# EAGLE design Tractive System Board Rev9 (EAGLE 9.6.2)

## Sheet 1 of 3
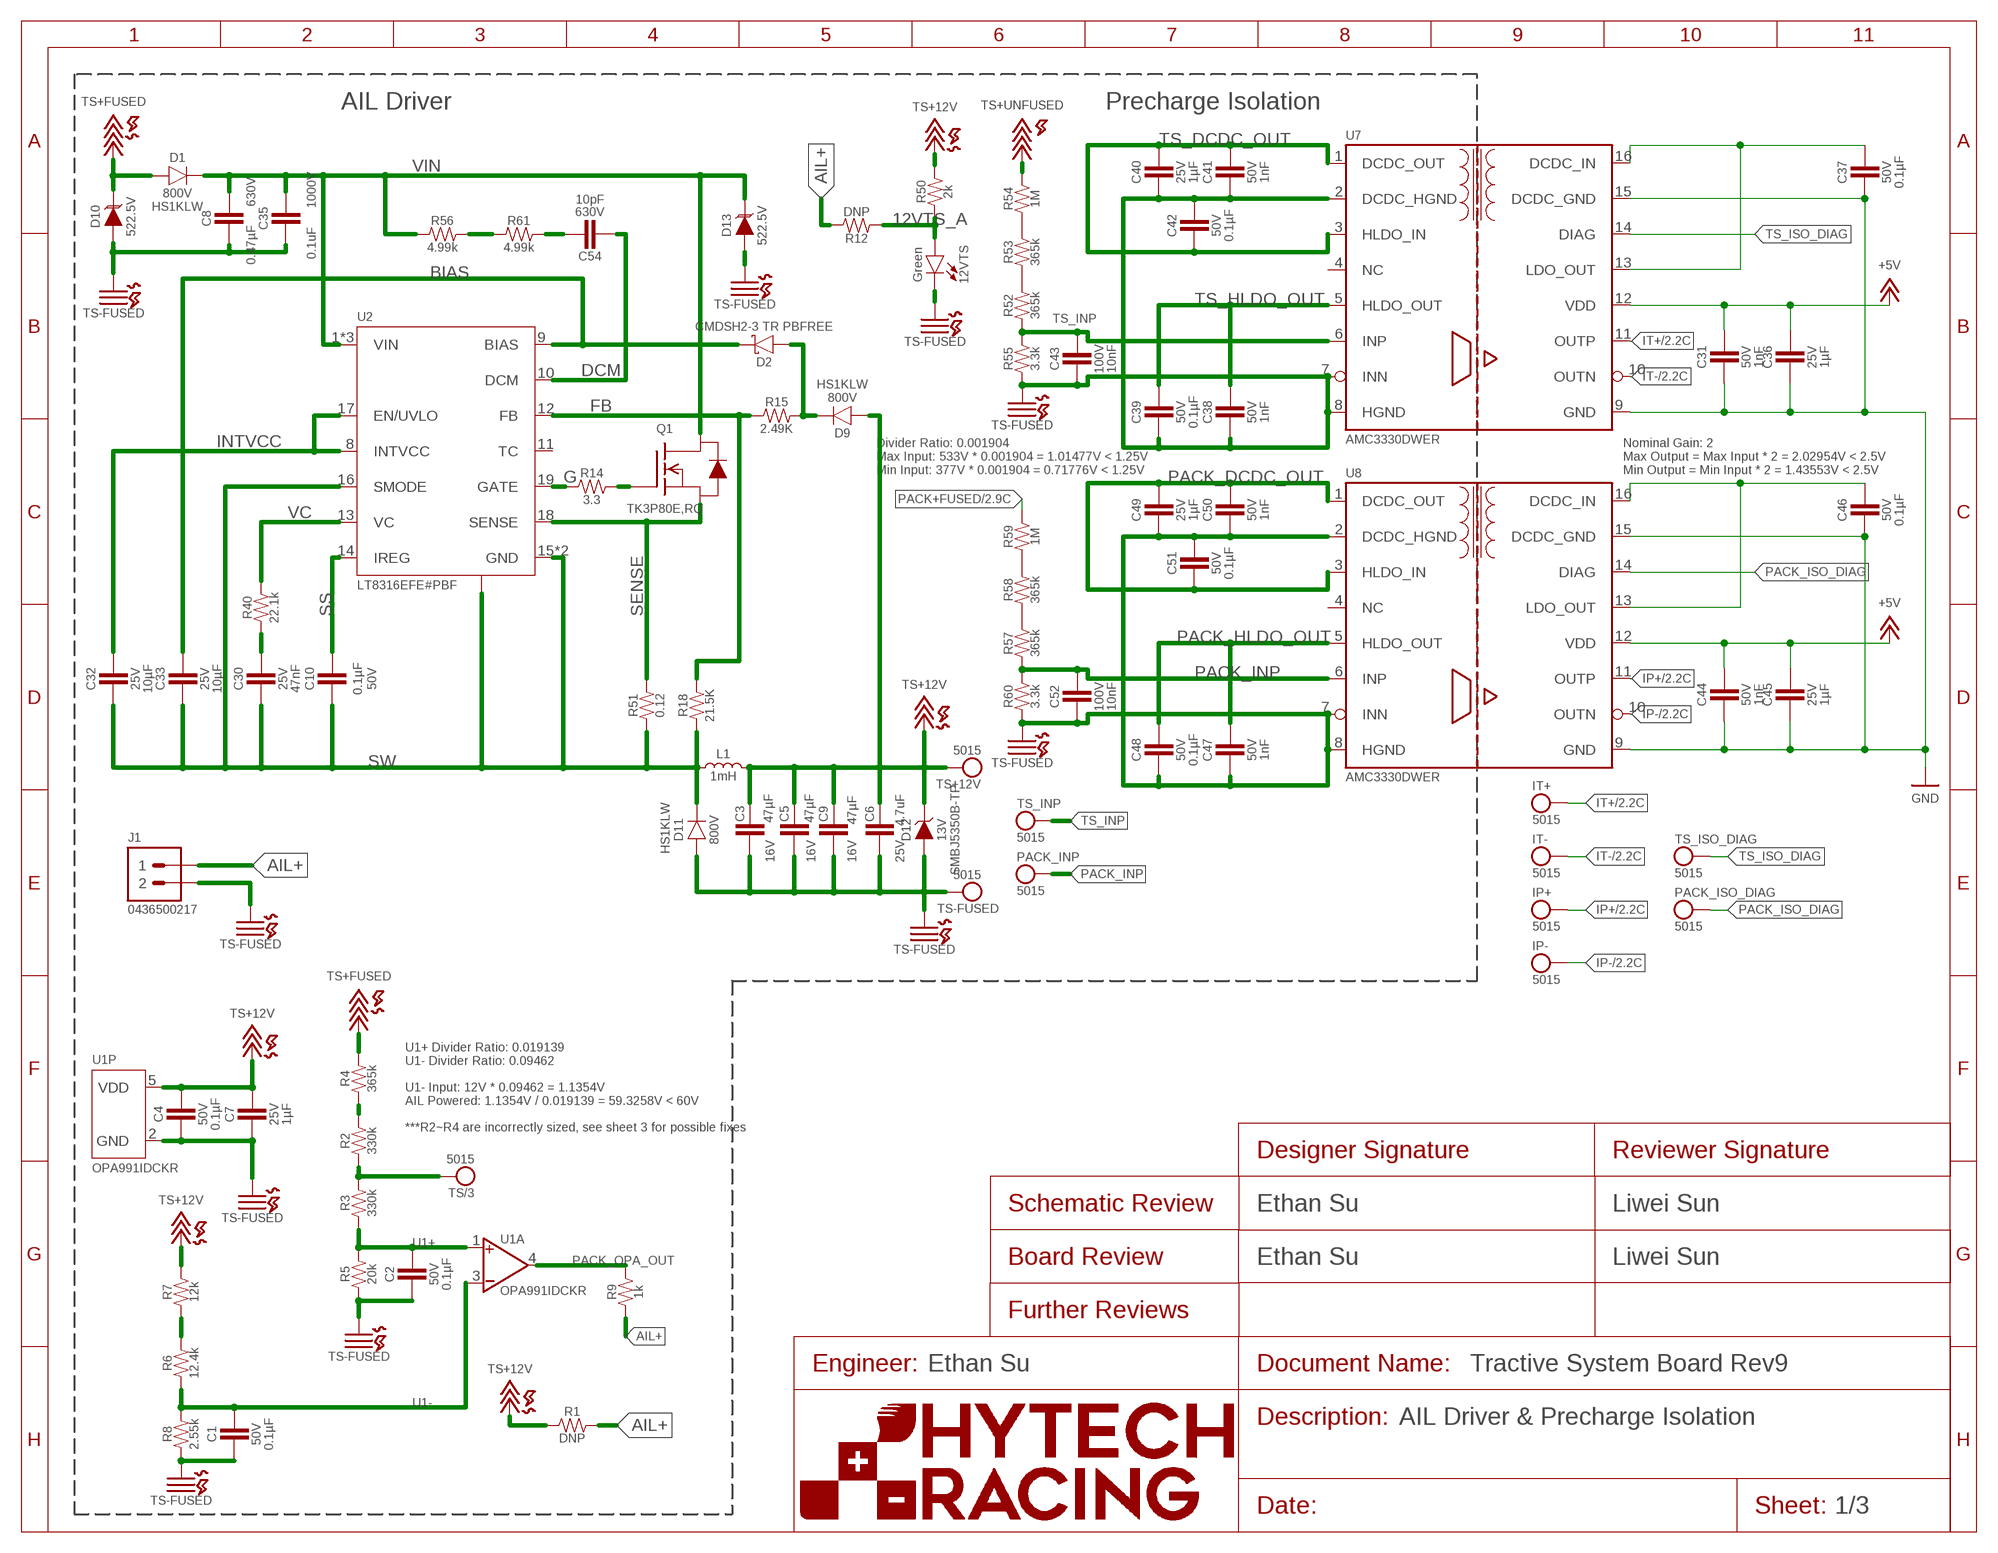
[diagram p0: schematic, sheet 1]
FRAME1 (FRAME): DESCRIPTION_1: AIL Driver & Precharge Isolation; DESIGNER_BOARD: Ethan Su; DESIGNER_SCHEMATIC: Ethan Su; ENGINEER: Ethan Su; REVIEWER_BOARD: Liwei Sun; REVIEWER_SCHEMATIC: Liwei Sun

### Parts
12VTS  LED_0603_GREEN  [0603-LED]
C1  CAPACITOR_0603_50V_0.1UF  [0603-CAP]
C2  CAPACITOR_0603_50V_0.1UF  [0603-CAP]
C3  CAPACITOR_1206_16V_47UF  [1206-CAP]
C4  CAPACITOR_0603_50V_0.1UF  [0603-CAP]
C5  CAPACITOR_1206_16V_47UF  [1206-CAP]
C6  CAPACITOR_0603_25V_4.7UF  [0603-CAP]
C7  CAPACITOR_0603_25V_1UF  [0603-CAP]
C8  CAPACITOR_2220_630V_0.47UF  [2220-CAP]
C9  CAPACITOR_1206_16V_47UF  [1206-CAP]
C10  CAPACITOR_0603_50V_0.1UF  [0603-CAP]
C30  CAPACITOR_0603_25V_47NF  [0603-CAP]
C31  CAPACITOR_1206_50V_1NF  [1206-CAP]
C32  CAPACITOR_0603_25V_10UF  [0603-CAP]
C33  CAPACITOR_0603_25V_10UF  [0603-CAP]
C35  CAPACITOR_1812_1000V_0.1UF  [1812-CAP]
C36  CAPACITOR_1206_25V_1UF  [1206-CAP]
C37  CAPACITOR_0603_50V_0.1UF  [0603-CAP]
C38  CAPACITOR_1206_50V_1NF  [1206-CAP]
C39  CAPACITOR_1206_50V_0.1UF  [1206-CAP]
C40  CAPACITOR_0603_25V_1UF  [0603-CAP]
C41  CAPACITOR_0603_50V_1NF  [0603-CAP]
C42  CAPACITOR_0603_50V_0.1UF  [0603-CAP]
C43  CAPACITOR_0603_100V_10NF  [0603-CAP]
C44  CAPACITOR_1206_50V_1NF  [1206-CAP]
C45  CAPACITOR_1206_25V_1UF  [1206-CAP]
C46  CAPACITOR_0603_50V_0.1UF  [0603-CAP]
C47  CAPACITOR_1206_50V_1NF  [1206-CAP]
C48  CAPACITOR_1206_50V_0.1UF  [1206-CAP]
C49  CAPACITOR_0603_25V_1UF  [0603-CAP]
C50  CAPACITOR_0603_50V_1NF  [0603-CAP]
C51  CAPACITOR_0603_50V_0.1UF  [0603-CAP]
C52  CAPACITOR_0603_100V_10NF  [0603-CAP]
C54  CAPACITOR_1206_630V_10PF  [1206-CAP]
D1  RECTIFIER_800V_ACTIVE_SOD-123W  [SOD-123W]
D2  SCHOTTKY_SOD323_30VV  [SOD-323]
D9  RECTIFIER_800V_ACTIVE_SOD-123W  [SOD-123W]
D10  TVS_TPSMB_522.5  [SMB(DO-214AA)]
D11  RECTIFIER_800V_ACTIVE_SOD-123W  [SOD-123W]
D12  ZENER_SMB(DO-214AA)_13V  [SMB(DO-214AA)]
D13  TVS_TPSMB_522.5  [SMB(DO-214AA)]
IP+  TEST_POINT  [5015]
IP-  TEST_POINT  [5015]
IT+  TEST_POINT  [5015]
IT-  TEST_POINT  [5015]
J1  CONNECTOR-2_MICROFIT_PTH_VERTICAL_02_SINGLE_  [MOLEX_MICROFIT_PTH_VERTICAL_02_SINGLE]
L1  INDUCTOR_CDEEH13D90-102LC_1MH  [CDEEH13D90]
PACK_INP  TEST_POINT  [5015]
PACK_ISO_DIAG  TEST_POINT  [5015]
Q1  TRANSISTOR_N_MOS_2-7K1S_TK3P80E  [DPAK(2-7K1S)]
R1  RESISTOR_0603_DNP  [0603-RES]
R2  RESISTOR_0603_330K  [0603-RES]
R3  RESISTOR_0603_330K  [0603-RES]
R4  RESISTOR_0805_365K  [0805-RES]
R5  RESISTOR_0603_20K  [0603-RES]
R6  RESISTOR_0603_12.4K  [0603-RES]
R7  RESISTOR_0603_12K  [0603-RES]
R8  RESISTOR_0603_2.55K  [0603-RES]
R9  RESISTOR_0603_1K  [0603-RES]
R12  RESISTOR_0603_DNP  [0603-RES]
R14  RESISTOR_0603_3.3  [0603-RES]
R15  RESISTOR_0603_2.49K  [0603-RES]
R18  RESISTOR_0603_21.5K  [0603-RES]
R40  RESISTOR_0603_22.1K  [0603-RES]
R50  RESISTOR_0603_2K  [0603-RES]
R51  RESISTOR_0603_0.12  [0603-RES]
R52  RESISTOR_0805_HV365K  [0805-RES]
R53  RESISTOR_0805_HV365K  [0805-RES]
R54  RESISTOR_0805_HV1M  [0805-RES]
R55  RESISTOR_0603_HV3.3K  [0603-RES]
R56  RESISTOR_1206_HV4.99K  [1206-RES]
R57  RESISTOR_0805_HV365K  [0805-RES]
R58  RESISTOR_0805_HV365K  [0805-RES]
R59  RESISTOR_0805_HV1M  [0805-RES]
R60  RESISTOR_0603_HV3.3K  [0603-RES]
R61  RESISTOR_1206_HV4.99K  [1206-RES]
TS+12V  TEST_POINT  [5015]
TS-FUSED  TEST_POINT  [5015]
TS/3  TEST_POINT  [5015]
TS_INP  TEST_POINT  [5015]
TS_ISO_DIAG  TEST_POINT  [5015]
U1  OPAMP_1_CHANNEL_OPA991  [SC-70-5]
U2  LT8316  [TSSOP-20(16)]
U7  AMC3330_AIRGAP  [SOIC-16W-AIRGAP]
U8  AMC3330_AIRGAP  [SOIC-16W-AIRGAP]

### Nets
12VTS_A: 12VTS.2(A) R12.1 R50.1
+5V: C31.1 C36.1 C44.1 C45.1 U7.12(VDD) U8.12(VDD) ; also sheet 2
AIL+: J1.1 R1.2 R9.1 R12.2
BIAS: C33.1 D2.C U2.9(BIAS)
DCM: C54.2 U2.10(DCM)
FB: R15.1 R18.2 U2.12(FB)
G: R14.1 U2.19(GATE)
GND: C31.2 C36.2 C37.2 C44.2 C45.2 C46.2 U7.9(GND) U7.15(DCDC_GND) U8.9(GND) U8.15(DCDC_GND) ; also sheet 2
INTVCC: C32.1 U2.8(INTVCC) U2.17(EN/UVLO)
IP+: IP+.1 U8.11(OUTP) ; also sheet 2
IP-: IP-.1 U8.10(OUTN) ; also sheet 2
IT+: IT+.1 U7.11(OUTP) ; also sheet 2
IT-: IT-.1 U7.10(OUTN) ; also sheet 2
N$1: Q1.1(G) R14.2
N$4: D2.A D9.C R15.2
N$5: R2.1 R3.2 TS/3.1
N$6: R2.2 R4.1
N$12: R6.2 R7.1
N$17: R56.2 R61.1
N$18: C54.1 R61.2
N$33: C37.1 U7.13(LDO_OUT) U7.16(DCDC_IN)
N$43: C30.1 R40.1
N$52: C46.1 U8.13(LDO_OUT) U8.16(DCDC_IN)
N$59: R52.2 R53.1
N$60: R53.2 R54.1
N$65: R57.2 R58.1
N$66: R58.2 R59.1
PACK+FUSED: R59.2 ; also sheet 2
PACK_DCDC_OUT: C49.1 C50.1 C51.2 U8.1(DCDC_OUT) U8.3(HLDO_IN)
PACK_HLDO_OUT: C47.1 C48.1 U8.5(HLDO_OUT)
PACK_INP: C52.1 PACK_INP.1 R57.1 R60.2 U8.6(INP)
PACK_ISO_DIAG: PACK_ISO_DIAG.1 U8.14(DIAG)
PACK_OPA_OUT: R9.2 U1.4(A:VOUT)
SENSE: Q1.3(S) R51.2 U2.18(SENSE)
SS: C10.1 U2.14(IREG)
SW: C10.2 C30.2 C32.2 C33.2 D11.C L1.1 R18.1 R51.1 U2.15(GND) U2.16(SMODE) U2.20(GND) U2.THERMAL
TS+12V: C3.1 C4.1 C5.1 C6.1 C7.1 C9.1 D9.A D12.C L1.2 R1.1 R7.2 R50.2 TS+12V.1 U1.5(P:VDD)
TS+FUSED: D1.A D10.C R4.2 ; also sheet 2
TS+UNFUSED: R54.2 ; also sheet 2
TS-FUSED: 12VTS.1(C) C1.2 C2.2 C3.2 C4.2 C5.2 C6.2 C7.2 C8.2 C9.2 C35.2 C38.2 C39.2 C40.2 C41.2 C42.1 C43.2 C47.2 C48.2 C49.2 C50.2 C51.1 C52.2 D10.A D11.A D12.A D13.A J1.2 R5.1 R8.1 R55.1 R60.1 TS-FUSED.1 U1.2(P:GND) U7.2(DCDC_HGND) U7.7(INN) U7.8(HGND) U8.2(DCDC_HGND) U8.7(INN) U8.8(HGND) ; also sheet 2
TS_DCDC_OUT: C40.1 C41.1 C42.2 U7.1(DCDC_OUT) U7.3(HLDO_IN)
TS_HLDO_OUT: C38.1 C39.1 U7.5(HLDO_OUT)
TS_INP: C43.1 R52.1 R55.2 TS_INP.1 U7.6(INP)
TS_ISO_DIAG: TS_ISO_DIAG.1 U7.14(DIAG)
U1+: C2.1 R3.1 R5.2 U1.1(A:VIN+)
U1-: C1.1 R6.1 R8.2 U1.3(A:VIN-)
VC: R40.2 U2.13(VC)
VIN: C8.1 C35.1 D1.C D13.C Q1.2(D) R56.1 U2.1(VIN) U2.2(VIN) U2.3(VIN)
Unconnected: U2.11(TC) U7.4(NC) U8.4(NC)

### Notes on the sheet
- AIL Driver | Precharge Isolation
- Divider Ratio: 0.001904
  Max Input: 533V * 0.001904 = 1.01477V < 1.25V
  Min Input: 377V * 0.001904 = 0.71776V < 1.25V
- Nominal Gain: 2
  Max Output = Max Input * 2 = 2.02954V < 2.5V
  Min Output = Min Input * 2 = 1.43553V < 2.5V
- U1+ Divider Ratio: 0.019139
  U1- Divider Ratio: 0.09462
  
  U1- Input: 12V * 0.09462 = 1.1354V 
  AIL Powered: 1.1354V / 0.019139 = 59.3258V < 60V
  
  ***R2~R4 are incorrectly sized, see sheet 3 for possible fixes

## Sheet 2 of 3
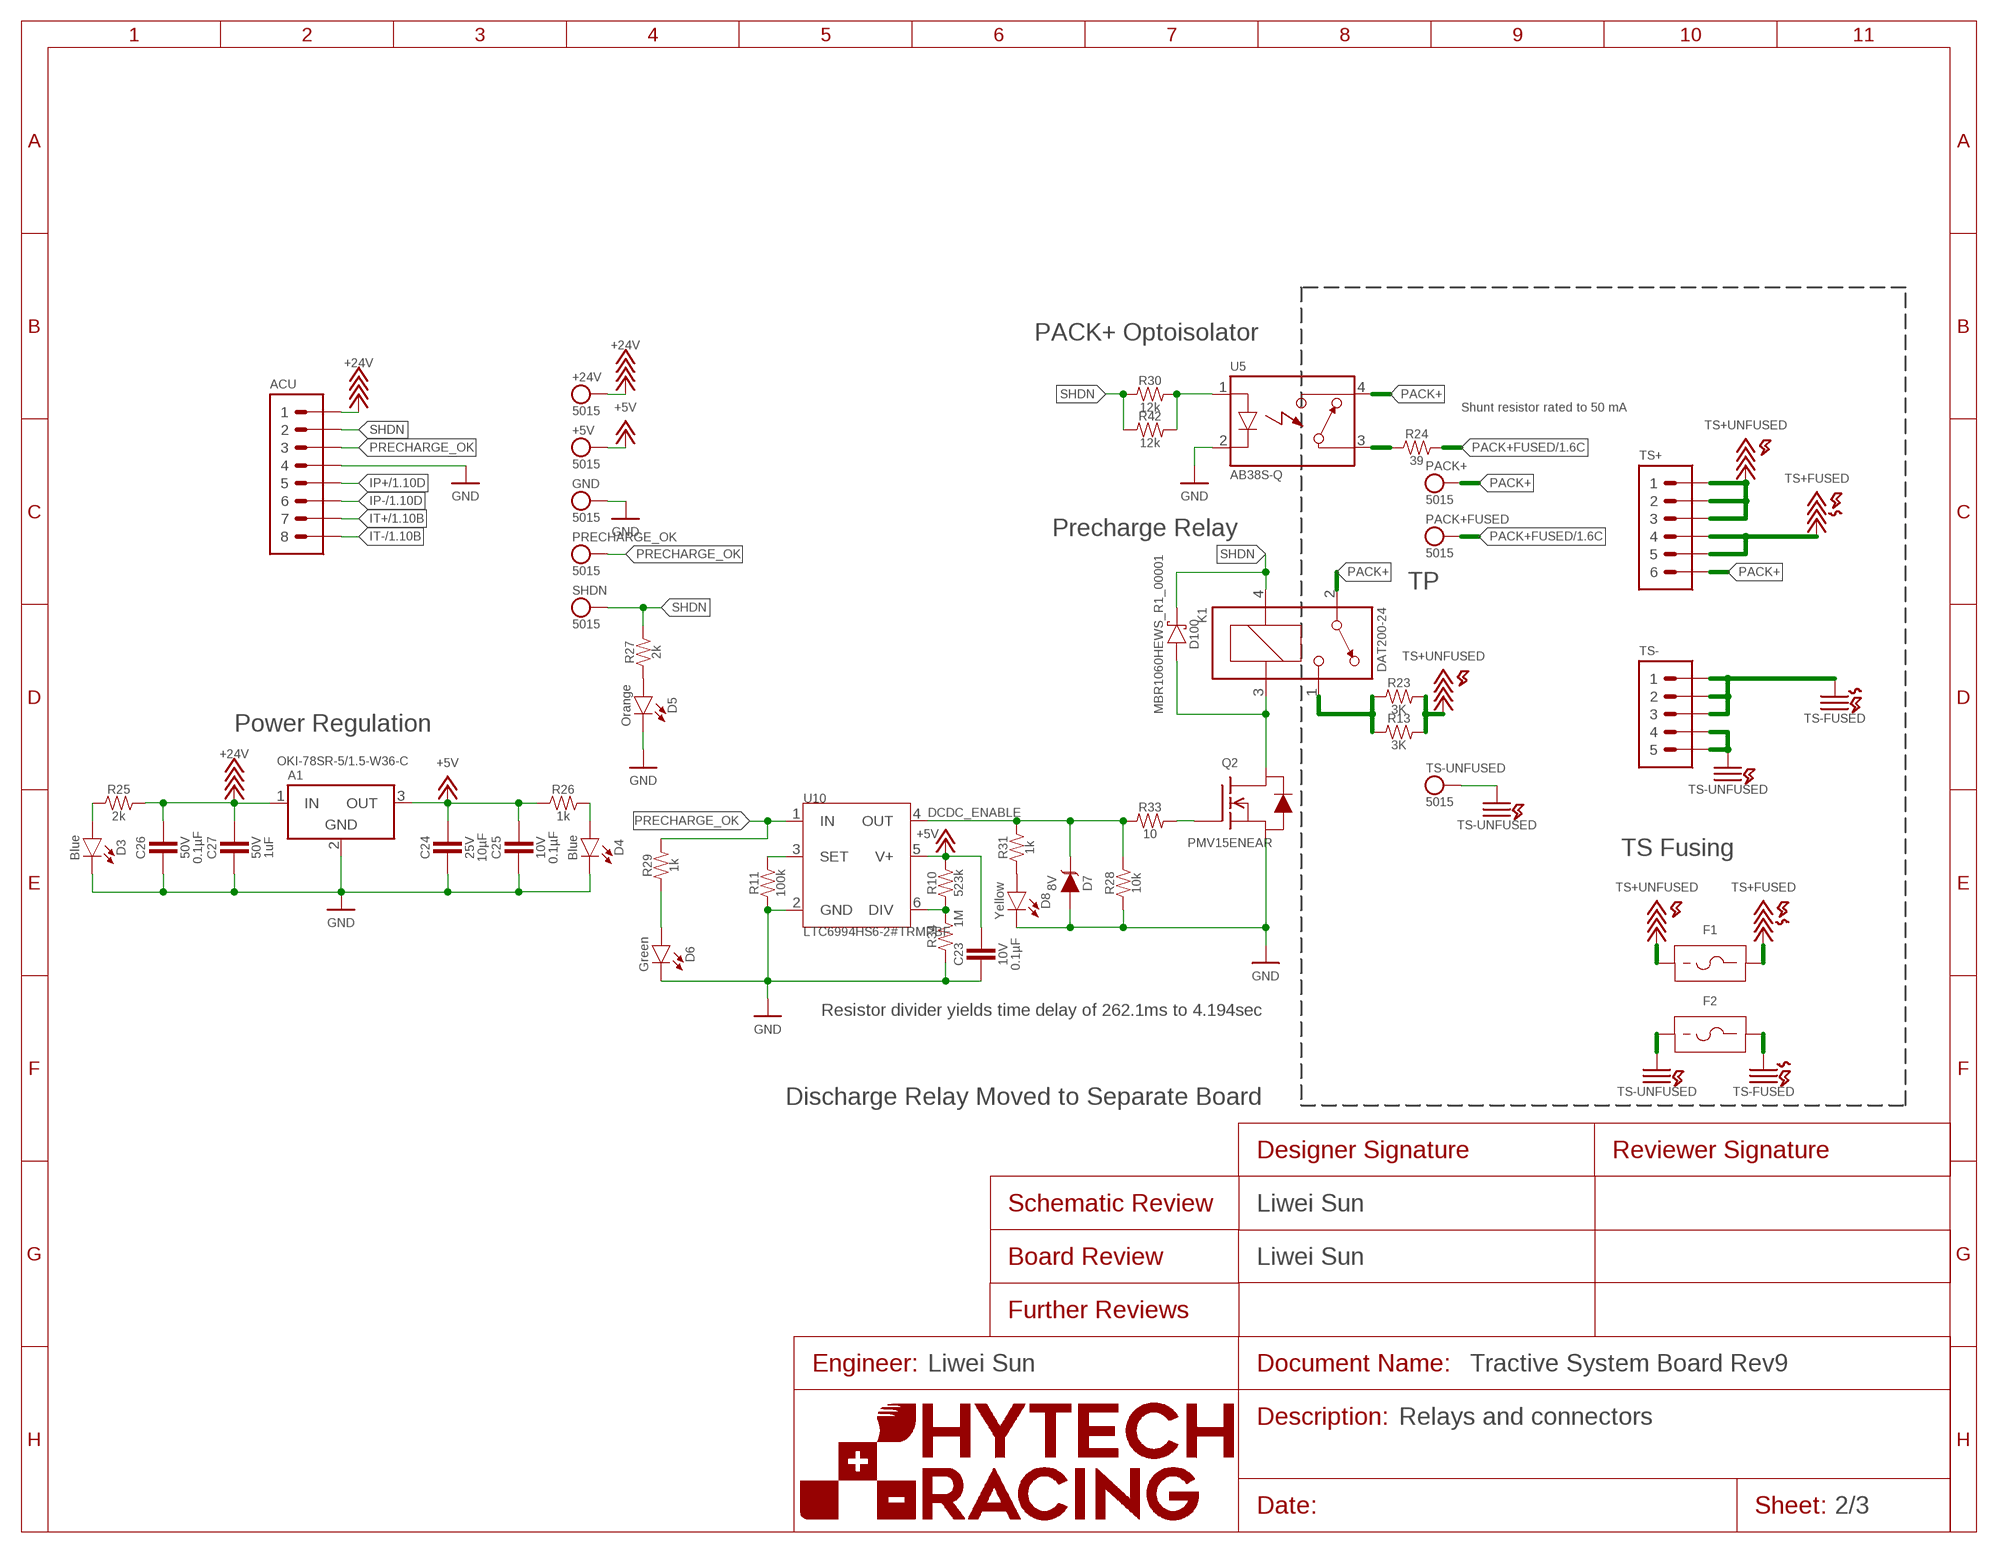
[diagram p1: schematic, sheet 2]
FRAME4 (FRAME): DESCRIPTION_1: Relays and connectors; DESIGNER_BOARD: Liwei Sun; DESIGNER_SCHEMATIC: Liwei Sun; ENGINEER: Liwei Sun

### Parts
+5V  TEST_POINT  [5015]
+24V  TEST_POINT  [5015]
A1  VOLTAGE_REGULATOR_MODULE_OKI-78SR_5V  [OKI-78SR]
ACU  CONNECTOR-8_μF_T_V_BLACK  [MOLEX_MICROFIT_PTH_VERTICAL_08_DUAL]
C23  CAPACITOR_0603_10V_0.1UF  [0603-CAP]
C24  CAPACITOR_0603_25V_10UF  [0603-CAP]
C25  CAPACITOR_0603_10V_0.1UF  [0603-CAP]
C26  CAPACITOR_0603_50V_0.1UF  [0603-CAP]
C27  CAPACITOR_0603_50V_1UF  [0603-CAP]
D3  LED_0603_BLUE  [0603-LED]
D4  LED_0603_BLUE  [0603-LED]
D5  LED_0603_ORANGE  [0603-LED]
D6  LED_0603_GREEN  [0603-LED]
D7  TVS__8V  [SOT-23]
D8  LED_0603_YELLOW  [0603-LED]
D100  SCHOTTKY_SOD323_60V  [SOD-323]
F1  FUSE_HOLDER_122  [122]
F2  FUSE_HOLDER_122  [122]
GND  TEST_POINT  [5015]
K1  RELAY_SPST_NO_D_200W_24  [D]
PACK+  TEST_POINT  [5015]
PACK+FUSED  TEST_POINT  [5015]
PRECHARGE_OK  TEST_POINT  [5015]
Q2  TRANSISTOR_N_MOS__PMV15ENEA  [SOT-23]
R10  RESISTOR_0805_523K  [0805-RES]
R11  RESISTOR_0603_100K_0.1%  [0603-RES]
R13  RESISTOR_B20-SHORTENED_1.5K  [B20-SHORTENED]
R23  3K  RESISTOR_B20-SHORTENED_1.5K  [B20-SHORTENED]
R24  RESISTOR_0603_39  [0603-RES]
R25  RESISTOR_0603_2K  [0603-RES]
R26  RESISTOR_0603_1K  [0603-RES]
R27  RESISTOR_0603_2K  [0603-RES]
R28  RESISTOR_0603_10K  [0603-RES]
R29  RESISTOR_0603_1K  [0603-RES]
R30  RESISTOR_0603_12K  [0603-RES]
R31  RESISTOR_0603_1K  [0603-RES]
R33  RESISTOR_0603_10  [0603-RES]
R34  RESISTOR_0805_1M  [0805-RES]
R42  RESISTOR_0603_12K  [0603-RES]
SHDN  TEST_POINT  [5015]
TS+  CONNECTOR-6_μF_S_V_TSB_  [MOLEX_MICROFIT_PTH_VERTICAL_08_SINGLE_SPACED_MODIFIED]
TS-  CONNECTOR-5_MICRO_V6S_  [MOLEX_MICROFIT_PTH_VERTICAL_06_SINGLE_SPACED]
TS-UNFUSED  TEST_POINT  [5015]
U5  RELAY_SOLIDSTATE_NO_AB38S-Q-AIRGAP  [SOP-04-AIRGAP]
U10  LTC6994-2  [SOT-23-6]

### Nets
+5V: +5V.1 A1.3(OUT) C23.1 C24.1 C25.1 R10.2 R26.1 U10.5(V+) ; also sheet 1
+24V: +24V.1 A1.1(IN) ACU.1 C26.1 C27.1 R25.2
DCDC_ENABLE: D7.3(C) R28.2 R31.2 R33.1 U10.4(OUT)
GND: A1.2(GND) ACU.4 C23.2 C24.2 C25.2 C26.2 C27.2 D3.1(C) D4.1(C) D5.1(C) D6.1(C) D7.1(A) D8.1(C) GND.1 Q2.2(S) R11.1 R28.1 R34.1 U5.2(CONTROL-) U10.2(GND) ; also sheet 1
IP+: ACU.5 ; also sheet 1
IP-: ACU.6 ; also sheet 1
IT+: ACU.7 ; also sheet 1
IT-: ACU.8 ; also sheet 1
N$2: D5.2(A) R27.1
N$3: Q2.1(G) R33.2
N$10: R11.2 U10.3(SET)
N$11: R10.1 R34.2 U10.6(DIV)
N$22: D6.2(A) R29.1
N$24: D8.2(A) R31.1
N$25: D3.2(A) R25.1
N$30: D4.2(A) R26.2
N$40: D100.A K1.3(COIL-) Q2.3(D)
N$50: K1.1(CONTACT2) R13.1 R23.1
N$53: R30.2 R42.2 U5.1(CONTROL+)
N$57: R24.1 U5.3(CONTACT1)
PACK+: K1.2(CONTACT1) PACK+.1 TS+.6 U5.4(CONTACT2)
PACK+FUSED: PACK+FUSED.1 R24.2 ; also sheet 1
PRECHARGE_OK: ACU.3 PRECHARGE_OK.1 R29.2 U10.1(IN)
SHDN: ACU.2 D100.C K1.4(COIL+) R27.2 R30.1 R42.1 SHDN.1
TS+FUSED: F1.3 F1.4 TS+.4 TS+.5 ; also sheet 1
TS+UNFUSED: F1.1 F1.2 R13.2 R23.2 TS+.1 TS+.2 TS+.3 ; also sheet 1
TS-FUSED: F2.3 F2.4 TS-.1 TS-.2 TS-.3 ; also sheet 1
TS-UNFUSED: F2.1 F2.2 TS-.4 TS-.5 TS-UNFUSED.1

### Notes on the sheet
- PACK+ Optoisolator
- Shunt resistor rated to 50 mA
- Precharge Relay
- TP
- Power Regulation
- TS Fusing
- Resistor divider yields time delay of 262.1ms to 4.194sec
- Discharge Relay Moved to Separate Board

## Sheet 3 of 3
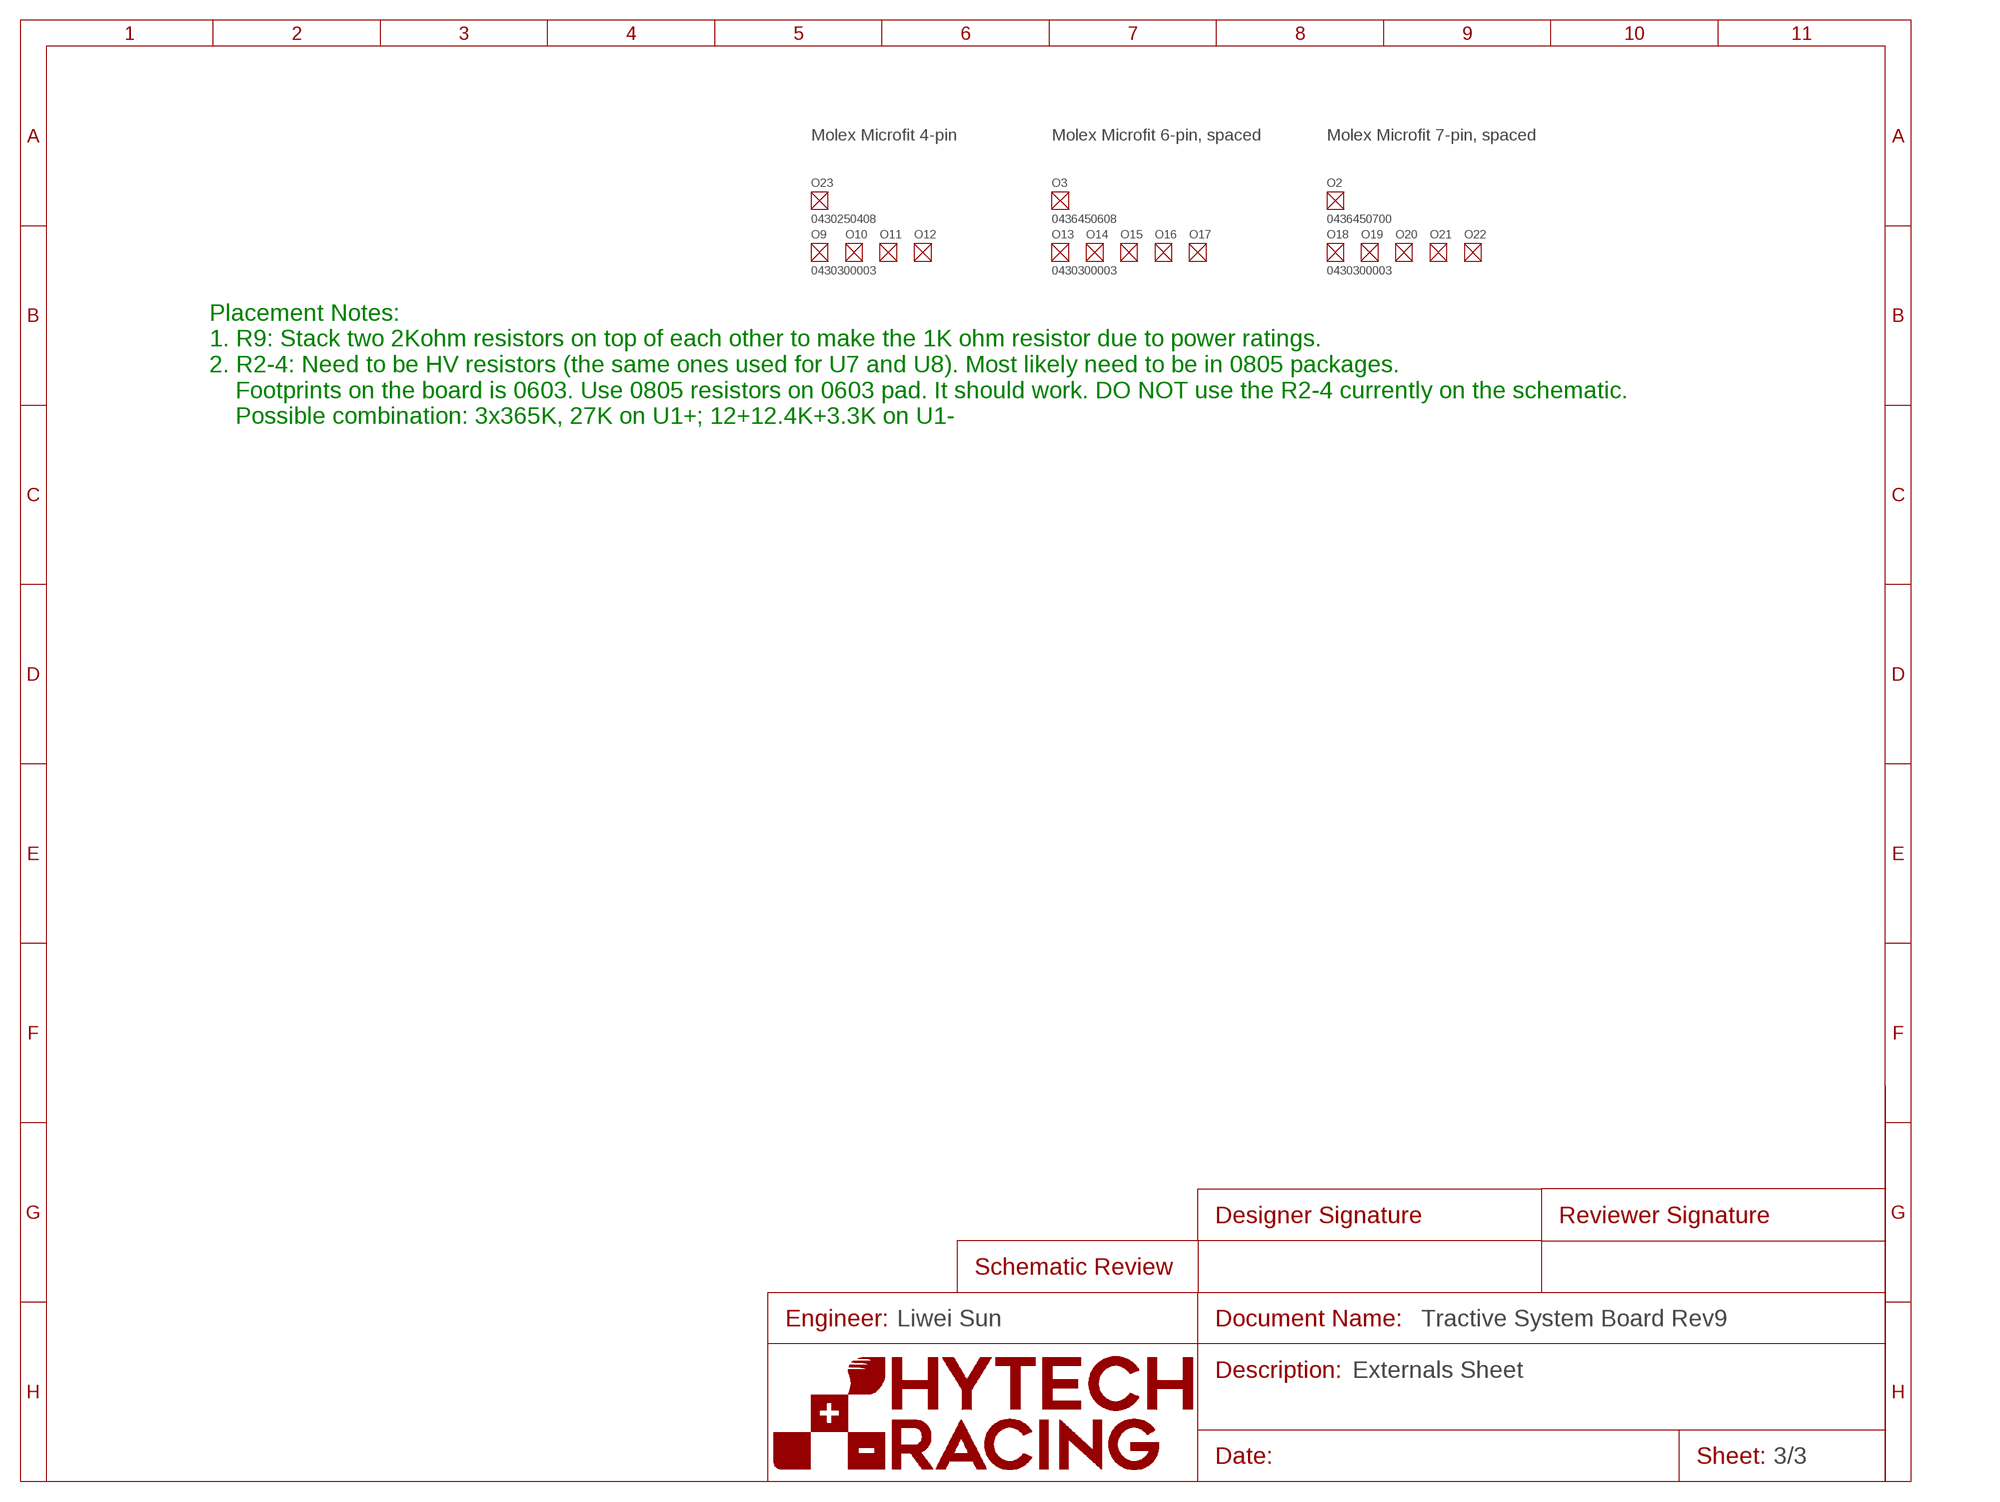
[diagram p2: schematic, sheet 3]
O2 (RECEPTACLE-7_MICROFIT): DKPN: WM2405-ND; MANUFACTURER: Molex; MOPN: 538-43645-0700; MPN: 0436450700
O3 (RECEPTACLE-6_SINGLE_MICROFIT): DKPN: WM13217-ND; MANUFACTURER: Molex; MOPN: 538-43645-0608; MPN: 0436450608
O9 (CRIMP_MICROFIT_20-24): DKPN: WM2776CT-ND; GAUGE: 20-24; MANUFACTURER: Molex; MOPN: 538-43030-0003; MPN: 0430300003
O10 (CRIMP_MICROFIT_20-24): DKPN: WM2776CT-ND; GAUGE: 20-24; MANUFACTURER: Molex; MOPN: 538-43030-0003; MPN: 0430300003
O11 (CRIMP_MICROFIT_20-24): DKPN: WM2776CT-ND; GAUGE: 20-24; MANUFACTURER: Molex; MOPN: 538-43030-0003; MPN: 0430300003
O12 (CRIMP_MICROFIT_20-24): DKPN: WM2776CT-ND; GAUGE: 20-24; MANUFACTURER: Molex; MOPN: 538-43030-0003; MPN: 0430300003
O13 (CRIMP_MICROFIT_20-24): DKPN: WM2776CT-ND; GAUGE: 20-24; MANUFACTURER: Molex; MOPN: 538-43030-0003; MPN: 0430300003
O14 (CRIMP_MICROFIT_20-24): DKPN: WM2776CT-ND; GAUGE: 20-24; MANUFACTURER: Molex; MOPN: 538-43030-0003; MPN: 0430300003
O15 (CRIMP_MICROFIT_20-24): DKPN: WM2776CT-ND; GAUGE: 20-24; MANUFACTURER: Molex; MOPN: 538-43030-0003; MPN: 0430300003
O16 (CRIMP_MICROFIT_20-24): DKPN: WM2776CT-ND; GAUGE: 20-24; MANUFACTURER: Molex; MOPN: 538-43030-0003; MPN: 0430300003
O17 (CRIMP_MICROFIT_20-24): DKPN: WM2776CT-ND; GAUGE: 20-24; MANUFACTURER: Molex; MOPN: 538-43030-0003; MPN: 0430300003
O18 (CRIMP_MICROFIT_20-24): DKPN: WM2776CT-ND; GAUGE: 20-24; MANUFACTURER: Molex; MOPN: 538-43030-0003; MPN: 0430300003
O19 (CRIMP_MICROFIT_20-24): DKPN: WM2776CT-ND; GAUGE: 20-24; MANUFACTURER: Molex; MOPN: 538-43030-0003; MPN: 0430300003
O20 (CRIMP_MICROFIT_20-24): DKPN: WM2776CT-ND; GAUGE: 20-24; MANUFACTURER: Molex; MOPN: 538-43030-0003; MPN: 0430300003
O21 (CRIMP_MICROFIT_20-24): DKPN: WM2776CT-ND; GAUGE: 20-24; MANUFACTURER: Molex; MOPN: 538-43030-0003; MPN: 0430300003
O22 (CRIMP_MICROFIT_20-24): DKPN: WM2776CT-ND; GAUGE: 20-24; MANUFACTURER: Molex; MOPN: 538-43030-0003; MPN: 0430300003
O23 (RECEPTACLE-4_MICROFIT): DKPN: WM11225-ND; MANUFACTURER: Molex; MOPN: 538-43025-0408; MPN: 0430250408
U$49 (FRAME_SCHEMATIC_ONLY): DESCRIPTION_1: Externals Sheet; ENGINEER: Liwei Sun

### Notes on the sheet
- Molex Microfit 4-pin | Molex Microfit 6-pin, spaced | Molex Microfit 7-pin, spaced
- Placement Notes:
  1. R9: Stack two 2Kohm resistors on top of each other to make the 1K ohm resistor due to power ratings.
  2. R2-4: Need to be HV resistors (the same ones used for U7 and U8). Most likely need to be in 0805 packages. 
      Footprints on the board is 0603. Use 0805 resistors on 0603 pad. It should work. DO NOT use the R2-4 currently on the schematic.
      Possible combination: 3x365K, 27K on U1+; 12+12.4K+3.3K on U1-

## Library data of the parts
12VTS D6 = HyTechDevices:LED_?_*: LED 0603 Blue <https://www.mouser.com/datasheet/2/216/APT1608VBC_D-246010.pdf> Green <https://www.mouser.com/datasheet/2/216/APT1608ZGCK-1173388.pdf> Orange <https://www.mouser.com/datasheet/2/216/APT1608SECK-6197.pdf> Red <https://www.mouser.com/datasheet/2/216/APT1608SECK-J3-PRV-1173336.pdf> White <https://www.mouser.com/datasheet/2/50/SM0603UWC-880813.pdf> Yellow <https://www.mouser.com/datasheet/2/216/APT1608SYCK-J3-PRV-1173311.pdf> 2835 (Series not on Digikey) Lumiled LUXEON 2835 Color Line <https://www.mouser.com/datasheet/2/602/DS236_luxeon_2835_color_line_datasheet-1596094.pdf>; COLOR: Green; DKPN: 754-1790-1-ND; MANUFACTURER: Kingbright; MOPN: 604-APT1608ZGCK; MPN: APT1608ZGCK
+5V +24V GND IP+ IP- IT+ IT- PACK+ PACK+FUSED PACK_INP PACK_ISO_DIAG PRECHARGE_OK SHDN TS+12V TS-FUSED TS-UNFUSED TS/3 TS_INP TS_ISO_DIAG = HyTechDevices:TEST_POINT: Test Point for Probing; DKPN: 36-5015CT-ND; MANUFACTURER: Keystone Electronics; MOPN: 534-5015; MPN: 5015
A1 = HyTechDevices:VOLTAGE_REGULATOR_MODULE_?_*: Voltage Regulator Modules OKI-78SR Datasheet <https://www.mouser.com/datasheet/2/281/oki-78sr-56393.pdf>; DKPN: 811-2196-5-ND; MANUFACTURER: Murata Power Solutions Inc.; MOPN: 580-OKI78SR5/1.5W36C; MPN: OKI-78SR-5/1.5-W36-C
ACU = HyTechDevices:CONNECTOR-8_?_*: 8 Pin Connector; DKPN: WM1798-ND; MANUFACTURER: Molex; MOPN: 538-43045-0814; MPN: 430450814
C1 C2 C4 C10 C26 C37 C42 C46 C51 = HyTechDevices:CAPACITOR_?_*: Capacitor, Non-Polarized VJ...1BC Series Datasheet <https://www.mouser.com/datasheet/2/427/vjw1bcbascomseries-1762447.pdf> Samsung Datasheet <https://www.mouser.com/datasheet/2/585/MLCC-1837944.pdf> Samsung Automotive MLCC Datasheet <https://www.mouser.com/datasheet/2/585/MLCC_Automotive-1837966.pdf> Walsin Datasheet <https://www.mouser.com/datasheet/2/210/WTC_MLCC_General_Purpose-1534899.pdf> GRM188R61A226ME15D <https://www.mouser.com/datasheet/2/281/1/GRM188R61A226ME15_02A-1985787.pdf> GRM188R61E106MA73D <https://www.mouser.com/datasheet/2/281/1/GRM188R61E106MA73_01A-1985806.pdf> GRM31CR61C476ME44K <https://search.murata.co.jp/Ceramy/image/img/A01X/G101/ENG/GRM31CR61C476ME44-01A.pdf> GRM31A5C2J100JW01D <https://www.digikey.com/en/products/detail/murata-electronics/GRM31A5C2J100JW01D/4358998?s=N4IgTCBcDaIOICUCyBmAjAQQKwGEwCk0AGI-AdSLQBEQBdAXyA> 885012006013 <https://www.mouser.com/datasheet/2/445/885012006013-1726946.pdf> 2220Y6300105KXTWS2 <https://www.mouser.com/datasheet/2/218/SMD_High_and_Std_StackiCap_P62-1825512.pdf> Yageo Class 2, X5R <https://www.mouser.com/datasheet/2/447/UPY_GPHC_X5R_4V_to_50V_26-1827097.pdf> TDK C Series <https://www.mouser.com/ProductDetail/TDK/C3216X5R1V226M160AC?qs=%2Fha2pyFadujbcx9jh7lYl%2F4NeMoXFhdc8AqVWNq4wW6M2y7zl6GzBuhgtI0ngznN> AVX Automotive MLCC <https://www.mouser.com/datasheet/2/40/AutoMLCC-777028.pdf> KEMET X7R Series <https://www.mouser.com/datasheet/2/212/KEM_C1002_X7R_SMD-1102033.pdf> Kyocera AVX <https://www.mouser.com/datasheet/2/40/C0GNP0_Dielectric-951274.pdf> GRM21BR61H <https://www.mouser.com/datasheet/2/281/1/GRM21BR61H106KE43_01A-1986884.pdf> C1812W104KDRACTU <https://www.mouser.com/datasheet/2/212/KEM_C1034_X7R_HV_ARC_SMD-1101730.pdf> CGA series - MLCC Automotive grade <https://product.tdk.com/system/files/dam/doc/product/capacitor/ceramic/mlcc/catalog/mlcc_automotive_general_en.pdf> TDK C Series Data Sheet <https://product.tdk.com/system/files/dam/doc/product/capacitor/ceramic/mlcc/catalog/mlcc_commercial_general_en.pdf> Kemet Datasheet <https://connect.kemet.com:7667/gateway/IntelliData-ComponentDocumentation/1.0/download/datasheet/C0603C220K3RACAUTO>; CAPACITANCE: 0.1µF; DKPN: 311-1344-1-ND; MANUFACTURER: Yageo; MOPN: 603-CC603KRX7R9BB104; MPN: CC0603KRX7R9BB104; TOLERANCE: 10%; VOLTAGE: 50V
C3 C5 C9 = HyTechDevices:CAPACITOR_?_*: Capacitor, Non-Polarized VJ...1BC Series Datasheet <https://www.mouser.com/datasheet/2/427/vjw1bcbascomseries-1762447.pdf> Samsung Datasheet <https://www.mouser.com/datasheet/2/585/MLCC-1837944.pdf> Samsung Automotive MLCC Datasheet <https://www.mouser.com/datasheet/2/585/MLCC_Automotive-1837966.pdf> Walsin Datasheet <https://www.mouser.com/datasheet/2/210/WTC_MLCC_General_Purpose-1534899.pdf> GRM188R61A226ME15D <https://www.mouser.com/datasheet/2/281/1/GRM188R61A226ME15_02A-1985787.pdf> GRM188R61E106MA73D <https://www.mouser.com/datasheet/2/281/1/GRM188R61E106MA73_01A-1985806.pdf> GRM31CR61C476ME44K <https://search.murata.co.jp/Ceramy/image/img/A01X/G101/ENG/GRM31CR61C476ME44-01A.pdf> GRM31A5C2J100JW01D <https://www.digikey.com/en/products/detail/murata-electronics/GRM31A5C2J100JW01D/4358998?s=N4IgTCBcDaIOICUCyBmAjAQQKwGEwCk0AGI-AdSLQBEQBdAXyA> 885012006013 <https://www.mouser.com/datasheet/2/445/885012006013-1726946.pdf> 2220Y6300105KXTWS2 <https://www.mouser.com/datasheet/2/218/SMD_High_and_Std_StackiCap_P62-1825512.pdf> Yageo Class 2, X5R <https://www.mouser.com/datasheet/2/447/UPY_GPHC_X5R_4V_to_50V_26-1827097.pdf> TDK C Series <https://www.mouser.com/ProductDetail/TDK/C3216X5R1V226M160AC?qs=%2Fha2pyFadujbcx9jh7lYl%2F4NeMoXFhdc8AqVWNq4wW6M2y7zl6GzBuhgtI0ngznN> AVX Automotive MLCC <https://www.mouser.com/datasheet/2/40/AutoMLCC-777028.pdf> KEMET X7R Series <https://www.mouser.com/datasheet/2/212/KEM_C1002_X7R_SMD-1102033.pdf> Kyocera AVX <https://www.mouser.com/datasheet/2/40/C0GNP0_Dielectric-951274.pdf> GRM21BR61H <https://www.mouser.com/datasheet/2/281/1/GRM21BR61H106KE43_01A-1986884.pdf> C1812W104KDRACTU <https://www.mouser.com/datasheet/2/212/KEM_C1034_X7R_HV_ARC_SMD-1101730.pdf> CGA series - MLCC Automotive grade <https://product.tdk.com/system/files/dam/doc/product/capacitor/ceramic/mlcc/catalog/mlcc_automotive_general_en.pdf> TDK C Series Data Sheet <https://product.tdk.com/system/files/dam/doc/product/capacitor/ceramic/mlcc/catalog/mlcc_commercial_general_en.pdf> Kemet Datasheet <https://connect.kemet.com:7667/gateway/IntelliData-ComponentDocumentation/1.0/download/datasheet/C0603C220K3RACAUTO>; CAPACITANCE: 47µF; DKPN: 490-GRM31CR61C476ME44KTR-ND; MANUFACTURER: Murata Electronics; MOPN: 81-GRM31CR61C476ME4K; MPN: GRM31CR61C476ME44K; TOLERANCE: 20%; VOLTAGE: 16V
C6 = HyTechDevices:CAPACITOR_?_*: Capacitor, Non-Polarized VJ...1BC Series Datasheet <https://www.mouser.com/datasheet/2/427/vjw1bcbascomseries-1762447.pdf> Samsung Datasheet <https://www.mouser.com/datasheet/2/585/MLCC-1837944.pdf> Samsung Automotive MLCC Datasheet <https://www.mouser.com/datasheet/2/585/MLCC_Automotive-1837966.pdf> Walsin Datasheet <https://www.mouser.com/datasheet/2/210/WTC_MLCC_General_Purpose-1534899.pdf> GRM188R61A226ME15D <https://www.mouser.com/datasheet/2/281/1/GRM188R61A226ME15_02A-1985787.pdf> GRM188R61E106MA73D <https://www.mouser.com/datasheet/2/281/1/GRM188R61E106MA73_01A-1985806.pdf> GRM31CR61C476ME44K <https://search.murata.co.jp/Ceramy/image/img/A01X/G101/ENG/GRM31CR61C476ME44-01A.pdf> GRM31A5C2J100JW01D <https://www.digikey.com/en/products/detail/murata-electronics/GRM31A5C2J100JW01D/4358998?s=N4IgTCBcDaIOICUCyBmAjAQQKwGEwCk0AGI-AdSLQBEQBdAXyA> 885012006013 <https://www.mouser.com/datasheet/2/445/885012006013-1726946.pdf> 2220Y6300105KXTWS2 <https://www.mouser.com/datasheet/2/218/SMD_High_and_Std_StackiCap_P62-1825512.pdf> Yageo Class 2, X5R <https://www.mouser.com/datasheet/2/447/UPY_GPHC_X5R_4V_to_50V_26-1827097.pdf> TDK C Series <https://www.mouser.com/ProductDetail/TDK/C3216X5R1V226M160AC?qs=%2Fha2pyFadujbcx9jh7lYl%2F4NeMoXFhdc8AqVWNq4wW6M2y7zl6GzBuhgtI0ngznN> AVX Automotive MLCC <https://www.mouser.com/datasheet/2/40/AutoMLCC-777028.pdf> KEMET X7R Series <https://www.mouser.com/datasheet/2/212/KEM_C1002_X7R_SMD-1102033.pdf> Kyocera AVX <https://www.mouser.com/datasheet/2/40/C0GNP0_Dielectric-951274.pdf> GRM21BR61H <https://www.mouser.com/datasheet/2/281/1/GRM21BR61H106KE43_01A-1986884.pdf> C1812W104KDRACTU <https://www.mouser.com/datasheet/2/212/KEM_C1034_X7R_HV_ARC_SMD-1101730.pdf> CGA series - MLCC Automotive grade <https://product.tdk.com/system/files/dam/doc/product/capacitor/ceramic/mlcc/catalog/mlcc_automotive_general_en.pdf> TDK C Series Data Sheet <https://product.tdk.com/system/files/dam/doc/product/capacitor/ceramic/mlcc/catalog/mlcc_commercial_general_en.pdf> Kemet Datasheet <https://connect.kemet.com:7667/gateway/IntelliData-ComponentDocumentation/1.0/download/datasheet/C0603C220K3RACAUTO>; CAPACITANCE: 4.7uF; DKPN: 445-9050-1-ND; MANUFACTURER: TDK Corporation; MOPN: 810-C1608X5R1E475K; MPN: C1608X5R1E475K080AC; TOLERANCE: 10%; VOLTAGE: 25V
C7 C40 C49 = HyTechDevices:CAPACITOR_?_*: Capacitor, Non-Polarized VJ...1BC Series Datasheet <https://www.mouser.com/datasheet/2/427/vjw1bcbascomseries-1762447.pdf> Samsung Datasheet <https://www.mouser.com/datasheet/2/585/MLCC-1837944.pdf> Samsung Automotive MLCC Datasheet <https://www.mouser.com/datasheet/2/585/MLCC_Automotive-1837966.pdf> Walsin Datasheet <https://www.mouser.com/datasheet/2/210/WTC_MLCC_General_Purpose-1534899.pdf> GRM188R61A226ME15D <https://www.mouser.com/datasheet/2/281/1/GRM188R61A226ME15_02A-1985787.pdf> GRM188R61E106MA73D <https://www.mouser.com/datasheet/2/281/1/GRM188R61E106MA73_01A-1985806.pdf> GRM31CR61C476ME44K <https://search.murata.co.jp/Ceramy/image/img/A01X/G101/ENG/GRM31CR61C476ME44-01A.pdf> GRM31A5C2J100JW01D <https://www.digikey.com/en/products/detail/murata-electronics/GRM31A5C2J100JW01D/4358998?s=N4IgTCBcDaIOICUCyBmAjAQQKwGEwCk0AGI-AdSLQBEQBdAXyA> 885012006013 <https://www.mouser.com/datasheet/2/445/885012006013-1726946.pdf> 2220Y6300105KXTWS2 <https://www.mouser.com/datasheet/2/218/SMD_High_and_Std_StackiCap_P62-1825512.pdf> Yageo Class 2, X5R <https://www.mouser.com/datasheet/2/447/UPY_GPHC_X5R_4V_to_50V_26-1827097.pdf> TDK C Series <https://www.mouser.com/ProductDetail/TDK/C3216X5R1V226M160AC?qs=%2Fha2pyFadujbcx9jh7lYl%2F4NeMoXFhdc8AqVWNq4wW6M2y7zl6GzBuhgtI0ngznN> AVX Automotive MLCC <https://www.mouser.com/datasheet/2/40/AutoMLCC-777028.pdf> KEMET X7R Series <https://www.mouser.com/datasheet/2/212/KEM_C1002_X7R_SMD-1102033.pdf> Kyocera AVX <https://www.mouser.com/datasheet/2/40/C0GNP0_Dielectric-951274.pdf> GRM21BR61H <https://www.mouser.com/datasheet/2/281/1/GRM21BR61H106KE43_01A-1986884.pdf> C1812W104KDRACTU <https://www.mouser.com/datasheet/2/212/KEM_C1034_X7R_HV_ARC_SMD-1101730.pdf> CGA series - MLCC Automotive grade <https://product.tdk.com/system/files/dam/doc/product/capacitor/ceramic/mlcc/catalog/mlcc_automotive_general_en.pdf> TDK C Series Data Sheet <https://product.tdk.com/system/files/dam/doc/product/capacitor/ceramic/mlcc/catalog/mlcc_commercial_general_en.pdf> Kemet Datasheet <https://connect.kemet.com:7667/gateway/IntelliData-ComponentDocumentation/1.0/download/datasheet/C0603C220K3RACAUTO>; CAPACITANCE: 1µF; DKPN: 1276-1184-1-ND; MANUFACTURER: Samsung Electro-Mechanics; MOPN: 187-CL10B105KA8NNNC; MPN: CL10B105KA8NNNC; TOLERANCE: 10%; VOLTAGE: 25V
C8 = HyTechDevices:CAPACITOR_?_*: Capacitor, Non-Polarized VJ...1BC Series Datasheet <https://www.mouser.com/datasheet/2/427/vjw1bcbascomseries-1762447.pdf> Samsung Datasheet <https://www.mouser.com/datasheet/2/585/MLCC-1837944.pdf> Samsung Automotive MLCC Datasheet <https://www.mouser.com/datasheet/2/585/MLCC_Automotive-1837966.pdf> Walsin Datasheet <https://www.mouser.com/datasheet/2/210/WTC_MLCC_General_Purpose-1534899.pdf> GRM188R61A226ME15D <https://www.mouser.com/datasheet/2/281/1/GRM188R61A226ME15_02A-1985787.pdf> GRM188R61E106MA73D <https://www.mouser.com/datasheet/2/281/1/GRM188R61E106MA73_01A-1985806.pdf> GRM31CR61C476ME44K <https://search.murata.co.jp/Ceramy/image/img/A01X/G101/ENG/GRM31CR61C476ME44-01A.pdf> GRM31A5C2J100JW01D <https://www.digikey.com/en/products/detail/murata-electronics/GRM31A5C2J100JW01D/4358998?s=N4IgTCBcDaIOICUCyBmAjAQQKwGEwCk0AGI-AdSLQBEQBdAXyA> 885012006013 <https://www.mouser.com/datasheet/2/445/885012006013-1726946.pdf> 2220Y6300105KXTWS2 <https://www.mouser.com/datasheet/2/218/SMD_High_and_Std_StackiCap_P62-1825512.pdf> Yageo Class 2, X5R <https://www.mouser.com/datasheet/2/447/UPY_GPHC_X5R_4V_to_50V_26-1827097.pdf> TDK C Series <https://www.mouser.com/ProductDetail/TDK/C3216X5R1V226M160AC?qs=%2Fha2pyFadujbcx9jh7lYl%2F4NeMoXFhdc8AqVWNq4wW6M2y7zl6GzBuhgtI0ngznN> AVX Automotive MLCC <https://www.mouser.com/datasheet/2/40/AutoMLCC-777028.pdf> KEMET X7R Series <https://www.mouser.com/datasheet/2/212/KEM_C1002_X7R_SMD-1102033.pdf> Kyocera AVX <https://www.mouser.com/datasheet/2/40/C0GNP0_Dielectric-951274.pdf> GRM21BR61H <https://www.mouser.com/datasheet/2/281/1/GRM21BR61H106KE43_01A-1986884.pdf> C1812W104KDRACTU <https://www.mouser.com/datasheet/2/212/KEM_C1034_X7R_HV_ARC_SMD-1101730.pdf> CGA series - MLCC Automotive grade <https://product.tdk.com/system/files/dam/doc/product/capacitor/ceramic/mlcc/catalog/mlcc_automotive_general_en.pdf> TDK C Series Data Sheet <https://product.tdk.com/system/files/dam/doc/product/capacitor/ceramic/mlcc/catalog/mlcc_commercial_general_en.pdf> Kemet Datasheet <https://connect.kemet.com:7667/gateway/IntelliData-ComponentDocumentation/1.0/download/datasheet/C0603C220K3RACAUTO>; CAPACITANCE: 0.47µF; DKPN: 445-7779-1-ND; MANUFACTURER: TDK Corporation; MOPN: 810-C5750X7T2J474KKC; MPN: C5750X7T2J474K250KC; TOLERANCE: 10%; VOLTAGE: 630V
C23 C25 = HyTechDevices:CAPACITOR_?_*: Capacitor, Non-Polarized VJ...1BC Series Datasheet <https://www.mouser.com/datasheet/2/427/vjw1bcbascomseries-1762447.pdf> Samsung Datasheet <https://www.mouser.com/datasheet/2/585/MLCC-1837944.pdf> Samsung Automotive MLCC Datasheet <https://www.mouser.com/datasheet/2/585/MLCC_Automotive-1837966.pdf> Walsin Datasheet <https://www.mouser.com/datasheet/2/210/WTC_MLCC_General_Purpose-1534899.pdf> GRM188R61A226ME15D <https://www.mouser.com/datasheet/2/281/1/GRM188R61A226ME15_02A-1985787.pdf> GRM188R61E106MA73D <https://www.mouser.com/datasheet/2/281/1/GRM188R61E106MA73_01A-1985806.pdf> GRM31CR61C476ME44K <https://search.murata.co.jp/Ceramy/image/img/A01X/G101/ENG/GRM31CR61C476ME44-01A.pdf> GRM31A5C2J100JW01D <https://www.digikey.com/en/products/detail/murata-electronics/GRM31A5C2J100JW01D/4358998?s=N4IgTCBcDaIOICUCyBmAjAQQKwGEwCk0AGI-AdSLQBEQBdAXyA> 885012006013 <https://www.mouser.com/datasheet/2/445/885012006013-1726946.pdf> 2220Y6300105KXTWS2 <https://www.mouser.com/datasheet/2/218/SMD_High_and_Std_StackiCap_P62-1825512.pdf> Yageo Class 2, X5R <https://www.mouser.com/datasheet/2/447/UPY_GPHC_X5R_4V_to_50V_26-1827097.pdf> TDK C Series <https://www.mouser.com/ProductDetail/TDK/C3216X5R1V226M160AC?qs=%2Fha2pyFadujbcx9jh7lYl%2F4NeMoXFhdc8AqVWNq4wW6M2y7zl6GzBuhgtI0ngznN> AVX Automotive MLCC <https://www.mouser.com/datasheet/2/40/AutoMLCC-777028.pdf> KEMET X7R Series <https://www.mouser.com/datasheet/2/212/KEM_C1002_X7R_SMD-1102033.pdf> Kyocera AVX <https://www.mouser.com/datasheet/2/40/C0GNP0_Dielectric-951274.pdf> GRM21BR61H <https://www.mouser.com/datasheet/2/281/1/GRM21BR61H106KE43_01A-1986884.pdf> C1812W104KDRACTU <https://www.mouser.com/datasheet/2/212/KEM_C1034_X7R_HV_ARC_SMD-1101730.pdf> CGA series - MLCC Automotive grade <https://product.tdk.com/system/files/dam/doc/product/capacitor/ceramic/mlcc/catalog/mlcc_automotive_general_en.pdf> TDK C Series Data Sheet <https://product.tdk.com/system/files/dam/doc/product/capacitor/ceramic/mlcc/catalog/mlcc_commercial_general_en.pdf> Kemet Datasheet <https://connect.kemet.com:7667/gateway/IntelliData-ComponentDocumentation/1.0/download/datasheet/C0603C220K3RACAUTO>; CAPACITANCE: 0.1µF; DKPN: 720-1688-1-ND; MANUFACTURER: Vishay Vitramon; MOPN: 77-VJ0603Y104JXQPBC; MPN: VJ0603Y104JXQPW1BC; TOLERANCE: 5%; VOLTAGE: 10V
C24 C32 C33 = HyTechDevices:CAPACITOR_?_*: Capacitor, Non-Polarized VJ...1BC Series Datasheet <https://www.mouser.com/datasheet/2/427/vjw1bcbascomseries-1762447.pdf> Samsung Datasheet <https://www.mouser.com/datasheet/2/585/MLCC-1837944.pdf> Samsung Automotive MLCC Datasheet <https://www.mouser.com/datasheet/2/585/MLCC_Automotive-1837966.pdf> Walsin Datasheet <https://www.mouser.com/datasheet/2/210/WTC_MLCC_General_Purpose-1534899.pdf> GRM188R61A226ME15D <https://www.mouser.com/datasheet/2/281/1/GRM188R61A226ME15_02A-1985787.pdf> GRM188R61E106MA73D <https://www.mouser.com/datasheet/2/281/1/GRM188R61E106MA73_01A-1985806.pdf> GRM31CR61C476ME44K <https://search.murata.co.jp/Ceramy/image/img/A01X/G101/ENG/GRM31CR61C476ME44-01A.pdf> GRM31A5C2J100JW01D <https://www.digikey.com/en/products/detail/murata-electronics/GRM31A5C2J100JW01D/4358998?s=N4IgTCBcDaIOICUCyBmAjAQQKwGEwCk0AGI-AdSLQBEQBdAXyA> 885012006013 <https://www.mouser.com/datasheet/2/445/885012006013-1726946.pdf> 2220Y6300105KXTWS2 <https://www.mouser.com/datasheet/2/218/SMD_High_and_Std_StackiCap_P62-1825512.pdf> Yageo Class 2, X5R <https://www.mouser.com/datasheet/2/447/UPY_GPHC_X5R_4V_to_50V_26-1827097.pdf> TDK C Series <https://www.mouser.com/ProductDetail/TDK/C3216X5R1V226M160AC?qs=%2Fha2pyFadujbcx9jh7lYl%2F4NeMoXFhdc8AqVWNq4wW6M2y7zl6GzBuhgtI0ngznN> AVX Automotive MLCC <https://www.mouser.com/datasheet/2/40/AutoMLCC-777028.pdf> KEMET X7R Series <https://www.mouser.com/datasheet/2/212/KEM_C1002_X7R_SMD-1102033.pdf> Kyocera AVX <https://www.mouser.com/datasheet/2/40/C0GNP0_Dielectric-951274.pdf> GRM21BR61H <https://www.mouser.com/datasheet/2/281/1/GRM21BR61H106KE43_01A-1986884.pdf> C1812W104KDRACTU <https://www.mouser.com/datasheet/2/212/KEM_C1034_X7R_HV_ARC_SMD-1101730.pdf> CGA series - MLCC Automotive grade <https://product.tdk.com/system/files/dam/doc/product/capacitor/ceramic/mlcc/catalog/mlcc_automotive_general_en.pdf> TDK C Series Data Sheet <https://product.tdk.com/system/files/dam/doc/product/capacitor/ceramic/mlcc/catalog/mlcc_commercial_general_en.pdf> Kemet Datasheet <https://connect.kemet.com:7667/gateway/IntelliData-ComponentDocumentation/1.0/download/datasheet/C0603C220K3RACAUTO>; CAPACITANCE: 10µF; DKPN: 490-7202-1-ND; MANUFACTURER: Murata Electronics; MOPN: 81-GRM188R61E106MA3D; MPN: GRM188R61E106MA73D; TOLERANCE: 20%; VOLTAGE: 25V
C27 = HyTechDevices:CAPACITOR_?_*: Capacitor, Non-Polarized VJ...1BC Series Datasheet <https://www.mouser.com/datasheet/2/427/vjw1bcbascomseries-1762447.pdf> Samsung Datasheet <https://www.mouser.com/datasheet/2/585/MLCC-1837944.pdf> Samsung Automotive MLCC Datasheet <https://www.mouser.com/datasheet/2/585/MLCC_Automotive-1837966.pdf> Walsin Datasheet <https://www.mouser.com/datasheet/2/210/WTC_MLCC_General_Purpose-1534899.pdf> GRM188R61A226ME15D <https://www.mouser.com/datasheet/2/281/1/GRM188R61A226ME15_02A-1985787.pdf> GRM188R61E106MA73D <https://www.mouser.com/datasheet/2/281/1/GRM188R61E106MA73_01A-1985806.pdf> GRM31CR61C476ME44K <https://search.murata.co.jp/Ceramy/image/img/A01X/G101/ENG/GRM31CR61C476ME44-01A.pdf> GRM31A5C2J100JW01D <https://www.digikey.com/en/products/detail/murata-electronics/GRM31A5C2J100JW01D/4358998?s=N4IgTCBcDaIOICUCyBmAjAQQKwGEwCk0AGI-AdSLQBEQBdAXyA> 885012006013 <https://www.mouser.com/datasheet/2/445/885012006013-1726946.pdf> 2220Y6300105KXTWS2 <https://www.mouser.com/datasheet/2/218/SMD_High_and_Std_StackiCap_P62-1825512.pdf> Yageo Class 2, X5R <https://www.mouser.com/datasheet/2/447/UPY_GPHC_X5R_4V_to_50V_26-1827097.pdf> TDK C Series <https://www.mouser.com/ProductDetail/TDK/C3216X5R1V226M160AC?qs=%2Fha2pyFadujbcx9jh7lYl%2F4NeMoXFhdc8AqVWNq4wW6M2y7zl6GzBuhgtI0ngznN> AVX Automotive MLCC <https://www.mouser.com/datasheet/2/40/AutoMLCC-777028.pdf> KEMET X7R Series <https://www.mouser.com/datasheet/2/212/KEM_C1002_X7R_SMD-1102033.pdf> Kyocera AVX <https://www.mouser.com/datasheet/2/40/C0GNP0_Dielectric-951274.pdf> GRM21BR61H <https://www.mouser.com/datasheet/2/281/1/GRM21BR61H106KE43_01A-1986884.pdf> C1812W104KDRACTU <https://www.mouser.com/datasheet/2/212/KEM_C1034_X7R_HV_ARC_SMD-1101730.pdf> CGA series - MLCC Automotive grade <https://product.tdk.com/system/files/dam/doc/product/capacitor/ceramic/mlcc/catalog/mlcc_automotive_general_en.pdf> TDK C Series Data Sheet <https://product.tdk.com/system/files/dam/doc/product/capacitor/ceramic/mlcc/catalog/mlcc_commercial_general_en.pdf> Kemet Datasheet <https://connect.kemet.com:7667/gateway/IntelliData-ComponentDocumentation/1.0/download/datasheet/C0603C220K3RACAUTO>; CAPACITANCE: 1uF; DKPN: 587-2400-2-ND; MANUFACTURER: Taiyo Yuden; MOPN: 963-UMK107BJ105KA-T; MPN: UMK107BJ105KA-T; TOLERANCE: 10%; VOLTAGE: 50V
C30 = HyTechDevices:CAPACITOR_?_*: Capacitor, Non-Polarized VJ...1BC Series Datasheet <https://www.mouser.com/datasheet/2/427/vjw1bcbascomseries-1762447.pdf> Samsung Datasheet <https://www.mouser.com/datasheet/2/585/MLCC-1837944.pdf> Samsung Automotive MLCC Datasheet <https://www.mouser.com/datasheet/2/585/MLCC_Automotive-1837966.pdf> Walsin Datasheet <https://www.mouser.com/datasheet/2/210/WTC_MLCC_General_Purpose-1534899.pdf> GRM188R61A226ME15D <https://www.mouser.com/datasheet/2/281/1/GRM188R61A226ME15_02A-1985787.pdf> GRM188R61E106MA73D <https://www.mouser.com/datasheet/2/281/1/GRM188R61E106MA73_01A-1985806.pdf> GRM31CR61C476ME44K <https://search.murata.co.jp/Ceramy/image/img/A01X/G101/ENG/GRM31CR61C476ME44-01A.pdf> GRM31A5C2J100JW01D <https://www.digikey.com/en/products/detail/murata-electronics/GRM31A5C2J100JW01D/4358998?s=N4IgTCBcDaIOICUCyBmAjAQQKwGEwCk0AGI-AdSLQBEQBdAXyA> 885012006013 <https://www.mouser.com/datasheet/2/445/885012006013-1726946.pdf> 2220Y6300105KXTWS2 <https://www.mouser.com/datasheet/2/218/SMD_High_and_Std_StackiCap_P62-1825512.pdf> Yageo Class 2, X5R <https://www.mouser.com/datasheet/2/447/UPY_GPHC_X5R_4V_to_50V_26-1827097.pdf> TDK C Series <https://www.mouser.com/ProductDetail/TDK/C3216X5R1V226M160AC?qs=%2Fha2pyFadujbcx9jh7lYl%2F4NeMoXFhdc8AqVWNq4wW6M2y7zl6GzBuhgtI0ngznN> AVX Automotive MLCC <https://www.mouser.com/datasheet/2/40/AutoMLCC-777028.pdf> KEMET X7R Series <https://www.mouser.com/datasheet/2/212/KEM_C1002_X7R_SMD-1102033.pdf> Kyocera AVX <https://www.mouser.com/datasheet/2/40/C0GNP0_Dielectric-951274.pdf> GRM21BR61H <https://www.mouser.com/datasheet/2/281/1/GRM21BR61H106KE43_01A-1986884.pdf> C1812W104KDRACTU <https://www.mouser.com/datasheet/2/212/KEM_C1034_X7R_HV_ARC_SMD-1101730.pdf> CGA series - MLCC Automotive grade <https://product.tdk.com/system/files/dam/doc/product/capacitor/ceramic/mlcc/catalog/mlcc_automotive_general_en.pdf> TDK C Series Data Sheet <https://product.tdk.com/system/files/dam/doc/product/capacitor/ceramic/mlcc/catalog/mlcc_commercial_general_en.pdf> Kemet Datasheet <https://connect.kemet.com:7667/gateway/IntelliData-ComponentDocumentation/1.0/download/datasheet/C0603C220K3RACAUTO>; CAPACITANCE: 47nF; DKPN: 478-6340-1-ND; MANUFACTURER: Kyocera AVX; MOPN: 581-06033C473K42ZA; MPN: 06033C473K4Z2A; TOLERANCE: 10%; VOLTAGE: 25V
C31 C38 C44 C47 = HyTechDevices:CAPACITOR_?_*: Capacitor, Non-Polarized VJ...1BC Series Datasheet <https://www.mouser.com/datasheet/2/427/vjw1bcbascomseries-1762447.pdf> Samsung Datasheet <https://www.mouser.com/datasheet/2/585/MLCC-1837944.pdf> Samsung Automotive MLCC Datasheet <https://www.mouser.com/datasheet/2/585/MLCC_Automotive-1837966.pdf> Walsin Datasheet <https://www.mouser.com/datasheet/2/210/WTC_MLCC_General_Purpose-1534899.pdf> GRM188R61A226ME15D <https://www.mouser.com/datasheet/2/281/1/GRM188R61A226ME15_02A-1985787.pdf> GRM188R61E106MA73D <https://www.mouser.com/datasheet/2/281/1/GRM188R61E106MA73_01A-1985806.pdf> GRM31CR61C476ME44K <https://search.murata.co.jp/Ceramy/image/img/A01X/G101/ENG/GRM31CR61C476ME44-01A.pdf> GRM31A5C2J100JW01D <https://www.digikey.com/en/products/detail/murata-electronics/GRM31A5C2J100JW01D/4358998?s=N4IgTCBcDaIOICUCyBmAjAQQKwGEwCk0AGI-AdSLQBEQBdAXyA> 885012006013 <https://www.mouser.com/datasheet/2/445/885012006013-1726946.pdf> 2220Y6300105KXTWS2 <https://www.mouser.com/datasheet/2/218/SMD_High_and_Std_StackiCap_P62-1825512.pdf> Yageo Class 2, X5R <https://www.mouser.com/datasheet/2/447/UPY_GPHC_X5R_4V_to_50V_26-1827097.pdf> TDK C Series <https://www.mouser.com/ProductDetail/TDK/C3216X5R1V226M160AC?qs=%2Fha2pyFadujbcx9jh7lYl%2F4NeMoXFhdc8AqVWNq4wW6M2y7zl6GzBuhgtI0ngznN> AVX Automotive MLCC <https://www.mouser.com/datasheet/2/40/AutoMLCC-777028.pdf> KEMET X7R Series <https://www.mouser.com/datasheet/2/212/KEM_C1002_X7R_SMD-1102033.pdf> Kyocera AVX <https://www.mouser.com/datasheet/2/40/C0GNP0_Dielectric-951274.pdf> GRM21BR61H <https://www.mouser.com/datasheet/2/281/1/GRM21BR61H106KE43_01A-1986884.pdf> C1812W104KDRACTU <https://www.mouser.com/datasheet/2/212/KEM_C1034_X7R_HV_ARC_SMD-1101730.pdf> CGA series - MLCC Automotive grade <https://product.tdk.com/system/files/dam/doc/product/capacitor/ceramic/mlcc/catalog/mlcc_automotive_general_en.pdf> TDK C Series Data Sheet <https://product.tdk.com/system/files/dam/doc/product/capacitor/ceramic/mlcc/catalog/mlcc_commercial_general_en.pdf> Kemet Datasheet <https://connect.kemet.com:7667/gateway/IntelliData-ComponentDocumentation/1.0/download/datasheet/C0603C220K3RACAUTO>; CAPACITANCE: 1nF; DKPN: 478-KGM31BR71H102KTCT-ND; MANUFACTURER: KYOCERA AVX; MOPN: 581-12065C102K; MPN: KGM31BR71H102KT; TOLERANCE: 10%; VOLTAGE: 50V
C35 = HyTechDevices:CAPACITOR_?_*: Capacitor, Non-Polarized VJ...1BC Series Datasheet <https://www.mouser.com/datasheet/2/427/vjw1bcbascomseries-1762447.pdf> Samsung Datasheet <https://www.mouser.com/datasheet/2/585/MLCC-1837944.pdf> Samsung Automotive MLCC Datasheet <https://www.mouser.com/datasheet/2/585/MLCC_Automotive-1837966.pdf> Walsin Datasheet <https://www.mouser.com/datasheet/2/210/WTC_MLCC_General_Purpose-1534899.pdf> GRM188R61A226ME15D <https://www.mouser.com/datasheet/2/281/1/GRM188R61A226ME15_02A-1985787.pdf> GRM188R61E106MA73D <https://www.mouser.com/datasheet/2/281/1/GRM188R61E106MA73_01A-1985806.pdf> GRM31CR61C476ME44K <https://search.murata.co.jp/Ceramy/image/img/A01X/G101/ENG/GRM31CR61C476ME44-01A.pdf> GRM31A5C2J100JW01D <https://www.digikey.com/en/products/detail/murata-electronics/GRM31A5C2J100JW01D/4358998?s=N4IgTCBcDaIOICUCyBmAjAQQKwGEwCk0AGI-AdSLQBEQBdAXyA> 885012006013 <https://www.mouser.com/datasheet/2/445/885012006013-1726946.pdf> 2220Y6300105KXTWS2 <https://www.mouser.com/datasheet/2/218/SMD_High_and_Std_StackiCap_P62-1825512.pdf> Yageo Class 2, X5R <https://www.mouser.com/datasheet/2/447/UPY_GPHC_X5R_4V_to_50V_26-1827097.pdf> TDK C Series <https://www.mouser.com/ProductDetail/TDK/C3216X5R1V226M160AC?qs=%2Fha2pyFadujbcx9jh7lYl%2F4NeMoXFhdc8AqVWNq4wW6M2y7zl6GzBuhgtI0ngznN> AVX Automotive MLCC <https://www.mouser.com/datasheet/2/40/AutoMLCC-777028.pdf> KEMET X7R Series <https://www.mouser.com/datasheet/2/212/KEM_C1002_X7R_SMD-1102033.pdf> Kyocera AVX <https://www.mouser.com/datasheet/2/40/C0GNP0_Dielectric-951274.pdf> GRM21BR61H <https://www.mouser.com/datasheet/2/281/1/GRM21BR61H106KE43_01A-1986884.pdf> C1812W104KDRACTU <https://www.mouser.com/datasheet/2/212/KEM_C1034_X7R_HV_ARC_SMD-1101730.pdf> CGA series - MLCC Automotive grade <https://product.tdk.com/system/files/dam/doc/product/capacitor/ceramic/mlcc/catalog/mlcc_automotive_general_en.pdf> TDK C Series Data Sheet <https://product.tdk.com/system/files/dam/doc/product/capacitor/ceramic/mlcc/catalog/mlcc_commercial_general_en.pdf> Kemet Datasheet <https://connect.kemet.com:7667/gateway/IntelliData-ComponentDocumentation/1.0/download/datasheet/C0603C220K3RACAUTO>; CAPACITANCE: 0.1uF; DKPN: 399-C1812W104KDRAC7800CT-ND; MANUFACTURER: KEMET; MOPN: 80-C1812W104KDR; MPN: C1812W104KDRAC7800; TOLERANCE: 10%; VOLTAGE: 1000V
C36 C45 = HyTechDevices:CAPACITOR_?_*: Capacitor, Non-Polarized VJ...1BC Series Datasheet <https://www.mouser.com/datasheet/2/427/vjw1bcbascomseries-1762447.pdf> Samsung Datasheet <https://www.mouser.com/datasheet/2/585/MLCC-1837944.pdf> Samsung Automotive MLCC Datasheet <https://www.mouser.com/datasheet/2/585/MLCC_Automotive-1837966.pdf> Walsin Datasheet <https://www.mouser.com/datasheet/2/210/WTC_MLCC_General_Purpose-1534899.pdf> GRM188R61A226ME15D <https://www.mouser.com/datasheet/2/281/1/GRM188R61A226ME15_02A-1985787.pdf> GRM188R61E106MA73D <https://www.mouser.com/datasheet/2/281/1/GRM188R61E106MA73_01A-1985806.pdf> GRM31CR61C476ME44K <https://search.murata.co.jp/Ceramy/image/img/A01X/G101/ENG/GRM31CR61C476ME44-01A.pdf> GRM31A5C2J100JW01D <https://www.digikey.com/en/products/detail/murata-electronics/GRM31A5C2J100JW01D/4358998?s=N4IgTCBcDaIOICUCyBmAjAQQKwGEwCk0AGI-AdSLQBEQBdAXyA> 885012006013 <https://www.mouser.com/datasheet/2/445/885012006013-1726946.pdf> 2220Y6300105KXTWS2 <https://www.mouser.com/datasheet/2/218/SMD_High_and_Std_StackiCap_P62-1825512.pdf> Yageo Class 2, X5R <https://www.mouser.com/datasheet/2/447/UPY_GPHC_X5R_4V_to_50V_26-1827097.pdf> TDK C Series <https://www.mouser.com/ProductDetail/TDK/C3216X5R1V226M160AC?qs=%2Fha2pyFadujbcx9jh7lYl%2F4NeMoXFhdc8AqVWNq4wW6M2y7zl6GzBuhgtI0ngznN> AVX Automotive MLCC <https://www.mouser.com/datasheet/2/40/AutoMLCC-777028.pdf> KEMET X7R Series <https://www.mouser.com/datasheet/2/212/KEM_C1002_X7R_SMD-1102033.pdf> Kyocera AVX <https://www.mouser.com/datasheet/2/40/C0GNP0_Dielectric-951274.pdf> GRM21BR61H <https://www.mouser.com/datasheet/2/281/1/GRM21BR61H106KE43_01A-1986884.pdf> C1812W104KDRACTU <https://www.mouser.com/datasheet/2/212/KEM_C1034_X7R_HV_ARC_SMD-1101730.pdf> CGA series - MLCC Automotive grade <https://product.tdk.com/system/files/dam/doc/product/capacitor/ceramic/mlcc/catalog/mlcc_automotive_general_en.pdf> TDK C Series Data Sheet <https://product.tdk.com/system/files/dam/doc/product/capacitor/ceramic/mlcc/catalog/mlcc_commercial_general_en.pdf> Kemet Datasheet <https://connect.kemet.com:7667/gateway/IntelliData-ComponentDocumentation/1.0/download/datasheet/C0603C220K3RACAUTO>; CAPACITANCE: 1µF; DKPN: 478-KGM31HR71E105KUCT-ND; MANUFACTURER: KYOCERA AVX; MOPN: 581-12063C105K; MPN: KGM31HR71E105KU; TOLERANCE: 10%; VOLTAGE: 25V
C39 C48 = HyTechDevices:CAPACITOR_?_*: Capacitor, Non-Polarized VJ...1BC Series Datasheet <https://www.mouser.com/datasheet/2/427/vjw1bcbascomseries-1762447.pdf> Samsung Datasheet <https://www.mouser.com/datasheet/2/585/MLCC-1837944.pdf> Samsung Automotive MLCC Datasheet <https://www.mouser.com/datasheet/2/585/MLCC_Automotive-1837966.pdf> Walsin Datasheet <https://www.mouser.com/datasheet/2/210/WTC_MLCC_General_Purpose-1534899.pdf> GRM188R61A226ME15D <https://www.mouser.com/datasheet/2/281/1/GRM188R61A226ME15_02A-1985787.pdf> GRM188R61E106MA73D <https://www.mouser.com/datasheet/2/281/1/GRM188R61E106MA73_01A-1985806.pdf> GRM31CR61C476ME44K <https://search.murata.co.jp/Ceramy/image/img/A01X/G101/ENG/GRM31CR61C476ME44-01A.pdf> GRM31A5C2J100JW01D <https://www.digikey.com/en/products/detail/murata-electronics/GRM31A5C2J100JW01D/4358998?s=N4IgTCBcDaIOICUCyBmAjAQQKwGEwCk0AGI-AdSLQBEQBdAXyA> 885012006013 <https://www.mouser.com/datasheet/2/445/885012006013-1726946.pdf> 2220Y6300105KXTWS2 <https://www.mouser.com/datasheet/2/218/SMD_High_and_Std_StackiCap_P62-1825512.pdf> Yageo Class 2, X5R <https://www.mouser.com/datasheet/2/447/UPY_GPHC_X5R_4V_to_50V_26-1827097.pdf> TDK C Series <https://www.mouser.com/ProductDetail/TDK/C3216X5R1V226M160AC?qs=%2Fha2pyFadujbcx9jh7lYl%2F4NeMoXFhdc8AqVWNq4wW6M2y7zl6GzBuhgtI0ngznN> AVX Automotive MLCC <https://www.mouser.com/datasheet/2/40/AutoMLCC-777028.pdf> KEMET X7R Series <https://www.mouser.com/datasheet/2/212/KEM_C1002_X7R_SMD-1102033.pdf> Kyocera AVX <https://www.mouser.com/datasheet/2/40/C0GNP0_Dielectric-951274.pdf> GRM21BR61H <https://www.mouser.com/datasheet/2/281/1/GRM21BR61H106KE43_01A-1986884.pdf> C1812W104KDRACTU <https://www.mouser.com/datasheet/2/212/KEM_C1034_X7R_HV_ARC_SMD-1101730.pdf> CGA series - MLCC Automotive grade <https://product.tdk.com/system/files/dam/doc/product/capacitor/ceramic/mlcc/catalog/mlcc_automotive_general_en.pdf> TDK C Series Data Sheet <https://product.tdk.com/system/files/dam/doc/product/capacitor/ceramic/mlcc/catalog/mlcc_commercial_general_en.pdf> Kemet Datasheet <https://connect.kemet.com:7667/gateway/IntelliData-ComponentDocumentation/1.0/download/datasheet/C0603C220K3RACAUTO>; CAPACITANCE: 0.1µF; DKPN: 445-14655-1-ND; MANUFACTURER: TDK Corporation; MOPN: 810-C3216NP01H104J1A; MPN: C3216NP01H104J160AA; TOLERANCE: 5%; VOLTAGE: 50V
C41 C50 = HyTechDevices:CAPACITOR_?_*: Capacitor, Non-Polarized VJ...1BC Series Datasheet <https://www.mouser.com/datasheet/2/427/vjw1bcbascomseries-1762447.pdf> Samsung Datasheet <https://www.mouser.com/datasheet/2/585/MLCC-1837944.pdf> Samsung Automotive MLCC Datasheet <https://www.mouser.com/datasheet/2/585/MLCC_Automotive-1837966.pdf> Walsin Datasheet <https://www.mouser.com/datasheet/2/210/WTC_MLCC_General_Purpose-1534899.pdf> GRM188R61A226ME15D <https://www.mouser.com/datasheet/2/281/1/GRM188R61A226ME15_02A-1985787.pdf> GRM188R61E106MA73D <https://www.mouser.com/datasheet/2/281/1/GRM188R61E106MA73_01A-1985806.pdf> GRM31CR61C476ME44K <https://search.murata.co.jp/Ceramy/image/img/A01X/G101/ENG/GRM31CR61C476ME44-01A.pdf> GRM31A5C2J100JW01D <https://www.digikey.com/en/products/detail/murata-electronics/GRM31A5C2J100JW01D/4358998?s=N4IgTCBcDaIOICUCyBmAjAQQKwGEwCk0AGI-AdSLQBEQBdAXyA> 885012006013 <https://www.mouser.com/datasheet/2/445/885012006013-1726946.pdf> 2220Y6300105KXTWS2 <https://www.mouser.com/datasheet/2/218/SMD_High_and_Std_StackiCap_P62-1825512.pdf> Yageo Class 2, X5R <https://www.mouser.com/datasheet/2/447/UPY_GPHC_X5R_4V_to_50V_26-1827097.pdf> TDK C Series <https://www.mouser.com/ProductDetail/TDK/C3216X5R1V226M160AC?qs=%2Fha2pyFadujbcx9jh7lYl%2F4NeMoXFhdc8AqVWNq4wW6M2y7zl6GzBuhgtI0ngznN> AVX Automotive MLCC <https://www.mouser.com/datasheet/2/40/AutoMLCC-777028.pdf> KEMET X7R Series <https://www.mouser.com/datasheet/2/212/KEM_C1002_X7R_SMD-1102033.pdf> Kyocera AVX <https://www.mouser.com/datasheet/2/40/C0GNP0_Dielectric-951274.pdf> GRM21BR61H <https://www.mouser.com/datasheet/2/281/1/GRM21BR61H106KE43_01A-1986884.pdf> C1812W104KDRACTU <https://www.mouser.com/datasheet/2/212/KEM_C1034_X7R_HV_ARC_SMD-1101730.pdf> CGA series - MLCC Automotive grade <https://product.tdk.com/system/files/dam/doc/product/capacitor/ceramic/mlcc/catalog/mlcc_automotive_general_en.pdf> TDK C Series Data Sheet <https://product.tdk.com/system/files/dam/doc/product/capacitor/ceramic/mlcc/catalog/mlcc_commercial_general_en.pdf> Kemet Datasheet <https://connect.kemet.com:7667/gateway/IntelliData-ComponentDocumentation/1.0/download/datasheet/C0603C220K3RACAUTO>; CAPACITANCE: 1nF; DKPN: 399-C0603C102K5RAC7867CT-ND; MANUFACTURER: KEMET; MOPN: 80-C0603C102K5R; MPN: C0603C102K5RACTU; TOLERANCE: 10%; VOLTAGE: 50V
C43 C52 = HyTechDevices:CAPACITOR_?_*: Capacitor, Non-Polarized VJ...1BC Series Datasheet <https://www.mouser.com/datasheet/2/427/vjw1bcbascomseries-1762447.pdf> Samsung Datasheet <https://www.mouser.com/datasheet/2/585/MLCC-1837944.pdf> Samsung Automotive MLCC Datasheet <https://www.mouser.com/datasheet/2/585/MLCC_Automotive-1837966.pdf> Walsin Datasheet <https://www.mouser.com/datasheet/2/210/WTC_MLCC_General_Purpose-1534899.pdf> GRM188R61A226ME15D <https://www.mouser.com/datasheet/2/281/1/GRM188R61A226ME15_02A-1985787.pdf> GRM188R61E106MA73D <https://www.mouser.com/datasheet/2/281/1/GRM188R61E106MA73_01A-1985806.pdf> GRM31CR61C476ME44K <https://search.murata.co.jp/Ceramy/image/img/A01X/G101/ENG/GRM31CR61C476ME44-01A.pdf> GRM31A5C2J100JW01D <https://www.digikey.com/en/products/detail/murata-electronics/GRM31A5C2J100JW01D/4358998?s=N4IgTCBcDaIOICUCyBmAjAQQKwGEwCk0AGI-AdSLQBEQBdAXyA> 885012006013 <https://www.mouser.com/datasheet/2/445/885012006013-1726946.pdf> 2220Y6300105KXTWS2 <https://www.mouser.com/datasheet/2/218/SMD_High_and_Std_StackiCap_P62-1825512.pdf> Yageo Class 2, X5R <https://www.mouser.com/datasheet/2/447/UPY_GPHC_X5R_4V_to_50V_26-1827097.pdf> TDK C Series <https://www.mouser.com/ProductDetail/TDK/C3216X5R1V226M160AC?qs=%2Fha2pyFadujbcx9jh7lYl%2F4NeMoXFhdc8AqVWNq4wW6M2y7zl6GzBuhgtI0ngznN> AVX Automotive MLCC <https://www.mouser.com/datasheet/2/40/AutoMLCC-777028.pdf> KEMET X7R Series <https://www.mouser.com/datasheet/2/212/KEM_C1002_X7R_SMD-1102033.pdf> Kyocera AVX <https://www.mouser.com/datasheet/2/40/C0GNP0_Dielectric-951274.pdf> GRM21BR61H <https://www.mouser.com/datasheet/2/281/1/GRM21BR61H106KE43_01A-1986884.pdf> C1812W104KDRACTU <https://www.mouser.com/datasheet/2/212/KEM_C1034_X7R_HV_ARC_SMD-1101730.pdf> CGA series - MLCC Automotive grade <https://product.tdk.com/system/files/dam/doc/product/capacitor/ceramic/mlcc/catalog/mlcc_automotive_general_en.pdf> TDK C Series Data Sheet <https://product.tdk.com/system/files/dam/doc/product/capacitor/ceramic/mlcc/catalog/mlcc_commercial_general_en.pdf> Kemet Datasheet <https://connect.kemet.com:7667/gateway/IntelliData-ComponentDocumentation/1.0/download/datasheet/C0603C220K3RACAUTO>; CAPACITANCE: 10nF; DKPN: 311-1788-1-ND; MANUFACTURER: Yageo; MOPN: 603-CC603KRX7R0BB103; MPN: CC0603KRX7R0BB103; TOLERANCE: 10%; VOLTAGE: 100V
C54 = HyTechDevices:CAPACITOR_?_*: Capacitor, Non-Polarized VJ...1BC Series Datasheet <https://www.mouser.com/datasheet/2/427/vjw1bcbascomseries-1762447.pdf> Samsung Datasheet <https://www.mouser.com/datasheet/2/585/MLCC-1837944.pdf> Samsung Automotive MLCC Datasheet <https://www.mouser.com/datasheet/2/585/MLCC_Automotive-1837966.pdf> Walsin Datasheet <https://www.mouser.com/datasheet/2/210/WTC_MLCC_General_Purpose-1534899.pdf> GRM188R61A226ME15D <https://www.mouser.com/datasheet/2/281/1/GRM188R61A226ME15_02A-1985787.pdf> GRM188R61E106MA73D <https://www.mouser.com/datasheet/2/281/1/GRM188R61E106MA73_01A-1985806.pdf> GRM31CR61C476ME44K <https://search.murata.co.jp/Ceramy/image/img/A01X/G101/ENG/GRM31CR61C476ME44-01A.pdf> GRM31A5C2J100JW01D <https://www.digikey.com/en/products/detail/murata-electronics/GRM31A5C2J100JW01D/4358998?s=N4IgTCBcDaIOICUCyBmAjAQQKwGEwCk0AGI-AdSLQBEQBdAXyA> 885012006013 <https://www.mouser.com/datasheet/2/445/885012006013-1726946.pdf> 2220Y6300105KXTWS2 <https://www.mouser.com/datasheet/2/218/SMD_High_and_Std_StackiCap_P62-1825512.pdf> Yageo Class 2, X5R <https://www.mouser.com/datasheet/2/447/UPY_GPHC_X5R_4V_to_50V_26-1827097.pdf> TDK C Series <https://www.mouser.com/ProductDetail/TDK/C3216X5R1V226M160AC?qs=%2Fha2pyFadujbcx9jh7lYl%2F4NeMoXFhdc8AqVWNq4wW6M2y7zl6GzBuhgtI0ngznN> AVX Automotive MLCC <https://www.mouser.com/datasheet/2/40/AutoMLCC-777028.pdf> KEMET X7R Series <https://www.mouser.com/datasheet/2/212/KEM_C1002_X7R_SMD-1102033.pdf> Kyocera AVX <https://www.mouser.com/datasheet/2/40/C0GNP0_Dielectric-951274.pdf> GRM21BR61H <https://www.mouser.com/datasheet/2/281/1/GRM21BR61H106KE43_01A-1986884.pdf> C1812W104KDRACTU <https://www.mouser.com/datasheet/2/212/KEM_C1034_X7R_HV_ARC_SMD-1101730.pdf> CGA series - MLCC Automotive grade <https://product.tdk.com/system/files/dam/doc/product/capacitor/ceramic/mlcc/catalog/mlcc_automotive_general_en.pdf> TDK C Series Data Sheet <https://product.tdk.com/system/files/dam/doc/product/capacitor/ceramic/mlcc/catalog/mlcc_commercial_general_en.pdf> Kemet Datasheet <https://connect.kemet.com:7667/gateway/IntelliData-ComponentDocumentation/1.0/download/datasheet/C0603C220K3RACAUTO>; CAPACITANCE: 10pF; DKPN: 490-11620-2-ND; MANUFACTURER: Murata Electronics; MOPN: 81-GRM31A5C2J100JW1D; MPN: GRM31A5C2J100JW01D; TOLERANCE: 5%; VOLTAGE: 630V
D1 D9 D11 = HyTechDevices:RECTIFIER_*_?: Diodes Incorporated US1GWF Datasheet <https://www.mouser.com/datasheet/2/115/DIOD_S_A0003383552_1-2542294.pdf> Diodes Incorporated US1M Datasheet <https://www.diodes.com/assets/Datasheets/ds16008.pdf> onsemi US1KFA Datasheet <https://www.onsemi.com/pdf/datasheet/us1mfa-d.pdf> Taiwan Semiconductor Corporation HS1KLW Datasheet <https://services.taiwansemi.com/storage/resources/datasheet/HS1DLW%20SERIES_C2103.pdf>; CURRENT: 1A; DKPN: 1801-HS1KLWCT-ND; MANUFACTURER: Taiwan Semiconductor Corporation; MOPN: 821-HS1KLW; MPN: HS1KLW; VOLTAGE: 800V
D2 = HyTechDevices:SCHOTTKY_?_*: CUS08F30 Shottky Diode Datasheet <https://www.mouser.com/datasheet/2/408/CUS08F30_datasheet_en_20140414-1916097.pdf> CMDSH2-3 Shottky Diode Datasheet <https://www.mouser.com/datasheet/2/68/cmdsh2-3-39086.pdf>; CURRENT: 0.2A; DKPN: 1514-CMDSH2-3TRPBFREECT-ND; MANUFACTURER: Central Semiconductor Corp; MOPN: 610-CMDSH2-3; MPN: CMDSH2-3 TR PBFREE; VOLTAGE: 30V
D3 D4 = HyTechDevices:LED_?_*: LED 0603 Blue <https://www.mouser.com/datasheet/2/216/APT1608VBC_D-246010.pdf> Green <https://www.mouser.com/datasheet/2/216/APT1608ZGCK-1173388.pdf> Orange <https://www.mouser.com/datasheet/2/216/APT1608SECK-6197.pdf> Red <https://www.mouser.com/datasheet/2/216/APT1608SECK-J3-PRV-1173336.pdf> White <https://www.mouser.com/datasheet/2/50/SM0603UWC-880813.pdf> Yellow <https://www.mouser.com/datasheet/2/216/APT1608SYCK-J3-PRV-1173311.pdf> 2835 (Series not on Digikey) Lumiled LUXEON 2835 Color Line <https://www.mouser.com/datasheet/2/602/DS236_luxeon_2835_color_line_datasheet-1596094.pdf>; COLOR: Blue; DKPN: 754-1789-1-ND; MANUFACTURER: Kingbright; MOPN: 604-APT1608VBC/D; MPN: APT1608VBC/D
D5 = HyTechDevices:LED_?_*: LED 0603 Blue <https://www.mouser.com/datasheet/2/216/APT1608VBC_D-246010.pdf> Green <https://www.mouser.com/datasheet/2/216/APT1608ZGCK-1173388.pdf> Orange <https://www.mouser.com/datasheet/2/216/APT1608SECK-6197.pdf> Red <https://www.mouser.com/datasheet/2/216/APT1608SECK-J3-PRV-1173336.pdf> White <https://www.mouser.com/datasheet/2/50/SM0603UWC-880813.pdf> Yellow <https://www.mouser.com/datasheet/2/216/APT1608SYCK-J3-PRV-1173311.pdf> 2835 (Series not on Digikey) Lumiled LUXEON 2835 Color Line <https://www.mouser.com/datasheet/2/602/DS236_luxeon_2835_color_line_datasheet-1596094.pdf>; COLOR: Orange; DKPN: 754-1120-1-ND; MANUFACTURER: Kingbright; MOPN: 604-APT1608SECK; MPN: APT1608SECK
D7 = HyTechDevices:TVS_?_*: TVS Diode GSOT Datasheet <https://www.mouser.com/datasheet/2/427/gsot03-1767593.pdf> SMF14A Datasheet <https://www.vishay.com/docs/85881/smf5v0atosmf58a.pdf> TPSMB Datasheet <https://www.mouser.com/datasheet/2/240/media-3323583.pdf>; DKPN: GSOT08-E3-08TR-ND; MANUFACTURER: Vishay General Semiconductor - Diodes Division; MOPN: 78-GSOT08-E3-08; MPN: GSOT08-E3-08; VOLTAGE: 8V
D8 = HyTechDevices:LED_?_*: LED 0603 Blue <https://www.mouser.com/datasheet/2/216/APT1608VBC_D-246010.pdf> Green <https://www.mouser.com/datasheet/2/216/APT1608ZGCK-1173388.pdf> Orange <https://www.mouser.com/datasheet/2/216/APT1608SECK-6197.pdf> Red <https://www.mouser.com/datasheet/2/216/APT1608SECK-J3-PRV-1173336.pdf> White <https://www.mouser.com/datasheet/2/50/SM0603UWC-880813.pdf> Yellow <https://www.mouser.com/datasheet/2/216/APT1608SYCK-J3-PRV-1173311.pdf> 2835 (Series not on Digikey) Lumiled LUXEON 2835 Color Line <https://www.mouser.com/datasheet/2/602/DS236_luxeon_2835_color_line_datasheet-1596094.pdf>; COLOR: Yellow; DKPN: 754-1788-1-ND; MANUFACTURER: Kingbright; MOPN: 604-APT1608SYCK/J3-PRV; MPN: APT1608SYCK/J3-PRV
D10 D13 = HyTechDevices:TVS_?_*: TVS Diode GSOT Datasheet <https://www.mouser.com/datasheet/2/427/gsot03-1767593.pdf> SMF14A Datasheet <https://www.vishay.com/docs/85881/smf5v0atosmf58a.pdf> TPSMB Datasheet <https://www.mouser.com/datasheet/2/240/media-3323583.pdf>; DKPN: F10341CT-ND; MANUFACTURER: Littelfuse Inc.; MOPN: 576-TPSMB550CA-A; MPN: TPSMB550CA-A; VOLTAGE: 522.5V
D12 = HyTechDevices:ZENER_?_*: Zener Diode 1SMB5949B-13 <https://www.diodes.com/assets/Datasheets/ds32125.pdf> SMBJ5350B-TP <https://www.mccsemi.com/pdf/Products/SMBJ5338B-SMBJ5388B(SMB).pdf>; CURRENT: 0.385A; DKPN: SMBJ5350B-TPMSCT-ND; MANUFACTURER: Micro Commercial Co; MOPN: 833-SMBJ5350B-TP; MPN: SMBJ5350B-TP; VOLTAGE: 13V
D100 = HyTechDevices:SCHOTTKY_?_*: CUS08F30 Shottky Diode Datasheet <https://www.mouser.com/datasheet/2/408/CUS08F30_datasheet_en_20140414-1916097.pdf> CMDSH2-3 Shottky Diode Datasheet <https://www.mouser.com/datasheet/2/68/cmdsh2-3-39086.pdf>; CURRENT: 1A; DKPN: 3757-MBR1060HEWS_R1_00001TR-ND; MANUFACTURER: Panjit International Inc.; MOPN: 241-MBR1060HEWSR1000; MPN: MBR1060HEWS_R1_00001; VOLTAGE: 60V
F1 F2 = HyTechDevices:FUSE_HOLDER_*: Fuse Holder All PNs for the holder; if Miniblade Fuses <https://www.littelfuse.com/media?resourcetype=datasheets&itemid=0f5f58cb-559e-494b-8d53-723f30445ae5&filename=littelfuse-mini-datasheet> needed, order separately. Mini-Blade PTH <https://www.mouser.com/datasheet/2/215/3568-742601.pdf> Mini-Blade SMD <https://www.mouser.com/datasheet/2/215/588-744913.pdf> Littelfuse 122 Fuse Holder and Fuse Fuse <https://www.littelfuse.com/~/media/electronics/datasheets/fuses/littelfuse_fuse_508_datasheet.pdf.pdf> Fuse Holder <https://www.littelfuse.com/~/media/electronics/datasheets/fuse_clips/littelfuse_fuse_clip_102_122_datasheet.pdf.pdf>; DKPN: F3783-ND; FUSE_TYPE: 1 1/4" Cartridge; MANUFACTURER: Littelfuse; MOPN: 576-01220088Z; MPN: 01220088Z
J1 = HyTechDevices:CONNECTOR-2_?_*: 2 Pin Connector; DKPN: WM12762-ND; MANUFACTURER: Molex; MOPN: 538-43650-0217; MPN: 0436500217
K1 = HyTechDevices:RELAY_SPST_NO_?*: Single Pole, Single Throw Relay Normally Open 355x Series <https://www.comus-intl.com/wp-content/uploads/2017/01/High-Voltage-Reed-Relays.pdf> D Series <https://www.mouser.com/datasheet/2/657/cynergy3_d_pcb_v2-1892244.pdf>; DKPN: 725-1362-ND; MANUFACTURER: Sensata-Cynergy3; MOPN: 285-DAT200-24; MPN: DAT200-24
L1 = HyTechDevices:INDUCTOR_?_*: Inductor LQM18DH100M70 Datasheet <https://search.murata.co.jp/Ceramy/image/img/P02/JELF243B-9127.pdf> 74451133 Datasheet <https://www.we-online.com/catalog/datasheet/74451133.pdf> SRU1408 Datasheet <https://www.mouser.com/datasheet/2/54/SRU1048-1391431.pdf> PA4334 Datasheet <https://www.mouser.com/datasheet/2/336/plei_s_a0002827602_1-2281222.pdf> WE-LMHI Datasheet <https://www.mouser.com/datasheet/2/445/74437349560-1721693.pdf> SRR0745A Datasheet <https://www.bourns.com/docs/Product-Datasheets/SRR0745A.pdf> CDEEH13D90 Datasheet <https://products.sumida.com/products/pdf/CDEEH13D90T150%20(en).pdf>; CURRENT_RATED: N/A; CURRENT_SATURATION: 340mA; DCR: 1.53Ω; DKPN: N/A; INDUCTANCE: 1mH; MANUFACTURER: Sumida; MAX_VOLTAGE: 840V; MOPN: N/A; MPN: CDEEH13D90T150NP-102LC; TOLERANCE: 15%
Q1 = HyTechDevices:TRANSISTOR_N_MOS_?_*: N-MOSFET PMV15ENEA Datasheet <https://www.mouser.com/datasheet/2/916/PMV15ENEA-1604828.pdf> TK6P65W Datasheet <https://www.mouser.com/datasheet/2/408/TK6P65W_datasheet_en_20151225-1916290.pdf> SIR638ADP Datasheet <https://www.mouser.com/datasheet/2/427/sir638adp-1766131.pdf> DMG3406L Datasheet <https://www.diodes.com/assets/Datasheets/DMG3406L.pdf> STL2N80K5 <https://www.mouser.com/datasheet/2/389/dm00092662-1798082.pdf> TK3P80E Datasheet <https://toshiba.semicon-storage.com/info/TK3P80E_datasheet_en_20140917.pdf?did=14695&prodName=TK3P80E>; DKPN: 264-TK3P80E,RQDKR-ND; MANUFACTURER: Toshiba Semiconductor and Storage; MOPN: 757-TK3P80ERQ; MPN: TK3P80E,RQ
Q2 = HyTechDevices:TRANSISTOR_N_MOS_?_*: N-MOSFET PMV15ENEA Datasheet <https://www.mouser.com/datasheet/2/916/PMV15ENEA-1604828.pdf> TK6P65W Datasheet <https://www.mouser.com/datasheet/2/408/TK6P65W_datasheet_en_20151225-1916290.pdf> SIR638ADP Datasheet <https://www.mouser.com/datasheet/2/427/sir638adp-1766131.pdf> DMG3406L Datasheet <https://www.diodes.com/assets/Datasheets/DMG3406L.pdf> STL2N80K5 <https://www.mouser.com/datasheet/2/389/dm00092662-1798082.pdf> TK3P80E Datasheet <https://toshiba.semicon-storage.com/info/TK3P80E_datasheet_en_20140917.pdf?did=14695&prodName=TK3P80E>; DKPN: 1727-8588-1-ND; MANUFACTURER: Nexperia USA Inc.; MOPN: 771-PMV15ENEAR; MPN: PMV15ENEAR
R1 R12 = HyTechDevices:RESISTOR_?_*: Resistor PWR163 Series <https://www.mouser.com/datasheet/2/54/pwr163-777985.pdf> AC Series <https://www.mouser.com/datasheet/2/447/Yageo_PYu_AC_51_RoHS_L_7_1714230-1874691.pdf> PU Series <https://www.mouser.com/datasheet/2/447/PYu-PU_51_RoHS_L_6-1504619.pdf> UCR Series <https://fscdn.rohm.com/en/products/databook/datasheet/passive/resistor/chip_resistor/ucr-e.pdf> ERA Series <https://www.mouser.com/datasheet/2/315/AOA0000C307-1149632.pdf> PWR263 Series <https://www.mouser.com/datasheet/2/54/pwr263s_35-778069.pdf> KTR Series <https://www.mouser.com/datasheet/2/348/ROHM_S_A0011075115_1-2563276.pdf> RC Series <https://www.mouser.com/datasheet/2/447/Yageo_03_18_2021_PYu_RC_Group_51_RoHS_L_11-2199992.pdf> ERJ Low Resistance Series <https://www.mouser.com/datasheet/2/315/AOA0000C313-1141758.pdf> ERJ PB3, PB6 Series <https://www.mouser.com/datasheet/2/315/AOA0000C328-1530132.pdf> ERJ UP3, UP6, UP8 Series <https://www.mouser.com/datasheet/2/315/Panasonic_Resistors_Thick_Film_Anti_Sulf_Anti_Surg-1825099.pdf> ERJ PA2, P03, PA3, P06, P08, P14 Series <https://www.mouser.com/datasheet/2/315/AOA0000C331-1141874.pdf> B20 Series <https://www.ohmite.com/assets/docs/res_200.pdf?r=false> TE Connectivity/Holsworthy RN73 Series <https://www.mouser.com/datasheet/2/418/4/NG_DS_1773270_M-604713.pdf> Vishay Dale D/CRCW e3 <https://www.mouser.com/datasheet/2/427/dcrcwe3-1762152.pdf> Ohmite B20 <https://www.ohmite.com/assets/docs/res_200.pdf?r=false>; RESISTANCE: DNP
R2 R3 = HyTechDevices:RESISTOR_?_*: Resistor PWR163 Series <https://www.mouser.com/datasheet/2/54/pwr163-777985.pdf> AC Series <https://www.mouser.com/datasheet/2/447/Yageo_PYu_AC_51_RoHS_L_7_1714230-1874691.pdf> PU Series <https://www.mouser.com/datasheet/2/447/PYu-PU_51_RoHS_L_6-1504619.pdf> UCR Series <https://fscdn.rohm.com/en/products/databook/datasheet/passive/resistor/chip_resistor/ucr-e.pdf> ERA Series <https://www.mouser.com/datasheet/2/315/AOA0000C307-1149632.pdf> PWR263 Series <https://www.mouser.com/datasheet/2/54/pwr263s_35-778069.pdf> KTR Series <https://www.mouser.com/datasheet/2/348/ROHM_S_A0011075115_1-2563276.pdf> RC Series <https://www.mouser.com/datasheet/2/447/Yageo_03_18_2021_PYu_RC_Group_51_RoHS_L_11-2199992.pdf> ERJ Low Resistance Series <https://www.mouser.com/datasheet/2/315/AOA0000C313-1141758.pdf> ERJ PB3, PB6 Series <https://www.mouser.com/datasheet/2/315/AOA0000C328-1530132.pdf> ERJ UP3, UP6, UP8 Series <https://www.mouser.com/datasheet/2/315/Panasonic_Resistors_Thick_Film_Anti_Sulf_Anti_Surg-1825099.pdf> ERJ PA2, P03, PA3, P06, P08, P14 Series <https://www.mouser.com/datasheet/2/315/AOA0000C331-1141874.pdf> B20 Series <https://www.ohmite.com/assets/docs/res_200.pdf?r=false> TE Connectivity/Holsworthy RN73 Series <https://www.mouser.com/datasheet/2/418/4/NG_DS_1773270_M-604713.pdf> Vishay Dale D/CRCW e3 <https://www.mouser.com/datasheet/2/427/dcrcwe3-1762152.pdf> Ohmite B20 <https://www.ohmite.com/assets/docs/res_200.pdf?r=false>; DKPN: P330KDBCT-ND; MANUFACTURER: Panasonic Electronic Components; MOPN: 667-ERA-3AEB334V; MPN: ERA-3AEB334V; POWER: 0.1W; RESISTANCE: 330k; TOLERANCE: 0.1%; VOLTAGE_CONTINUOUS: 75V; VOLTAGE_MAX: 75V
R4 = HyTechDevices:RESISTOR_?_*: Resistor PWR163 Series <https://www.mouser.com/datasheet/2/54/pwr163-777985.pdf> AC Series <https://www.mouser.com/datasheet/2/447/Yageo_PYu_AC_51_RoHS_L_7_1714230-1874691.pdf> PU Series <https://www.mouser.com/datasheet/2/447/PYu-PU_51_RoHS_L_6-1504619.pdf> UCR Series <https://fscdn.rohm.com/en/products/databook/datasheet/passive/resistor/chip_resistor/ucr-e.pdf> ERA Series <https://www.mouser.com/datasheet/2/315/AOA0000C307-1149632.pdf> PWR263 Series <https://www.mouser.com/datasheet/2/54/pwr263s_35-778069.pdf> KTR Series <https://www.mouser.com/datasheet/2/348/ROHM_S_A0011075115_1-2563276.pdf> RC Series <https://www.mouser.com/datasheet/2/447/Yageo_03_18_2021_PYu_RC_Group_51_RoHS_L_11-2199992.pdf> ERJ Low Resistance Series <https://www.mouser.com/datasheet/2/315/AOA0000C313-1141758.pdf> ERJ PB3, PB6 Series <https://www.mouser.com/datasheet/2/315/AOA0000C328-1530132.pdf> ERJ UP3, UP6, UP8 Series <https://www.mouser.com/datasheet/2/315/Panasonic_Resistors_Thick_Film_Anti_Sulf_Anti_Surg-1825099.pdf> ERJ PA2, P03, PA3, P06, P08, P14 Series <https://www.mouser.com/datasheet/2/315/AOA0000C331-1141874.pdf> B20 Series <https://www.ohmite.com/assets/docs/res_200.pdf?r=false> TE Connectivity/Holsworthy RN73 Series <https://www.mouser.com/datasheet/2/418/4/NG_DS_1773270_M-604713.pdf> Vishay Dale D/CRCW e3 <https://www.mouser.com/datasheet/2/427/dcrcwe3-1762152.pdf> Ohmite B20 <https://www.ohmite.com/assets/docs/res_200.pdf?r=false>; DKPN: P20885CT-ND; MANUFACTURER: Panasonic Electronic Components; MOPN: 667-ERJ-PB6B3653V; MPN: ERJ-PB6B3653V; POWER: 0.25W; RESISTANCE: 365k; TOLERANCE: 0.1%; VOLTAGE_CONTINUOUS: 150V; VOLTAGE_MAX: 150V
R5 = HyTechDevices:RESISTOR_?_*: Resistor PWR163 Series <https://www.mouser.com/datasheet/2/54/pwr163-777985.pdf> AC Series <https://www.mouser.com/datasheet/2/447/Yageo_PYu_AC_51_RoHS_L_7_1714230-1874691.pdf> PU Series <https://www.mouser.com/datasheet/2/447/PYu-PU_51_RoHS_L_6-1504619.pdf> UCR Series <https://fscdn.rohm.com/en/products/databook/datasheet/passive/resistor/chip_resistor/ucr-e.pdf> ERA Series <https://www.mouser.com/datasheet/2/315/AOA0000C307-1149632.pdf> PWR263 Series <https://www.mouser.com/datasheet/2/54/pwr263s_35-778069.pdf> KTR Series <https://www.mouser.com/datasheet/2/348/ROHM_S_A0011075115_1-2563276.pdf> RC Series <https://www.mouser.com/datasheet/2/447/Yageo_03_18_2021_PYu_RC_Group_51_RoHS_L_11-2199992.pdf> ERJ Low Resistance Series <https://www.mouser.com/datasheet/2/315/AOA0000C313-1141758.pdf> ERJ PB3, PB6 Series <https://www.mouser.com/datasheet/2/315/AOA0000C328-1530132.pdf> ERJ UP3, UP6, UP8 Series <https://www.mouser.com/datasheet/2/315/Panasonic_Resistors_Thick_Film_Anti_Sulf_Anti_Surg-1825099.pdf> ERJ PA2, P03, PA3, P06, P08, P14 Series <https://www.mouser.com/datasheet/2/315/AOA0000C331-1141874.pdf> B20 Series <https://www.ohmite.com/assets/docs/res_200.pdf?r=false> TE Connectivity/Holsworthy RN73 Series <https://www.mouser.com/datasheet/2/418/4/NG_DS_1773270_M-604713.pdf> Vishay Dale D/CRCW e3 <https://www.mouser.com/datasheet/2/427/dcrcwe3-1762152.pdf> Ohmite B20 <https://www.ohmite.com/assets/docs/res_200.pdf?r=false>; DKPN: 311-20.0KHRTR-ND; MANUFACTURER: Yageo; MOPN: 603-RC0603FR-0720KL; MPN: RC0603FR-0720KL; POWER: 0.1 W; RESISTANCE: 20k; TOLERANCE: 1%; VOLTAGE_CONTINUOUS: 44.72V; VOLTAGE_MAX: 75V
R6 = HyTechDevices:RESISTOR_?_*: Resistor PWR163 Series <https://www.mouser.com/datasheet/2/54/pwr163-777985.pdf> AC Series <https://www.mouser.com/datasheet/2/447/Yageo_PYu_AC_51_RoHS_L_7_1714230-1874691.pdf> PU Series <https://www.mouser.com/datasheet/2/447/PYu-PU_51_RoHS_L_6-1504619.pdf> UCR Series <https://fscdn.rohm.com/en/products/databook/datasheet/passive/resistor/chip_resistor/ucr-e.pdf> ERA Series <https://www.mouser.com/datasheet/2/315/AOA0000C307-1149632.pdf> PWR263 Series <https://www.mouser.com/datasheet/2/54/pwr263s_35-778069.pdf> KTR Series <https://www.mouser.com/datasheet/2/348/ROHM_S_A0011075115_1-2563276.pdf> RC Series <https://www.mouser.com/datasheet/2/447/Yageo_03_18_2021_PYu_RC_Group_51_RoHS_L_11-2199992.pdf> ERJ Low Resistance Series <https://www.mouser.com/datasheet/2/315/AOA0000C313-1141758.pdf> ERJ PB3, PB6 Series <https://www.mouser.com/datasheet/2/315/AOA0000C328-1530132.pdf> ERJ UP3, UP6, UP8 Series <https://www.mouser.com/datasheet/2/315/Panasonic_Resistors_Thick_Film_Anti_Sulf_Anti_Surg-1825099.pdf> ERJ PA2, P03, PA3, P06, P08, P14 Series <https://www.mouser.com/datasheet/2/315/AOA0000C331-1141874.pdf> B20 Series <https://www.ohmite.com/assets/docs/res_200.pdf?r=false> TE Connectivity/Holsworthy RN73 Series <https://www.mouser.com/datasheet/2/418/4/NG_DS_1773270_M-604713.pdf> Vishay Dale D/CRCW e3 <https://www.mouser.com/datasheet/2/427/dcrcwe3-1762152.pdf> Ohmite B20 <https://www.ohmite.com/assets/docs/res_200.pdf?r=false>; DKPN: P20096CT-ND; MANUFACTURER: Panasonic Electronic Components; MOPN: 667-ERJ-PB3B1242V; MPN: ERJ-PB3B1242V; POWER: 0.2W; RESISTANCE: 12.4k; TOLERANCE: 0.1%; VOLTAGE_CONTINUOUS: 49.79V; VOLTAGE_MAX: 150V
R7 R30 R42 = HyTechDevices:RESISTOR_?_*: Resistor PWR163 Series <https://www.mouser.com/datasheet/2/54/pwr163-777985.pdf> AC Series <https://www.mouser.com/datasheet/2/447/Yageo_PYu_AC_51_RoHS_L_7_1714230-1874691.pdf> PU Series <https://www.mouser.com/datasheet/2/447/PYu-PU_51_RoHS_L_6-1504619.pdf> UCR Series <https://fscdn.rohm.com/en/products/databook/datasheet/passive/resistor/chip_resistor/ucr-e.pdf> ERA Series <https://www.mouser.com/datasheet/2/315/AOA0000C307-1149632.pdf> PWR263 Series <https://www.mouser.com/datasheet/2/54/pwr263s_35-778069.pdf> KTR Series <https://www.mouser.com/datasheet/2/348/ROHM_S_A0011075115_1-2563276.pdf> RC Series <https://www.mouser.com/datasheet/2/447/Yageo_03_18_2021_PYu_RC_Group_51_RoHS_L_11-2199992.pdf> ERJ Low Resistance Series <https://www.mouser.com/datasheet/2/315/AOA0000C313-1141758.pdf> ERJ PB3, PB6 Series <https://www.mouser.com/datasheet/2/315/AOA0000C328-1530132.pdf> ERJ UP3, UP6, UP8 Series <https://www.mouser.com/datasheet/2/315/Panasonic_Resistors_Thick_Film_Anti_Sulf_Anti_Surg-1825099.pdf> ERJ PA2, P03, PA3, P06, P08, P14 Series <https://www.mouser.com/datasheet/2/315/AOA0000C331-1141874.pdf> B20 Series <https://www.ohmite.com/assets/docs/res_200.pdf?r=false> TE Connectivity/Holsworthy RN73 Series <https://www.mouser.com/datasheet/2/418/4/NG_DS_1773270_M-604713.pdf> Vishay Dale D/CRCW e3 <https://www.mouser.com/datasheet/2/427/dcrcwe3-1762152.pdf> Ohmite B20 <https://www.ohmite.com/assets/docs/res_200.pdf?r=false>; DKPN: 311-12.0KHRCT-ND; MANUFACTURER: Yageo; MOPN: 603-RC0603FR-0712KL; MPN: RC0603FR-0712KL; POWER: 0.1W; RESISTANCE: 12k; TOLERANCE: 1%; VOLTAGE_CONTINUOUS: 34.64V; VOLTAGE_MAX: 75V
R8 = HyTechDevices:RESISTOR_?_*: Resistor PWR163 Series <https://www.mouser.com/datasheet/2/54/pwr163-777985.pdf> AC Series <https://www.mouser.com/datasheet/2/447/Yageo_PYu_AC_51_RoHS_L_7_1714230-1874691.pdf> PU Series <https://www.mouser.com/datasheet/2/447/PYu-PU_51_RoHS_L_6-1504619.pdf> UCR Series <https://fscdn.rohm.com/en/products/databook/datasheet/passive/resistor/chip_resistor/ucr-e.pdf> ERA Series <https://www.mouser.com/datasheet/2/315/AOA0000C307-1149632.pdf> PWR263 Series <https://www.mouser.com/datasheet/2/54/pwr263s_35-778069.pdf> KTR Series <https://www.mouser.com/datasheet/2/348/ROHM_S_A0011075115_1-2563276.pdf> RC Series <https://www.mouser.com/datasheet/2/447/Yageo_03_18_2021_PYu_RC_Group_51_RoHS_L_11-2199992.pdf> ERJ Low Resistance Series <https://www.mouser.com/datasheet/2/315/AOA0000C313-1141758.pdf> ERJ PB3, PB6 Series <https://www.mouser.com/datasheet/2/315/AOA0000C328-1530132.pdf> ERJ UP3, UP6, UP8 Series <https://www.mouser.com/datasheet/2/315/Panasonic_Resistors_Thick_Film_Anti_Sulf_Anti_Surg-1825099.pdf> ERJ PA2, P03, PA3, P06, P08, P14 Series <https://www.mouser.com/datasheet/2/315/AOA0000C331-1141874.pdf> B20 Series <https://www.ohmite.com/assets/docs/res_200.pdf?r=false> TE Connectivity/Holsworthy RN73 Series <https://www.mouser.com/datasheet/2/418/4/NG_DS_1773270_M-604713.pdf> Vishay Dale D/CRCW e3 <https://www.mouser.com/datasheet/2/427/dcrcwe3-1762152.pdf> Ohmite B20 <https://www.ohmite.com/assets/docs/res_200.pdf?r=false>; DKPN: 311-2.55KHRCT-ND; MANUFACTURER: Yageo; MOPN: 603-RC0603FR-072K55L; MPN: RC0603FR-072K55L; POWER: 0.1W; RESISTANCE: 2.55k; TOLERANCE: 1%; VOLTAGE_CONTINUOUS: 15.97V; VOLTAGE_MAX: 75V
R9 R26 R29 R31 = HyTechDevices:RESISTOR_?_*: Resistor PWR163 Series <https://www.mouser.com/datasheet/2/54/pwr163-777985.pdf> AC Series <https://www.mouser.com/datasheet/2/447/Yageo_PYu_AC_51_RoHS_L_7_1714230-1874691.pdf> PU Series <https://www.mouser.com/datasheet/2/447/PYu-PU_51_RoHS_L_6-1504619.pdf> UCR Series <https://fscdn.rohm.com/en/products/databook/datasheet/passive/resistor/chip_resistor/ucr-e.pdf> ERA Series <https://www.mouser.com/datasheet/2/315/AOA0000C307-1149632.pdf> PWR263 Series <https://www.mouser.com/datasheet/2/54/pwr263s_35-778069.pdf> KTR Series <https://www.mouser.com/datasheet/2/348/ROHM_S_A0011075115_1-2563276.pdf> RC Series <https://www.mouser.com/datasheet/2/447/Yageo_03_18_2021_PYu_RC_Group_51_RoHS_L_11-2199992.pdf> ERJ Low Resistance Series <https://www.mouser.com/datasheet/2/315/AOA0000C313-1141758.pdf> ERJ PB3, PB6 Series <https://www.mouser.com/datasheet/2/315/AOA0000C328-1530132.pdf> ERJ UP3, UP6, UP8 Series <https://www.mouser.com/datasheet/2/315/Panasonic_Resistors_Thick_Film_Anti_Sulf_Anti_Surg-1825099.pdf> ERJ PA2, P03, PA3, P06, P08, P14 Series <https://www.mouser.com/datasheet/2/315/AOA0000C331-1141874.pdf> B20 Series <https://www.ohmite.com/assets/docs/res_200.pdf?r=false> TE Connectivity/Holsworthy RN73 Series <https://www.mouser.com/datasheet/2/418/4/NG_DS_1773270_M-604713.pdf> Vishay Dale D/CRCW e3 <https://www.mouser.com/datasheet/2/427/dcrcwe3-1762152.pdf> Ohmite B20 <https://www.ohmite.com/assets/docs/res_200.pdf?r=false>; DKPN: 1712-CPF-A-0603B1K0ETR-ND; MANUFACTURER: TE Connectivity Passive Product; MOPN: 279-CPF-A-0603B1K0E; MPN: CPF-A-0603B1K0E; POWER: 0.0625W; RESISTANCE: 1k; TOLERANCE: 0.1%; VOLTAGE_CONTINUOUS: 7.9V; VOLTAGE_MAX: 50V
R10 = HyTechDevices:RESISTOR_?_*: Resistor PWR163 Series <https://www.mouser.com/datasheet/2/54/pwr163-777985.pdf> AC Series <https://www.mouser.com/datasheet/2/447/Yageo_PYu_AC_51_RoHS_L_7_1714230-1874691.pdf> PU Series <https://www.mouser.com/datasheet/2/447/PYu-PU_51_RoHS_L_6-1504619.pdf> UCR Series <https://fscdn.rohm.com/en/products/databook/datasheet/passive/resistor/chip_resistor/ucr-e.pdf> ERA Series <https://www.mouser.com/datasheet/2/315/AOA0000C307-1149632.pdf> PWR263 Series <https://www.mouser.com/datasheet/2/54/pwr263s_35-778069.pdf> KTR Series <https://www.mouser.com/datasheet/2/348/ROHM_S_A0011075115_1-2563276.pdf> RC Series <https://www.mouser.com/datasheet/2/447/Yageo_03_18_2021_PYu_RC_Group_51_RoHS_L_11-2199992.pdf> ERJ Low Resistance Series <https://www.mouser.com/datasheet/2/315/AOA0000C313-1141758.pdf> ERJ PB3, PB6 Series <https://www.mouser.com/datasheet/2/315/AOA0000C328-1530132.pdf> ERJ UP3, UP6, UP8 Series <https://www.mouser.com/datasheet/2/315/Panasonic_Resistors_Thick_Film_Anti_Sulf_Anti_Surg-1825099.pdf> ERJ PA2, P03, PA3, P06, P08, P14 Series <https://www.mouser.com/datasheet/2/315/AOA0000C331-1141874.pdf> B20 Series <https://www.ohmite.com/assets/docs/res_200.pdf?r=false> TE Connectivity/Holsworthy RN73 Series <https://www.mouser.com/datasheet/2/418/4/NG_DS_1773270_M-604713.pdf> Vishay Dale D/CRCW e3 <https://www.mouser.com/datasheet/2/427/dcrcwe3-1762152.pdf> Ohmite B20 <https://www.ohmite.com/assets/docs/res_200.pdf?r=false>; DKPN: P20904TR-ND; MANUFACTURER: Panasonic Electronic Components; MOPN: 667-ERJ-PB6B5233V; MPN: ERJ-PB6B5233V; POWER: 0.25W; RESISTANCE: 523k; TOLERANCE: 0.1%; VOLTAGE_CONTINUOUS: 150V; VOLTAGE_MAX: 150V
R11 = HyTechDevices:RESISTOR_?_*: Resistor PWR163 Series <https://www.mouser.com/datasheet/2/54/pwr163-777985.pdf> AC Series <https://www.mouser.com/datasheet/2/447/Yageo_PYu_AC_51_RoHS_L_7_1714230-1874691.pdf> PU Series <https://www.mouser.com/datasheet/2/447/PYu-PU_51_RoHS_L_6-1504619.pdf> UCR Series <https://fscdn.rohm.com/en/products/databook/datasheet/passive/resistor/chip_resistor/ucr-e.pdf> ERA Series <https://www.mouser.com/datasheet/2/315/AOA0000C307-1149632.pdf> PWR263 Series <https://www.mouser.com/datasheet/2/54/pwr263s_35-778069.pdf> KTR Series <https://www.mouser.com/datasheet/2/348/ROHM_S_A0011075115_1-2563276.pdf> RC Series <https://www.mouser.com/datasheet/2/447/Yageo_03_18_2021_PYu_RC_Group_51_RoHS_L_11-2199992.pdf> ERJ Low Resistance Series <https://www.mouser.com/datasheet/2/315/AOA0000C313-1141758.pdf> ERJ PB3, PB6 Series <https://www.mouser.com/datasheet/2/315/AOA0000C328-1530132.pdf> ERJ UP3, UP6, UP8 Series <https://www.mouser.com/datasheet/2/315/Panasonic_Resistors_Thick_Film_Anti_Sulf_Anti_Surg-1825099.pdf> ERJ PA2, P03, PA3, P06, P08, P14 Series <https://www.mouser.com/datasheet/2/315/AOA0000C331-1141874.pdf> B20 Series <https://www.ohmite.com/assets/docs/res_200.pdf?r=false> TE Connectivity/Holsworthy RN73 Series <https://www.mouser.com/datasheet/2/418/4/NG_DS_1773270_M-604713.pdf> Vishay Dale D/CRCW e3 <https://www.mouser.com/datasheet/2/427/dcrcwe3-1762152.pdf> Ohmite B20 <https://www.ohmite.com/assets/docs/res_200.pdf?r=false>; DKPN: P100KDBCT-ND; MANUFACTURER: Panasonic Electronic Components; MOPN: 667-ERA-3AEB104V; MPN: ERA-3AEB104V; POWER: 0.1W; RESISTANCE: 100k; TOLERANCE: 0.1%; VOLTAGE_CONTINUOUS: 75V; VOLTAGE_MAX: 150V
R13 R23 = HyTechDevices:RESISTOR_?_*: Resistor PWR163 Series <https://www.mouser.com/datasheet/2/54/pwr163-777985.pdf> AC Series <https://www.mouser.com/datasheet/2/447/Yageo_PYu_AC_51_RoHS_L_7_1714230-1874691.pdf> PU Series <https://www.mouser.com/datasheet/2/447/PYu-PU_51_RoHS_L_6-1504619.pdf> UCR Series <https://fscdn.rohm.com/en/products/databook/datasheet/passive/resistor/chip_resistor/ucr-e.pdf> ERA Series <https://www.mouser.com/datasheet/2/315/AOA0000C307-1149632.pdf> PWR263 Series <https://www.mouser.com/datasheet/2/54/pwr263s_35-778069.pdf> KTR Series <https://www.mouser.com/datasheet/2/348/ROHM_S_A0011075115_1-2563276.pdf> RC Series <https://www.mouser.com/datasheet/2/447/Yageo_03_18_2021_PYu_RC_Group_51_RoHS_L_11-2199992.pdf> ERJ Low Resistance Series <https://www.mouser.com/datasheet/2/315/AOA0000C313-1141758.pdf> ERJ PB3, PB6 Series <https://www.mouser.com/datasheet/2/315/AOA0000C328-1530132.pdf> ERJ UP3, UP6, UP8 Series <https://www.mouser.com/datasheet/2/315/Panasonic_Resistors_Thick_Film_Anti_Sulf_Anti_Surg-1825099.pdf> ERJ PA2, P03, PA3, P06, P08, P14 Series <https://www.mouser.com/datasheet/2/315/AOA0000C331-1141874.pdf> B20 Series <https://www.ohmite.com/assets/docs/res_200.pdf?r=false> TE Connectivity/Holsworthy RN73 Series <https://www.mouser.com/datasheet/2/418/4/NG_DS_1773270_M-604713.pdf> Vishay Dale D/CRCW e3 <https://www.mouser.com/datasheet/2/427/dcrcwe3-1762152.pdf> Ohmite B20 <https://www.ohmite.com/assets/docs/res_200.pdf?r=false>; DKPN: B20J1K5E-ND; MANUFACTURER: Ohmite; MOPN: 588-B20J3K0E; MPN: B20J3K0E; POWER: 20W; RESISTANCE: 3K; TOLERANCE: 5%; VOLTAGE_CONTINUOUS: 173V; VOLTAGE_MAX: 750V
R14 = HyTechDevices:RESISTOR_?_*: Resistor PWR163 Series <https://www.mouser.com/datasheet/2/54/pwr163-777985.pdf> AC Series <https://www.mouser.com/datasheet/2/447/Yageo_PYu_AC_51_RoHS_L_7_1714230-1874691.pdf> PU Series <https://www.mouser.com/datasheet/2/447/PYu-PU_51_RoHS_L_6-1504619.pdf> UCR Series <https://fscdn.rohm.com/en/products/databook/datasheet/passive/resistor/chip_resistor/ucr-e.pdf> ERA Series <https://www.mouser.com/datasheet/2/315/AOA0000C307-1149632.pdf> PWR263 Series <https://www.mouser.com/datasheet/2/54/pwr263s_35-778069.pdf> KTR Series <https://www.mouser.com/datasheet/2/348/ROHM_S_A0011075115_1-2563276.pdf> RC Series <https://www.mouser.com/datasheet/2/447/Yageo_03_18_2021_PYu_RC_Group_51_RoHS_L_11-2199992.pdf> ERJ Low Resistance Series <https://www.mouser.com/datasheet/2/315/AOA0000C313-1141758.pdf> ERJ PB3, PB6 Series <https://www.mouser.com/datasheet/2/315/AOA0000C328-1530132.pdf> ERJ UP3, UP6, UP8 Series <https://www.mouser.com/datasheet/2/315/Panasonic_Resistors_Thick_Film_Anti_Sulf_Anti_Surg-1825099.pdf> ERJ PA2, P03, PA3, P06, P08, P14 Series <https://www.mouser.com/datasheet/2/315/AOA0000C331-1141874.pdf> B20 Series <https://www.ohmite.com/assets/docs/res_200.pdf?r=false> TE Connectivity/Holsworthy RN73 Series <https://www.mouser.com/datasheet/2/418/4/NG_DS_1773270_M-604713.pdf> Vishay Dale D/CRCW e3 <https://www.mouser.com/datasheet/2/427/dcrcwe3-1762152.pdf> Ohmite B20 <https://www.ohmite.com/assets/docs/res_200.pdf?r=false>; DKPN: P3.3AJTR-ND; MANUFACTURER: Panasonic Electronic Components; MOPN: 667-ERJ-3RQF3R3V; MPN: ERJ-3RQF3R3V; POWER: 0.1W; RESISTANCE: 3.3; TOLERANCE: 1%; VOLTAGE_CONTINUOUS: 0.57V; VOLTAGE_MAX: 75V
R15 = HyTechDevices:RESISTOR_?_*: Resistor PWR163 Series <https://www.mouser.com/datasheet/2/54/pwr163-777985.pdf> AC Series <https://www.mouser.com/datasheet/2/447/Yageo_PYu_AC_51_RoHS_L_7_1714230-1874691.pdf> PU Series <https://www.mouser.com/datasheet/2/447/PYu-PU_51_RoHS_L_6-1504619.pdf> UCR Series <https://fscdn.rohm.com/en/products/databook/datasheet/passive/resistor/chip_resistor/ucr-e.pdf> ERA Series <https://www.mouser.com/datasheet/2/315/AOA0000C307-1149632.pdf> PWR263 Series <https://www.mouser.com/datasheet/2/54/pwr263s_35-778069.pdf> KTR Series <https://www.mouser.com/datasheet/2/348/ROHM_S_A0011075115_1-2563276.pdf> RC Series <https://www.mouser.com/datasheet/2/447/Yageo_03_18_2021_PYu_RC_Group_51_RoHS_L_11-2199992.pdf> ERJ Low Resistance Series <https://www.mouser.com/datasheet/2/315/AOA0000C313-1141758.pdf> ERJ PB3, PB6 Series <https://www.mouser.com/datasheet/2/315/AOA0000C328-1530132.pdf> ERJ UP3, UP6, UP8 Series <https://www.mouser.com/datasheet/2/315/Panasonic_Resistors_Thick_Film_Anti_Sulf_Anti_Surg-1825099.pdf> ERJ PA2, P03, PA3, P06, P08, P14 Series <https://www.mouser.com/datasheet/2/315/AOA0000C331-1141874.pdf> B20 Series <https://www.ohmite.com/assets/docs/res_200.pdf?r=false> TE Connectivity/Holsworthy RN73 Series <https://www.mouser.com/datasheet/2/418/4/NG_DS_1773270_M-604713.pdf> Vishay Dale D/CRCW e3 <https://www.mouser.com/datasheet/2/427/dcrcwe3-1762152.pdf> Ohmite B20 <https://www.ohmite.com/assets/docs/res_200.pdf?r=false>; DKPN: 541-2.49KHTR-ND; MANUFACTURER: Vishay Dale; MOPN: 71-CRCW0603-2.49K-E3; MPN: CRCW06032K49FKEA; POWER: 0.1W; RESISTANCE: 2.49K; TOLERANCE: 1%; VOLTAGE_CONTINUOUS: 75V; VOLTAGE_MAX: 100V
R18 = HyTechDevices:RESISTOR_?_*: Resistor PWR163 Series <https://www.mouser.com/datasheet/2/54/pwr163-777985.pdf> AC Series <https://www.mouser.com/datasheet/2/447/Yageo_PYu_AC_51_RoHS_L_7_1714230-1874691.pdf> PU Series <https://www.mouser.com/datasheet/2/447/PYu-PU_51_RoHS_L_6-1504619.pdf> UCR Series <https://fscdn.rohm.com/en/products/databook/datasheet/passive/resistor/chip_resistor/ucr-e.pdf> ERA Series <https://www.mouser.com/datasheet/2/315/AOA0000C307-1149632.pdf> PWR263 Series <https://www.mouser.com/datasheet/2/54/pwr263s_35-778069.pdf> KTR Series <https://www.mouser.com/datasheet/2/348/ROHM_S_A0011075115_1-2563276.pdf> RC Series <https://www.mouser.com/datasheet/2/447/Yageo_03_18_2021_PYu_RC_Group_51_RoHS_L_11-2199992.pdf> ERJ Low Resistance Series <https://www.mouser.com/datasheet/2/315/AOA0000C313-1141758.pdf> ERJ PB3, PB6 Series <https://www.mouser.com/datasheet/2/315/AOA0000C328-1530132.pdf> ERJ UP3, UP6, UP8 Series <https://www.mouser.com/datasheet/2/315/Panasonic_Resistors_Thick_Film_Anti_Sulf_Anti_Surg-1825099.pdf> ERJ PA2, P03, PA3, P06, P08, P14 Series <https://www.mouser.com/datasheet/2/315/AOA0000C331-1141874.pdf> B20 Series <https://www.ohmite.com/assets/docs/res_200.pdf?r=false> TE Connectivity/Holsworthy RN73 Series <https://www.mouser.com/datasheet/2/418/4/NG_DS_1773270_M-604713.pdf> Vishay Dale D/CRCW e3 <https://www.mouser.com/datasheet/2/427/dcrcwe3-1762152.pdf> Ohmite B20 <https://www.ohmite.com/assets/docs/res_200.pdf?r=false>; DKPN: P21.5KHTR-ND; MANUFACTURER: Panasonic Electronic Components; MOPN: 667-ERJ-3EKF2152V; MPN: ERJ-3EKF2152V; POWER: 0.1W; RESISTANCE: 21.5K; TOLERANCE: 1%; VOLTAGE_CONTINUOUS: 75V; VOLTAGE_MAX: 150V
R24 = HyTechDevices:RESISTOR_?_*: Resistor PWR163 Series <https://www.mouser.com/datasheet/2/54/pwr163-777985.pdf> AC Series <https://www.mouser.com/datasheet/2/447/Yageo_PYu_AC_51_RoHS_L_7_1714230-1874691.pdf> PU Series <https://www.mouser.com/datasheet/2/447/PYu-PU_51_RoHS_L_6-1504619.pdf> UCR Series <https://fscdn.rohm.com/en/products/databook/datasheet/passive/resistor/chip_resistor/ucr-e.pdf> ERA Series <https://www.mouser.com/datasheet/2/315/AOA0000C307-1149632.pdf> PWR263 Series <https://www.mouser.com/datasheet/2/54/pwr263s_35-778069.pdf> KTR Series <https://www.mouser.com/datasheet/2/348/ROHM_S_A0011075115_1-2563276.pdf> RC Series <https://www.mouser.com/datasheet/2/447/Yageo_03_18_2021_PYu_RC_Group_51_RoHS_L_11-2199992.pdf> ERJ Low Resistance Series <https://www.mouser.com/datasheet/2/315/AOA0000C313-1141758.pdf> ERJ PB3, PB6 Series <https://www.mouser.com/datasheet/2/315/AOA0000C328-1530132.pdf> ERJ UP3, UP6, UP8 Series <https://www.mouser.com/datasheet/2/315/Panasonic_Resistors_Thick_Film_Anti_Sulf_Anti_Surg-1825099.pdf> ERJ PA2, P03, PA3, P06, P08, P14 Series <https://www.mouser.com/datasheet/2/315/AOA0000C331-1141874.pdf> B20 Series <https://www.ohmite.com/assets/docs/res_200.pdf?r=false> TE Connectivity/Holsworthy RN73 Series <https://www.mouser.com/datasheet/2/418/4/NG_DS_1773270_M-604713.pdf> Vishay Dale D/CRCW e3 <https://www.mouser.com/datasheet/2/427/dcrcwe3-1762152.pdf> Ohmite B20 <https://www.ohmite.com/assets/docs/res_200.pdf?r=false>; DKPN: 13-RT0603BRD0739RLTR-ND; MANUFACTURER: Yageo; MOPN: 603-RT0603BRD0739RL; MPN: RT0603BRD0739RL; POWER: 0.1W; RESISTANCE: 39; TOLERANCE: 1%; VOLTAGE_CONTINUOUS: 1.97V; VOLTAGE_MAX: 75V
R25 R27 R50 = HyTechDevices:RESISTOR_?_*: Resistor PWR163 Series <https://www.mouser.com/datasheet/2/54/pwr163-777985.pdf> AC Series <https://www.mouser.com/datasheet/2/447/Yageo_PYu_AC_51_RoHS_L_7_1714230-1874691.pdf> PU Series <https://www.mouser.com/datasheet/2/447/PYu-PU_51_RoHS_L_6-1504619.pdf> UCR Series <https://fscdn.rohm.com/en/products/databook/datasheet/passive/resistor/chip_resistor/ucr-e.pdf> ERA Series <https://www.mouser.com/datasheet/2/315/AOA0000C307-1149632.pdf> PWR263 Series <https://www.mouser.com/datasheet/2/54/pwr263s_35-778069.pdf> KTR Series <https://www.mouser.com/datasheet/2/348/ROHM_S_A0011075115_1-2563276.pdf> RC Series <https://www.mouser.com/datasheet/2/447/Yageo_03_18_2021_PYu_RC_Group_51_RoHS_L_11-2199992.pdf> ERJ Low Resistance Series <https://www.mouser.com/datasheet/2/315/AOA0000C313-1141758.pdf> ERJ PB3, PB6 Series <https://www.mouser.com/datasheet/2/315/AOA0000C328-1530132.pdf> ERJ UP3, UP6, UP8 Series <https://www.mouser.com/datasheet/2/315/Panasonic_Resistors_Thick_Film_Anti_Sulf_Anti_Surg-1825099.pdf> ERJ PA2, P03, PA3, P06, P08, P14 Series <https://www.mouser.com/datasheet/2/315/AOA0000C331-1141874.pdf> B20 Series <https://www.ohmite.com/assets/docs/res_200.pdf?r=false> TE Connectivity/Holsworthy RN73 Series <https://www.mouser.com/datasheet/2/418/4/NG_DS_1773270_M-604713.pdf> Vishay Dale D/CRCW e3 <https://www.mouser.com/datasheet/2/427/dcrcwe3-1762152.pdf> Ohmite B20 <https://www.ohmite.com/assets/docs/res_200.pdf?r=false>; DKPN: 10-ERJ-UP3F2001VTR-ND; MANUFACTURER: Panasonic Electronic Components; MOPN: 667-ERJ-UP3F2001V; MPN: ERJ-UP3F2001V; POWER: 0.25W; RESISTANCE: 2k; TOLERANCE: 1%; VOLTAGE_CONTINUOUS: 22.36V; VOLTAGE_MAX: 150V
R28 = HyTechDevices:RESISTOR_?_*: Resistor PWR163 Series <https://www.mouser.com/datasheet/2/54/pwr163-777985.pdf> AC Series <https://www.mouser.com/datasheet/2/447/Yageo_PYu_AC_51_RoHS_L_7_1714230-1874691.pdf> PU Series <https://www.mouser.com/datasheet/2/447/PYu-PU_51_RoHS_L_6-1504619.pdf> UCR Series <https://fscdn.rohm.com/en/products/databook/datasheet/passive/resistor/chip_resistor/ucr-e.pdf> ERA Series <https://www.mouser.com/datasheet/2/315/AOA0000C307-1149632.pdf> PWR263 Series <https://www.mouser.com/datasheet/2/54/pwr263s_35-778069.pdf> KTR Series <https://www.mouser.com/datasheet/2/348/ROHM_S_A0011075115_1-2563276.pdf> RC Series <https://www.mouser.com/datasheet/2/447/Yageo_03_18_2021_PYu_RC_Group_51_RoHS_L_11-2199992.pdf> ERJ Low Resistance Series <https://www.mouser.com/datasheet/2/315/AOA0000C313-1141758.pdf> ERJ PB3, PB6 Series <https://www.mouser.com/datasheet/2/315/AOA0000C328-1530132.pdf> ERJ UP3, UP6, UP8 Series <https://www.mouser.com/datasheet/2/315/Panasonic_Resistors_Thick_Film_Anti_Sulf_Anti_Surg-1825099.pdf> ERJ PA2, P03, PA3, P06, P08, P14 Series <https://www.mouser.com/datasheet/2/315/AOA0000C331-1141874.pdf> B20 Series <https://www.ohmite.com/assets/docs/res_200.pdf?r=false> TE Connectivity/Holsworthy RN73 Series <https://www.mouser.com/datasheet/2/418/4/NG_DS_1773270_M-604713.pdf> Vishay Dale D/CRCW e3 <https://www.mouser.com/datasheet/2/427/dcrcwe3-1762152.pdf> Ohmite B20 <https://www.ohmite.com/assets/docs/res_200.pdf?r=false>; DKPN: P10KBDCT-ND; MANUFACTURER: Panasonic Electronic Components; MOPN: 667-ERA-3ARB103V; MPN: ERA-3ARB103V; POWER: 0.1W; RESISTANCE: 10k; TOLERANCE: 0.1%; VOLTAGE_CONTINUOUS: 31.62V; VOLTAGE_MAX: 75V
R33 = HyTechDevices:RESISTOR_?_*: Resistor PWR163 Series <https://www.mouser.com/datasheet/2/54/pwr163-777985.pdf> AC Series <https://www.mouser.com/datasheet/2/447/Yageo_PYu_AC_51_RoHS_L_7_1714230-1874691.pdf> PU Series <https://www.mouser.com/datasheet/2/447/PYu-PU_51_RoHS_L_6-1504619.pdf> UCR Series <https://fscdn.rohm.com/en/products/databook/datasheet/passive/resistor/chip_resistor/ucr-e.pdf> ERA Series <https://www.mouser.com/datasheet/2/315/AOA0000C307-1149632.pdf> PWR263 Series <https://www.mouser.com/datasheet/2/54/pwr263s_35-778069.pdf> KTR Series <https://www.mouser.com/datasheet/2/348/ROHM_S_A0011075115_1-2563276.pdf> RC Series <https://www.mouser.com/datasheet/2/447/Yageo_03_18_2021_PYu_RC_Group_51_RoHS_L_11-2199992.pdf> ERJ Low Resistance Series <https://www.mouser.com/datasheet/2/315/AOA0000C313-1141758.pdf> ERJ PB3, PB6 Series <https://www.mouser.com/datasheet/2/315/AOA0000C328-1530132.pdf> ERJ UP3, UP6, UP8 Series <https://www.mouser.com/datasheet/2/315/Panasonic_Resistors_Thick_Film_Anti_Sulf_Anti_Surg-1825099.pdf> ERJ PA2, P03, PA3, P06, P08, P14 Series <https://www.mouser.com/datasheet/2/315/AOA0000C331-1141874.pdf> B20 Series <https://www.ohmite.com/assets/docs/res_200.pdf?r=false> TE Connectivity/Holsworthy RN73 Series <https://www.mouser.com/datasheet/2/418/4/NG_DS_1773270_M-604713.pdf> Vishay Dale D/CRCW e3 <https://www.mouser.com/datasheet/2/427/dcrcwe3-1762152.pdf> Ohmite B20 <https://www.ohmite.com/assets/docs/res_200.pdf?r=false>; DKPN: 311-10.0HRCT-ND; MANUFACTURER: Yageo; MOPN: 603-RC0603FR-0710RL; MPN: RC0603FR-0710RL; POWER: 0.1W; RESISTANCE: 10; TOLERANCE: 1%; VOLTAGE_CONTINUOUS: 1.00V; VOLTAGE_MAX: 75V
R34 = HyTechDevices:RESISTOR_?_*: Resistor PWR163 Series <https://www.mouser.com/datasheet/2/54/pwr163-777985.pdf> AC Series <https://www.mouser.com/datasheet/2/447/Yageo_PYu_AC_51_RoHS_L_7_1714230-1874691.pdf> PU Series <https://www.mouser.com/datasheet/2/447/PYu-PU_51_RoHS_L_6-1504619.pdf> UCR Series <https://fscdn.rohm.com/en/products/databook/datasheet/passive/resistor/chip_resistor/ucr-e.pdf> ERA Series <https://www.mouser.com/datasheet/2/315/AOA0000C307-1149632.pdf> PWR263 Series <https://www.mouser.com/datasheet/2/54/pwr263s_35-778069.pdf> KTR Series <https://www.mouser.com/datasheet/2/348/ROHM_S_A0011075115_1-2563276.pdf> RC Series <https://www.mouser.com/datasheet/2/447/Yageo_03_18_2021_PYu_RC_Group_51_RoHS_L_11-2199992.pdf> ERJ Low Resistance Series <https://www.mouser.com/datasheet/2/315/AOA0000C313-1141758.pdf> ERJ PB3, PB6 Series <https://www.mouser.com/datasheet/2/315/AOA0000C328-1530132.pdf> ERJ UP3, UP6, UP8 Series <https://www.mouser.com/datasheet/2/315/Panasonic_Resistors_Thick_Film_Anti_Sulf_Anti_Surg-1825099.pdf> ERJ PA2, P03, PA3, P06, P08, P14 Series <https://www.mouser.com/datasheet/2/315/AOA0000C331-1141874.pdf> B20 Series <https://www.ohmite.com/assets/docs/res_200.pdf?r=false> TE Connectivity/Holsworthy RN73 Series <https://www.mouser.com/datasheet/2/418/4/NG_DS_1773270_M-604713.pdf> Vishay Dale D/CRCW e3 <https://www.mouser.com/datasheet/2/427/dcrcwe3-1762152.pdf> Ohmite B20 <https://www.ohmite.com/assets/docs/res_200.pdf?r=false>; DKPN: P20936TR-ND; MANUFACTURER: Panasonic Electronic Components; MOPN: 667-ERJ-PB6B1004V; MPN: ERJ-PB6B1004V; POWER: 0.25W; RESISTANCE: 1M; TOLERANCE: 0.1%; VOLTAGE_CONTINUOUS: 150V; VOLTAGE_MAX: 150V
R40 = HyTechDevices:RESISTOR_?_*: Resistor PWR163 Series <https://www.mouser.com/datasheet/2/54/pwr163-777985.pdf> AC Series <https://www.mouser.com/datasheet/2/447/Yageo_PYu_AC_51_RoHS_L_7_1714230-1874691.pdf> PU Series <https://www.mouser.com/datasheet/2/447/PYu-PU_51_RoHS_L_6-1504619.pdf> UCR Series <https://fscdn.rohm.com/en/products/databook/datasheet/passive/resistor/chip_resistor/ucr-e.pdf> ERA Series <https://www.mouser.com/datasheet/2/315/AOA0000C307-1149632.pdf> PWR263 Series <https://www.mouser.com/datasheet/2/54/pwr263s_35-778069.pdf> KTR Series <https://www.mouser.com/datasheet/2/348/ROHM_S_A0011075115_1-2563276.pdf> RC Series <https://www.mouser.com/datasheet/2/447/Yageo_03_18_2021_PYu_RC_Group_51_RoHS_L_11-2199992.pdf> ERJ Low Resistance Series <https://www.mouser.com/datasheet/2/315/AOA0000C313-1141758.pdf> ERJ PB3, PB6 Series <https://www.mouser.com/datasheet/2/315/AOA0000C328-1530132.pdf> ERJ UP3, UP6, UP8 Series <https://www.mouser.com/datasheet/2/315/Panasonic_Resistors_Thick_Film_Anti_Sulf_Anti_Surg-1825099.pdf> ERJ PA2, P03, PA3, P06, P08, P14 Series <https://www.mouser.com/datasheet/2/315/AOA0000C331-1141874.pdf> B20 Series <https://www.ohmite.com/assets/docs/res_200.pdf?r=false> TE Connectivity/Holsworthy RN73 Series <https://www.mouser.com/datasheet/2/418/4/NG_DS_1773270_M-604713.pdf> Vishay Dale D/CRCW e3 <https://www.mouser.com/datasheet/2/427/dcrcwe3-1762152.pdf> Ohmite B20 <https://www.ohmite.com/assets/docs/res_200.pdf?r=false>; DKPN: P22.1KDBCT-ND; MANUFACTURER: Panasonic Electronic Components; MOPN: 667-ERA-3AEB2212V; MPN: ERA-3AEB2212V; POWER: 0.1W; RESISTANCE: 22.1k; TOLERANCE: 0.1%; VOLTAGE_CONTINUOUS: 47.01V; VOLTAGE_MAX: 75V
R51 = HyTechDevices:RESISTOR_?_*: Resistor PWR163 Series <https://www.mouser.com/datasheet/2/54/pwr163-777985.pdf> AC Series <https://www.mouser.com/datasheet/2/447/Yageo_PYu_AC_51_RoHS_L_7_1714230-1874691.pdf> PU Series <https://www.mouser.com/datasheet/2/447/PYu-PU_51_RoHS_L_6-1504619.pdf> UCR Series <https://fscdn.rohm.com/en/products/databook/datasheet/passive/resistor/chip_resistor/ucr-e.pdf> ERA Series <https://www.mouser.com/datasheet/2/315/AOA0000C307-1149632.pdf> PWR263 Series <https://www.mouser.com/datasheet/2/54/pwr263s_35-778069.pdf> KTR Series <https://www.mouser.com/datasheet/2/348/ROHM_S_A0011075115_1-2563276.pdf> RC Series <https://www.mouser.com/datasheet/2/447/Yageo_03_18_2021_PYu_RC_Group_51_RoHS_L_11-2199992.pdf> ERJ Low Resistance Series <https://www.mouser.com/datasheet/2/315/AOA0000C313-1141758.pdf> ERJ PB3, PB6 Series <https://www.mouser.com/datasheet/2/315/AOA0000C328-1530132.pdf> ERJ UP3, UP6, UP8 Series <https://www.mouser.com/datasheet/2/315/Panasonic_Resistors_Thick_Film_Anti_Sulf_Anti_Surg-1825099.pdf> ERJ PA2, P03, PA3, P06, P08, P14 Series <https://www.mouser.com/datasheet/2/315/AOA0000C331-1141874.pdf> B20 Series <https://www.ohmite.com/assets/docs/res_200.pdf?r=false> TE Connectivity/Holsworthy RN73 Series <https://www.mouser.com/datasheet/2/418/4/NG_DS_1773270_M-604713.pdf> Vishay Dale D/CRCW e3 <https://www.mouser.com/datasheet/2/427/dcrcwe3-1762152.pdf> Ohmite B20 <https://www.ohmite.com/assets/docs/res_200.pdf?r=false>; DKPN: RHM1241CT-ND; MANUFACTURER: Rohm Semiconductor; MOPN: 755-UCR03EVPFLR120; MPN: UCR03EVPFLR120; POWER: 0.25W; RESISTANCE: 0.12; TOLERANCE: 1%; VOLTAGE_CONTINUOUS: 0.173V
R52 R53 R57 R58 = HyTechDevices:RESISTOR_?_*: Resistor PWR163 Series <https://www.mouser.com/datasheet/2/54/pwr163-777985.pdf> AC Series <https://www.mouser.com/datasheet/2/447/Yageo_PYu_AC_51_RoHS_L_7_1714230-1874691.pdf> PU Series <https://www.mouser.com/datasheet/2/447/PYu-PU_51_RoHS_L_6-1504619.pdf> UCR Series <https://fscdn.rohm.com/en/products/databook/datasheet/passive/resistor/chip_resistor/ucr-e.pdf> ERA Series <https://www.mouser.com/datasheet/2/315/AOA0000C307-1149632.pdf> PWR263 Series <https://www.mouser.com/datasheet/2/54/pwr263s_35-778069.pdf> KTR Series <https://www.mouser.com/datasheet/2/348/ROHM_S_A0011075115_1-2563276.pdf> RC Series <https://www.mouser.com/datasheet/2/447/Yageo_03_18_2021_PYu_RC_Group_51_RoHS_L_11-2199992.pdf> ERJ Low Resistance Series <https://www.mouser.com/datasheet/2/315/AOA0000C313-1141758.pdf> ERJ PB3, PB6 Series <https://www.mouser.com/datasheet/2/315/AOA0000C328-1530132.pdf> ERJ UP3, UP6, UP8 Series <https://www.mouser.com/datasheet/2/315/Panasonic_Resistors_Thick_Film_Anti_Sulf_Anti_Surg-1825099.pdf> ERJ PA2, P03, PA3, P06, P08, P14 Series <https://www.mouser.com/datasheet/2/315/AOA0000C331-1141874.pdf> B20 Series <https://www.ohmite.com/assets/docs/res_200.pdf?r=false> TE Connectivity/Holsworthy RN73 Series <https://www.mouser.com/datasheet/2/418/4/NG_DS_1773270_M-604713.pdf> Vishay Dale D/CRCW e3 <https://www.mouser.com/datasheet/2/427/dcrcwe3-1762152.pdf> Ohmite B20 <https://www.ohmite.com/assets/docs/res_200.pdf?r=false>; DKPN: RHM365KAHTR-ND; MANUFACTURER: Rohm; MOPN: 755-KTR10EZPF3653; MPN: KTR10EZPF3653; POWER: 0.125W; RESISTANCE: 365k; TOLERANCE: 1%; VOLTAGE_CONTINUOUS: 213V; VOLTAGE_MAX: 350V
R54 R59 = HyTechDevices:RESISTOR_?_*: Resistor PWR163 Series <https://www.mouser.com/datasheet/2/54/pwr163-777985.pdf> AC Series <https://www.mouser.com/datasheet/2/447/Yageo_PYu_AC_51_RoHS_L_7_1714230-1874691.pdf> PU Series <https://www.mouser.com/datasheet/2/447/PYu-PU_51_RoHS_L_6-1504619.pdf> UCR Series <https://fscdn.rohm.com/en/products/databook/datasheet/passive/resistor/chip_resistor/ucr-e.pdf> ERA Series <https://www.mouser.com/datasheet/2/315/AOA0000C307-1149632.pdf> PWR263 Series <https://www.mouser.com/datasheet/2/54/pwr263s_35-778069.pdf> KTR Series <https://www.mouser.com/datasheet/2/348/ROHM_S_A0011075115_1-2563276.pdf> RC Series <https://www.mouser.com/datasheet/2/447/Yageo_03_18_2021_PYu_RC_Group_51_RoHS_L_11-2199992.pdf> ERJ Low Resistance Series <https://www.mouser.com/datasheet/2/315/AOA0000C313-1141758.pdf> ERJ PB3, PB6 Series <https://www.mouser.com/datasheet/2/315/AOA0000C328-1530132.pdf> ERJ UP3, UP6, UP8 Series <https://www.mouser.com/datasheet/2/315/Panasonic_Resistors_Thick_Film_Anti_Sulf_Anti_Surg-1825099.pdf> ERJ PA2, P03, PA3, P06, P08, P14 Series <https://www.mouser.com/datasheet/2/315/AOA0000C331-1141874.pdf> B20 Series <https://www.ohmite.com/assets/docs/res_200.pdf?r=false> TE Connectivity/Holsworthy RN73 Series <https://www.mouser.com/datasheet/2/418/4/NG_DS_1773270_M-604713.pdf> Vishay Dale D/CRCW e3 <https://www.mouser.com/datasheet/2/427/dcrcwe3-1762152.pdf> Ohmite B20 <https://www.ohmite.com/assets/docs/res_200.pdf?r=false>; DKPN: RHM1.00MAHTR-ND; MANUFACTURER: Rohm Semiconductor; MOPN: 755-KTR10EZPF1004; MPN: KTR10EZPF1004; POWER: 0.125W; RESISTANCE: 1M; TOLERANCE: 1%; VOLTAGE_CONTINUOUS: 353.5V; VOLTAGE_MAX: 400V
R55 R60 = HyTechDevices:RESISTOR_?_*: Resistor PWR163 Series <https://www.mouser.com/datasheet/2/54/pwr163-777985.pdf> AC Series <https://www.mouser.com/datasheet/2/447/Yageo_PYu_AC_51_RoHS_L_7_1714230-1874691.pdf> PU Series <https://www.mouser.com/datasheet/2/447/PYu-PU_51_RoHS_L_6-1504619.pdf> UCR Series <https://fscdn.rohm.com/en/products/databook/datasheet/passive/resistor/chip_resistor/ucr-e.pdf> ERA Series <https://www.mouser.com/datasheet/2/315/AOA0000C307-1149632.pdf> PWR263 Series <https://www.mouser.com/datasheet/2/54/pwr263s_35-778069.pdf> KTR Series <https://www.mouser.com/datasheet/2/348/ROHM_S_A0011075115_1-2563276.pdf> RC Series <https://www.mouser.com/datasheet/2/447/Yageo_03_18_2021_PYu_RC_Group_51_RoHS_L_11-2199992.pdf> ERJ Low Resistance Series <https://www.mouser.com/datasheet/2/315/AOA0000C313-1141758.pdf> ERJ PB3, PB6 Series <https://www.mouser.com/datasheet/2/315/AOA0000C328-1530132.pdf> ERJ UP3, UP6, UP8 Series <https://www.mouser.com/datasheet/2/315/Panasonic_Resistors_Thick_Film_Anti_Sulf_Anti_Surg-1825099.pdf> ERJ PA2, P03, PA3, P06, P08, P14 Series <https://www.mouser.com/datasheet/2/315/AOA0000C331-1141874.pdf> B20 Series <https://www.ohmite.com/assets/docs/res_200.pdf?r=false> TE Connectivity/Holsworthy RN73 Series <https://www.mouser.com/datasheet/2/418/4/NG_DS_1773270_M-604713.pdf> Vishay Dale D/CRCW e3 <https://www.mouser.com/datasheet/2/427/dcrcwe3-1762152.pdf> Ohmite B20 <https://www.ohmite.com/assets/docs/res_200.pdf?r=false>; DKPN: RHM3.3KAYTR-ND; MANUFACTURER: Rohm; MOPN: 755-KTR03EZPF3301; MPN: KTR03EZPF3301; POWER: 0.1W; RESISTANCE: 3.3k; TOLERANCE: 1%; VOLTAGE_CONTINUOUS: 18.17V; VOLTAGE_MAX: 350V
R56 R61 = HyTechDevices:RESISTOR_?_*: Resistor PWR163 Series <https://www.mouser.com/datasheet/2/54/pwr163-777985.pdf> AC Series <https://www.mouser.com/datasheet/2/447/Yageo_PYu_AC_51_RoHS_L_7_1714230-1874691.pdf> PU Series <https://www.mouser.com/datasheet/2/447/PYu-PU_51_RoHS_L_6-1504619.pdf> UCR Series <https://fscdn.rohm.com/en/products/databook/datasheet/passive/resistor/chip_resistor/ucr-e.pdf> ERA Series <https://www.mouser.com/datasheet/2/315/AOA0000C307-1149632.pdf> PWR263 Series <https://www.mouser.com/datasheet/2/54/pwr263s_35-778069.pdf> KTR Series <https://www.mouser.com/datasheet/2/348/ROHM_S_A0011075115_1-2563276.pdf> RC Series <https://www.mouser.com/datasheet/2/447/Yageo_03_18_2021_PYu_RC_Group_51_RoHS_L_11-2199992.pdf> ERJ Low Resistance Series <https://www.mouser.com/datasheet/2/315/AOA0000C313-1141758.pdf> ERJ PB3, PB6 Series <https://www.mouser.com/datasheet/2/315/AOA0000C328-1530132.pdf> ERJ UP3, UP6, UP8 Series <https://www.mouser.com/datasheet/2/315/Panasonic_Resistors_Thick_Film_Anti_Sulf_Anti_Surg-1825099.pdf> ERJ PA2, P03, PA3, P06, P08, P14 Series <https://www.mouser.com/datasheet/2/315/AOA0000C331-1141874.pdf> B20 Series <https://www.ohmite.com/assets/docs/res_200.pdf?r=false> TE Connectivity/Holsworthy RN73 Series <https://www.mouser.com/datasheet/2/418/4/NG_DS_1773270_M-604713.pdf> Vishay Dale D/CRCW e3 <https://www.mouser.com/datasheet/2/427/dcrcwe3-1762152.pdf> Ohmite B20 <https://www.ohmite.com/assets/docs/res_200.pdf?r=false>; DKPN: RHM4.99KAICT-ND; MANUFACTURER: Rohm Semiconductor; MOPN: 755-KTR18EZPF4991; MPN: KTR18EZPF4991; POWER: 0.25W; RESISTANCE: 4.99k; TOLERANCE: 1%; VOLTAGE_CONTINUOUS: 35.32V; VOLTAGE_MAX: 500V
TS+ = HyTechDevices:CONNECTOR-6_?_*: 6 Pin Connector
TS- = HyTechDevices:CONNECTOR-5_?_*; MANUFACTURER: Molex; MPN: 43650-0617
U1 = HyTechDevices:OPAMP_1_CHANNEL_*: Op-Amp 1 Channel OPA991 Datasheet <https://www.ti.com/lit/ds/symlink/opa991.pdf?ts=1615503614502> Note: OPA991 is also a comparator; DKPN: 296-OPA991IDCKRCT-ND; MANUFACTURER: Texas Instruments; MOPN: 595-OPA991IDCKR; MPN: OPA991IDCKR
U2 = HyTechDevices:LT8316: LT8316 560VIN Micropower No-Opto Isolated Flyback Controller Datasheet <https://www.mouser.com/datasheet/2/609/LT8316-1545981.pdf>; DKPN: 505-LT8316EFE#PBF-ND; MANUFACTURER: Analog Devices; MOPN: 584-LT8316EFE#PBF; MPN: LT8316EFE#PBF
U5 = HyTechDevices:RELAY_SOLIDSTATE_NO_*: AQY214EHA Normally Open Solid State Relay Datasheet <https://www.datasheetq.com/datasheet-download/287654/1/Panasonic/AQY214EH> Crydom CMX Series Solid State Normally Open Relay Datasheet <https://www.mouser.com/datasheet/2/657/cmx_series_dc_pcb_mount-1370813.pdf> AB38S-Q Datasheet <https://comus-intl.com/wp-content/uploads/2016/09/AB38S-Q.pdf> CPC1020NTR Datasheet <https://www.mouser.com/datasheet/2/240/CPC1020N-1546163.pdf>; DKPN: 1835-1216-ND; MANUFACTURER: Comus International; MPN: AB38S-Q; VOLTAGE: 600V
U7 U8 = HyTechDevices:AMC3330*: AMC3330 ±1-V input, precision voltage sensing reinforced isolated amplifier with integrated DC/DC Datasheet <https://www.ti.com/lit/gpn/amc3330>; DKPN: 296-AMC3330DWERCT-ND; MANUFACTURER: Texas Instruments; MOPN: 595-AMC3330DWER; MPN: AMC3330DWER
U10 = HyTechDevices:LTC6994-*: Analog Devices Inc Delay IC 1us to 33.6s Datasheet <https://www.mouser.com/datasheet/2/609/LTC6994_1_6994_2-1270043.pdf>; DKPN: 505-LTC6994CS6-2#TRMPBFCT-ND; MANUFACTURER: Analog Devices Inc; MOPN: 584-C6994HS6-2TRMPBF; MPN: LTC6994HS6-2#TRMPBF

## Board
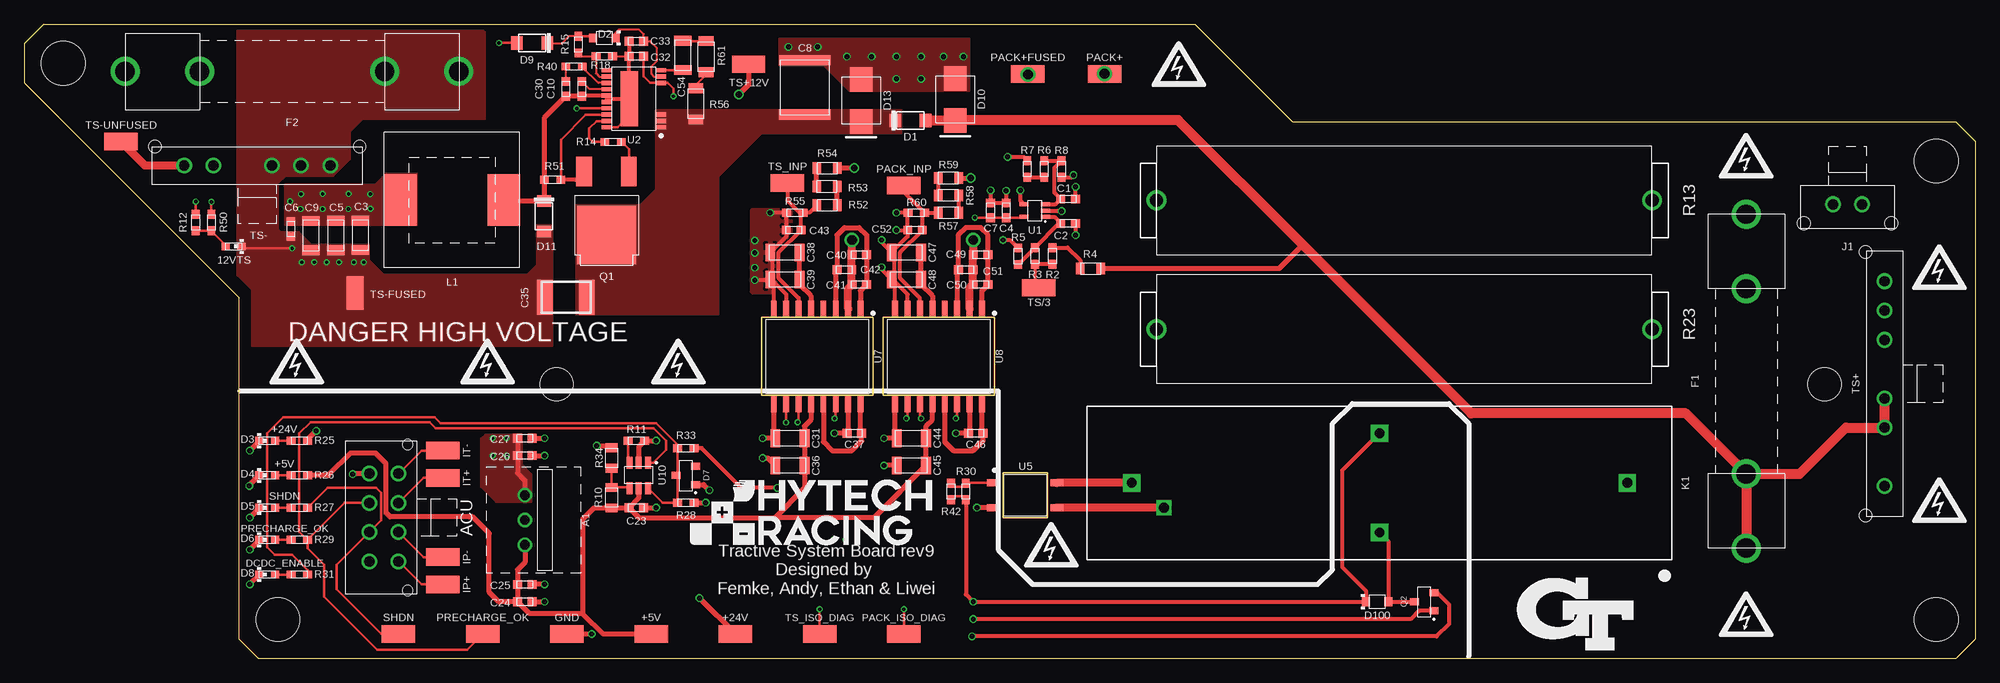
[diagram p3: board, top side]
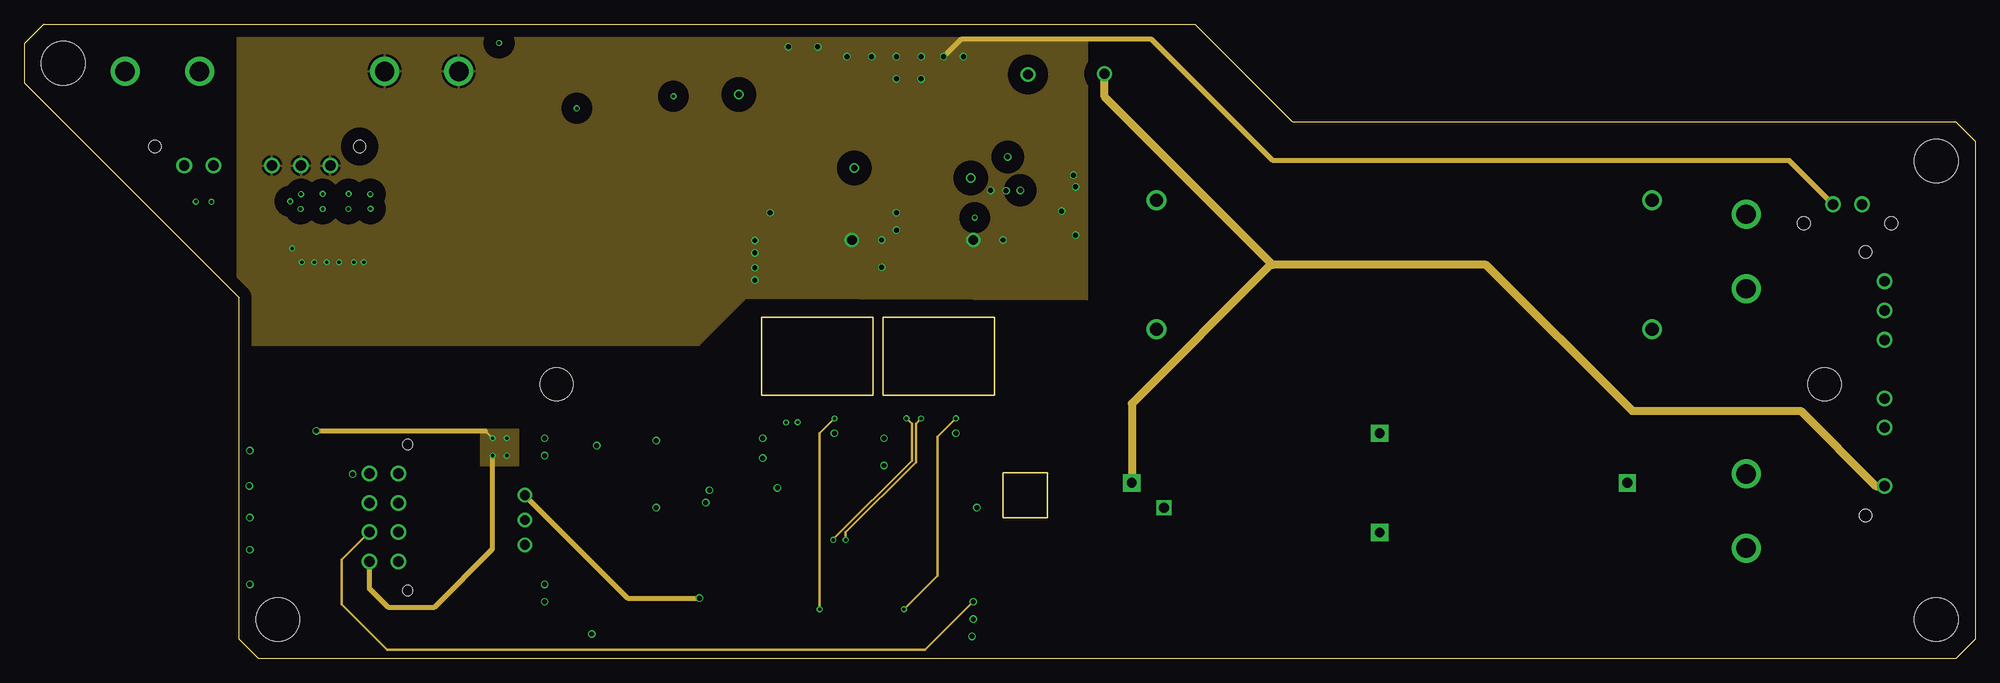
[diagram p4: board, inner layer Route2]
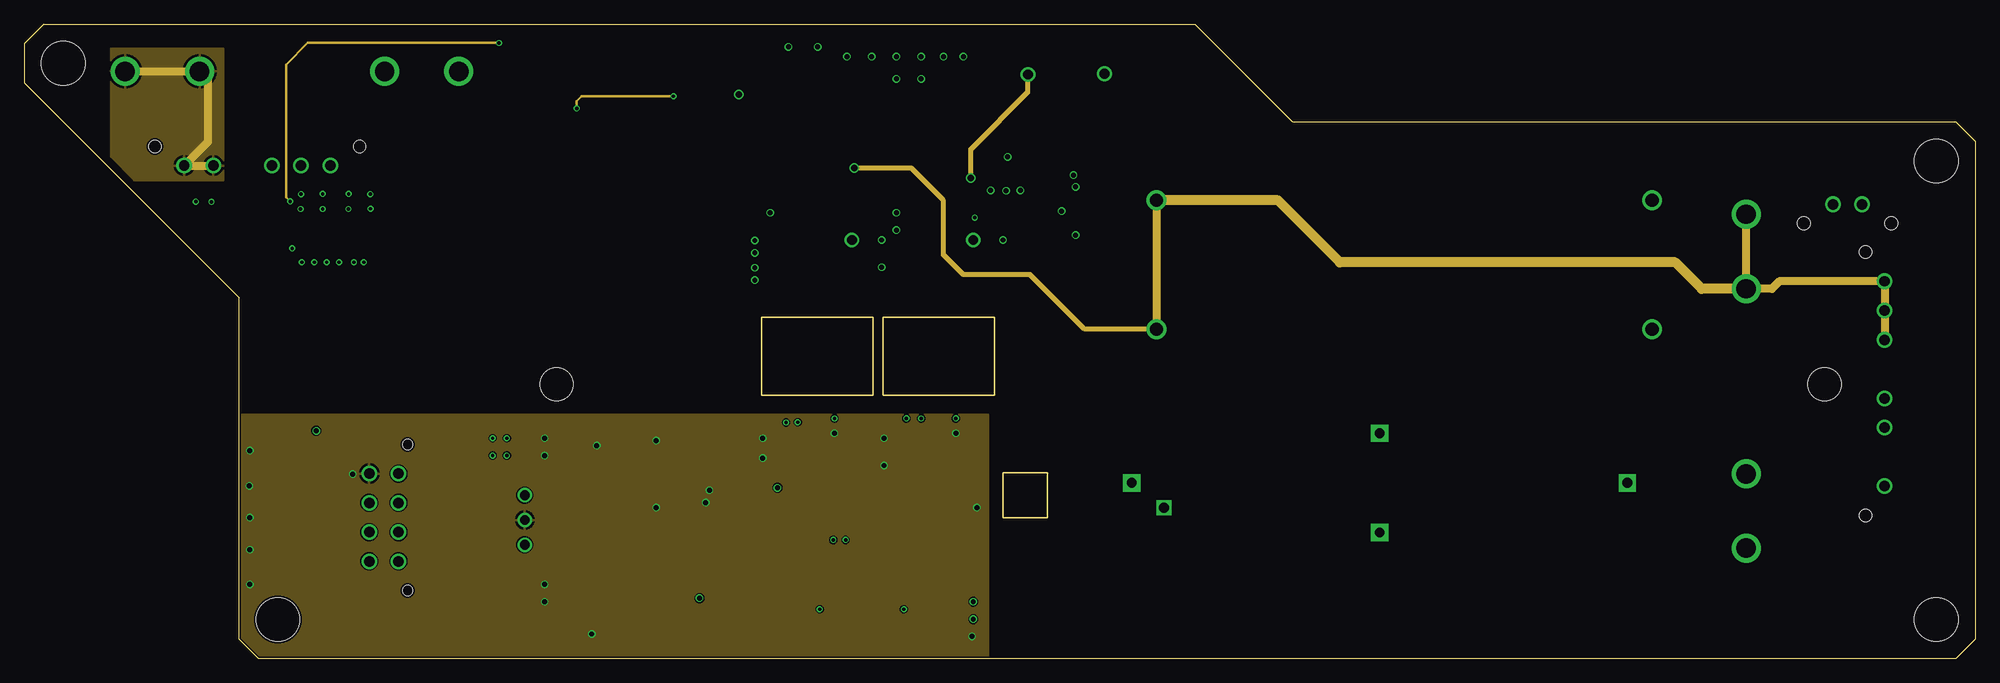
[diagram p5: board, inner layer Route15]
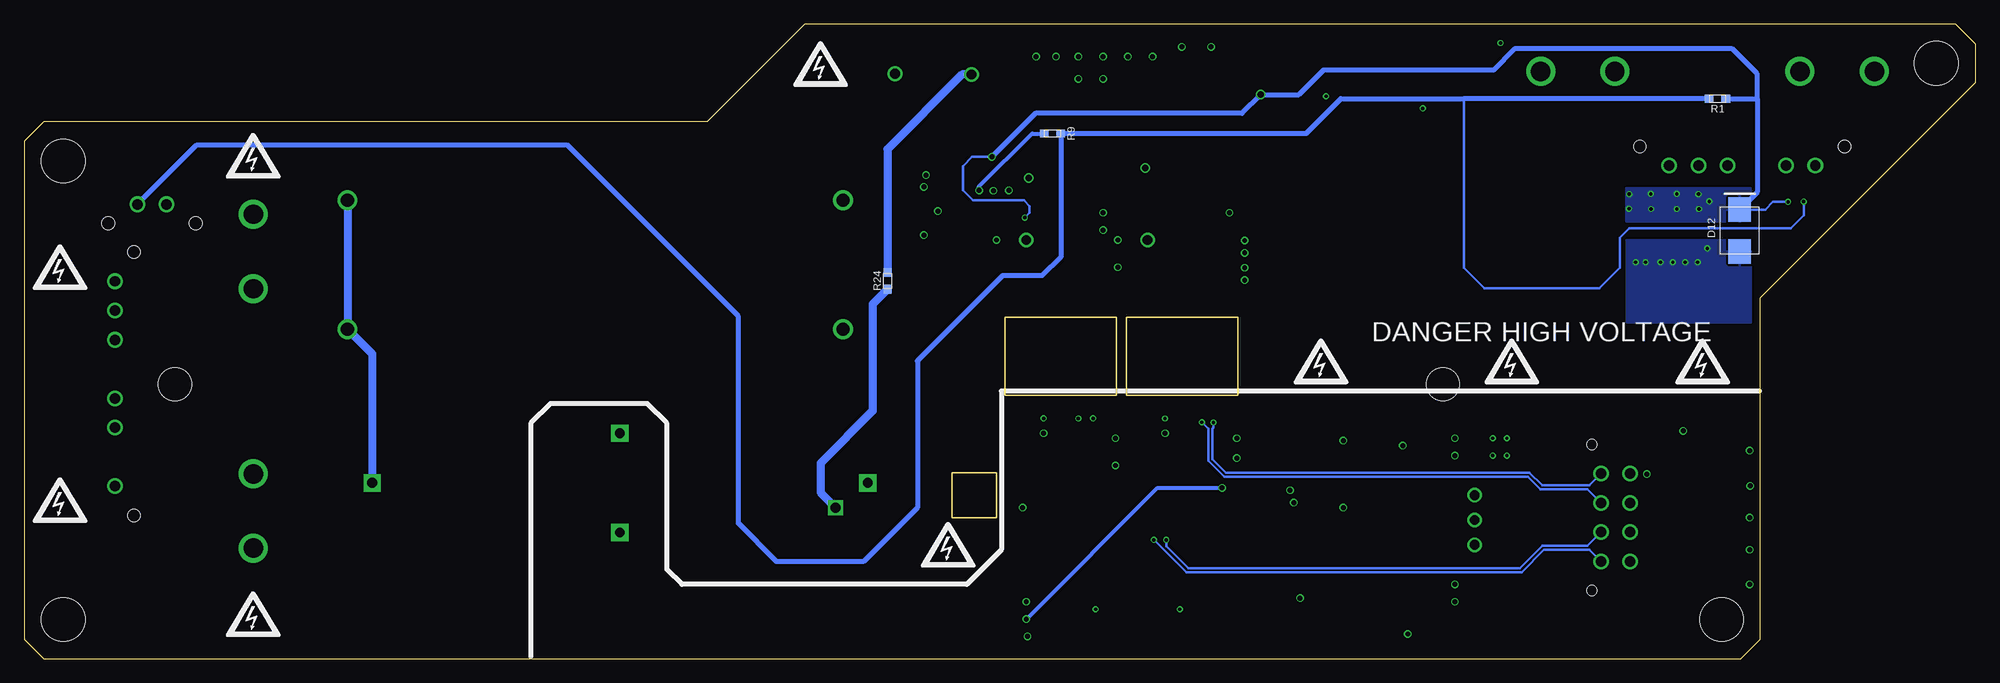
[diagram p6: board, bottom side, seen from below]

Size 200 x 65 mm. Coordinates in mm from the lower left corner, seen from the top.
Outline: 2,65 120,65 130,55 198,55 200,53 200,2 198,0 24,0 22,2 22,37 0,59 0,63 2,65
Copper layers (1+2*15+16): Top 0.035mm / dielectric 0.2mm / Route2 0.0175mm / dielectric 1.065mm / Route15 0.0175mm / dielectric 0.2mm / Bottom 0.035mm
Design rules "JLCPCB (4 Layer)": minimum track width 5mil, minimum drill 0.2mm, track to track 5mil, track to pad 5mil, pad to pad 5mil, via to via 20mil, smd to smd 5mil, copper to edge 0.2mm, drill to drill 21mil, minimum pad ring 6mil, minimum via ring 5mil, stop-mask expansion 2mil, vias tented up to drill 30mil, thermal gap 10mil

### Footprints (pad centres in the part's own frame; a part is rotated, then mirrored left to right if it is on the bottom)
0603-LED = smd 0.8 x 0.8: 1 -0.825,0; 2 0.825,0
5015 = smd 3.429 x 1.778: 1 0,0
OKI-78SR = drill 0.991: 1 -2.54,0; 2 0,0; 3 2.54,0
MOLEX_MICROFIT_PTH_VERTICAL_08_DUAL = drill 1.067: 1 4.496,-2.997; 2 1.499,-2.997; 3 -1.499,-2.997; 4 -4.496,-2.997; 5 4.496,0; 6 1.499,0; 7 -1.499,0; 8 -4.496,0 | hole 1.067: 7.493,0.94; -7.493,0.94
0603-CAP = smd 0.9 x 0.9: 1 -0.75,0; 2 0.75,0
1206-CAP = smd 1 x 1.8: 1 -1.5,0; 2 1.5,0
2220-CAP = smd 1.05 x 5.3: 1 -2.775,0; 2 2.775,0
1812-CAP = smd 1.6 x 3.6: 1 -2.15,0; 2 2.15,0
SOD-123W = smd 1.2 x 1.4: A -1.55,0; C 1.55,0
SOD-323 = smd 0.8 x 0.9: A -1.15,0; C 1.15,0
SOT-23 = smd 0.711 x 0.889: 1 -0.94,-1.003; 2 0.94,-1.003; 3 0,1.003
SMB(DO-214AA) = smd 2.5 x 2.3: A -2.15,0; C 2.15,0
122 = drill 1.981: 1 -17.107,0; 2 -9.474,0; 3 9.5,0; 4 17.107,0
MOLEX_MICROFIT_PTH_VERTICAL_02_SINGLE = drill 1.067: 1 1.499,0; 2 -1.499,0 | hole 1.321: 4.496,-1.956; -4.496,-1.956
D = drill 1 pad 1.778 square: 1 -25.4,0; 2 25.4,0; 3 0,5.08; 4 0,-5.08
CDEEH13D90 = smd 3.35 x 5.3: 1 -5.325,0; 2 5.325,0
DPAK(2-7K1S) = smd 1.6 x 3: 1 -2.3,-3.5; 3 2.3,-3.5 | smd 6 x 6: 2 0,3
0603-RES = smd 0.9 x 0.8: 1 -0.85,0; 2 0.85,0
0805-RES = smd 0.9 x 1.2: 1 -1.05,0; 2 1.05,0
B20-SHORTENED = drill 1.35: 1 25.4,0; 2 -25.4,0
1206-RES = smd 1 x 1.5: 1 -1.6,0; 2 1.6,0
MOLEX_MICROFIT_PTH_VERTICAL_08_SINGLE_SPACED_MODIFIED = drill 1.067: 1 -10.5,0; 2 -7.5,0; 3 -4.5,0; 4 1.5,0; 5 4.5,0; 6 10.5,0 | hole 1.27: 13.5,-1.96; -13.5,-1.96
MOLEX_MICROFIT_PTH_VERTICAL_06_SINGLE_SPACED = drill 1.067: 1 -7.493,0; 2 -4.496,0; 3 -1.499,0; 4 4.496,0; 5 7.493,0 | hole 1.27: 10.503,-1.956; -10.503,-1.956
SC-70-5 = smd 0.4 x 0.9: 1 -0.65,-1.1; 2 0,-1.1; 3 0.65,-1.1; 4 0.65,1.1; 5 -0.65,1.1
TSSOP-20(16) = smd 0.45 x 1.05: 1 -2.925,-2.775; 2 -2.275,-2.775; 3 -1.625,-2.775; 8 1.625,-2.775; 9 2.275,-2.775; 10 2.925,-2.775; 11 2.925,2.775; 12 2.275,2.775; 13 1.625,2.775; 14 0.975,2.775; 15 0.325,2.775; 16 -0.325,2.775; 17 -0.975,2.775; 18 -1.625,2.775; 19 -2.275,2.775; 20 -2.925,2.775 | smd 5.68 x 1.78: THERMAL 0,0.47
SOP-04-AIRGAP = smd 0.7 x 1.3: 1 -1.27,-3.25; 2 1.27,-3.25; 3 1.27,3.25; 4 -1.27,3.25
SOIC-16W-AIRGAP = smd 0.6 x 1.65: 1 -4.445,-4.875; 2 -3.175,-4.875; 3 -1.905,-4.875; 4 -0.635,-4.875; 5 0.635,-4.875; 6 1.905,-4.875; 7 3.175,-4.875; 8 4.445,-4.875; 9 4.445,4.875; 10 3.175,4.875; 11 1.905,4.875; 12 0.635,4.875; 13 -0.635,4.875; 14 -1.905,4.875; 15 -3.175,4.875; 16 -4.445,4.875
SOT-23-6 = smd 0.62 x 1.22: 1 -0.95,-1.31; 2 0,-1.31; 3 0.95,-1.31; 4 -0.95,1.31; 5 0,1.31; 6 0.95,1.31
MOUNTING_M4 = hole 4.5: 0,0
MOUNTING_M3 = hole 3.4: 0,0

### Placement (x,y rotation side)
12VTS  21.46,42.24 180 top
$$U$1  [HV_MEDIUM]  67.06,30.46 0 top
$$U$4  [HV_MEDIUM]  118.36,60.94 0 top
$$U$6  [HV_MEDIUM]  196.34,40.11 0 top
$$U$8  [HV_MEDIUM]  27.94,30.46 0 top
$$U$104  [HV_MEDIUM]  27.94,30.46 0 bottom
$$U$105  [HV_MEDIUM]  196.34,40.11 0 bottom
$$U$106  [HV_MEDIUM]  118.36,60.94 0 bottom
$$U$107  [HV_MEDIUM]  67.06,30.46 0 bottom
+5V  64.26,2.52 0 top
+24V  72.9,2.52 0 top
A1  51.31,14.2 270 top
ACU  38.35,14.45 270 top
C1  107.01,47.1 0 top
C2  107.01,44.6 0 top
C3  34.44,43.38 270 top
C4  100.66,45.94 90 top
C5  31.92,43.36 270 top
C6  27.33,44.05 270 top
C7  99.07,45.94 90 top
C8  80.02,58.54 90 top
C9  29.38,43.36 270 top
C10  57.15,58.4 270 top
C23  62.74,15.47 0 top
C24  51.31,5.82 0 top
C25  51.31,7.6 0 top
C26  51.31,20.8 0 top
C27  51.31,22.58 0 top
C30  55.51,58.39 270 top
C31  78.49,22.58 180 top
C32  62.74,61.73 180 top
C33  62.74,63.29 180 top
C35  55.53,37.03 180 top
C36  78.49,19.79 180 top
C37  85.09,23.09 180 top
C38  77.98,41.63 180 top
C39  77.98,38.84 180 top
C40  85.6,41.38 180 top
C41  85.6,38.33 180 top
C42  84.07,39.85 180 top
C43  78.87,43.92 180 top
C44  90.93,22.58 180 top
C45  90.93,19.79 180 top
C46  97.54,23.09 180 top
C47  90.42,41.63 180 top
C48  90.42,38.84 180 top
C49  98.04,41.38 180 top
C50  98.04,38.33 180 top
C51  96.52,39.85 180 top
C52  91.31,43.92 180 top
C54  67.49,61.84 270 top
D1  90.83,55.14 180 top
D2  59.46,63.6 0 top
D3  24.89,22.33 0 top
D4  24.89,18.77 0 top
D5  24.89,15.47 0 top
D6  24.89,12.17 0 top
D7  67.82,18.77 90 top
D8  24.89,8.61 0 top
D9  52.05,63.09 0 top
D10  95.44,57.31 270 top
D11  53.28,45.34 90 top
D12  24.13,43.87 90 bottom
D13  85.79,57.2 270 top
D100  138.68,5.82 180 top
F1  176.53,28.42 270 top
F2  27.43,60.17 0 top
GND  55.63,2.52 0 top
IP+  42.93,7.6 0 top
IP-  42.93,10.39 0 top
IT+  42.93,18.52 0 top
IT-  42.93,21.31 0 top
J1  186.92,46.56 0 top
K1  138.94,18.01 180 top
L1  43.85,46.99 180 top
PACK+  110.74,59.92 0 top
PACK+FUSED  102.87,59.92 0 top
PACK_INP  90.17,48.49 0 top
PACK_ISO_DIAG  90.17,2.52 0 top
PRECHARGE_OK  46.99,2.52 0 top
Q1  59.69,46.42 180 top
Q2  143.51,5.82 90 top
R1  26.42,57.38 180 bottom
R2  105.4,41.26 90 top
R3  103.6,41.27 270 top
R4  109.3,39.97 0 top
R5  101.86,41.23 270 top
R6  104.56,50.17 270 top
R7  102.83,50.18 90 top
R8  106.33,50.18 90 top
R9  94.59,53.81 180 bottom
R10  60.2,16.49 270 top
R11  62.74,22.33 180 top
R12  17.57,44.69 90 top
R13  141.48,46.97 0 top
R14  60.36,52.95 0 top
R15  56.79,62.92 90 top
R18  59.46,61.73 180 top
R23  141.48,33.76 0 top
R24  111.51,38.71 90 bottom
R25  28.19,22.33 0 top
R26  28.19,18.77 180 top
R27  28.19,15.47 0 top
R28  67.82,15.98 180 top
R29  28.19,12.17 0 top
R30  96.52,17.12 90 top
R31  28.19,8.61 0 top
R33  67.82,21.57 0 top
R34  60.2,20.55 270 top
R40  56.35,60.69 0 top
R42  95,17.12 90 top
R50  19.18,44.69 90 top
R51  54.15,49.06 0 top
R52  82.3,46.46 0 top
R53  82.29,48.39 180 top
R54  82.3,50.27 0 top
R55  78.99,45.7 0 top
R56  68.85,56.86 90 top
R57  94.74,45.7 0 top
R58  94.74,47.47 180 top
R59  94.74,49.25 0 top
R60  91.44,45.7 0 top
R61  69.89,61.69 90 top
SHDN  38.35,2.52 0 top
TS+  190.73,28.17 270 top
TS+12V  74.25,60.92 0 top
TS-  23.88,50.52 180 top
TS-FUSED  33.91,37.47 90 top
TS-UNFUSED  9.91,52.99 0 top
TS/3  104,38 0 top
TS_INP  78.23,48.74 0 top
TS_ISO_DIAG  81.53,2.52 0 top
U1  103.58,45.91 90 top
U2  62.48,57.38 90 top
U5  102.62,16.74 270 top
U7  81.28,30.96 180 top
U8  93.73,30.96 180 top
U10  62.99,18.77 180 top
U$2  [MOUNTING_M4]  4,61 0 top
U$6  [MOUNTING_M4]  26,4 0 top
U$7  [DANGER_HIGH_VOLTAGE]  44.45,33.5 0 top
U$8  [HV_MEDIUM]  176.53,51.54 0 top
U$9  [HV_MEDIUM]  47.5,30.46 0 top
U$10  [LOGO_HYTECH_MEDIUM]  68.19,11.68 0 top
U$11  [MOUNTING_M3]  184.56,28.1 0 top
U$12  [MOUNTING_M3]  54.56,28.1 0 top
U$13  [HV_MEDIUM]  176.53,4.55 0 top
U$14  [HV_MEDIUM]  105.28,11.66 0 top
U$15  [HV_MEDIUM]  196.34,16.23 0 top
U$16  [HV_MEDIUM]  176.53,51.54 0 bottom
U$17  [MOUNTING_M4]  196,51 0 top
U$18  [LOGO_GT_MEDIUM]  159,4.55 0 top
U$22  [MOUNTING_M4]  196,4 0 top
U$100  [HV_MEDIUM]  196.34,16.23 0 bottom
U$101  [HV_MEDIUM]  105.28,11.66 0 bottom
U$102  [HV_MEDIUM]  176.53,4.55 0 bottom
U$103  [HV_MEDIUM]  47.5,30.46 0 bottom

### Tracks (layer width: path | path; a pad name or v marks a point on that pad's centre or on a via)
12VTS_A
  Top 0.254: R12.1 R50.1 20.64,42.38 12VTS.2
+5V
  Top 0.508: U10.5 62.99,16.47 C23.1 | U7.12 80.64,24.49 79.99,23.83 C31.1 C36.1 79.99,17.5 76.94,14.45 | C24.1 C25.1 50.56,9.12 51.32,9.88 51.32,11.65 A1.3 | U8.12 93.09,24.49 92.46,23.85 92.46,22.61 C44.1 C45.1 87.1,14.45 76.94,14.45 | C23.1 63,14.45 76.94,14.45 | C23.1 61.95,15.44 R10.2 58.39,15.44 57.25,14.3 57.25,4.62 | R26.1 31.16,18.77 33.43,21.05 36.02,21.05 37.08,19.99 37.08,14.92 37.48,14.53 45.62,14.53 45.95,14.53 47.65,12.83 47.65,6.81 48.64,5.82 C24.1 | C24.1 51.75,4.62 57.24,4.62 57.25,4.62 | 57.25,4.62 59.35,2.52 +5V.1
+24V  (via drill 0.35, 0.51)
  Top 0.508: C27.1 C26.1 50.56,19.03 51.31,18.28 A1.1 | R25.2 29.04,22.45 v29.93,23.34 | v69.22,6.2 +24V.1
  Route2 0.254: 47.24,23.34 v48.01,22.58
  Route2 0.508: ACU.1 35.36,7.19 37.29,5.26 42.04,5.26 48.01,11.23 v48.01,20.8 | v29.93,23.34 47.24,23.34 | A1.1 61.85,6.2 v69.22,6.2
  other vias: 49.45,22.58 49.45,20.8
  pour Route2 (no thermals): 46.81,23.47 46.81,19.81 50.6,19.81 50.6,23.47
  pour Top (no thermals): 50.98,22.96 50.98,20.42 50.98,19.89 51.97,18.9 51.97,16.08 48.36,16.08 46.84,17.6 46.84,22.51 47.29,22.96
AIL+  (via drill 0.35)
  Top 0.254: v17.58,46.84 R12.2
  Bottom 0.254: v17.58,46.84 17.58,45.42 18.87,44.12 35.43,44.12 36.42,43.13 36.42,40.06 38.51,37.97 50.32,37.97 52.4,40.06 52.4,57.38
  Bottom 0.508: J1.1 182.32,52.66 144.37,52.66 126.8,35.08 126.8,13.84 122.89,9.93 113.97,9.93 108.43,15.47 108.43,30.51 99.69,39.24 95.66,39.24 93.75,41.16 R9.1 93.75,53.82 68.58,53.82 65.02,57.38 52.4,57.38 R1.2
BIAS
  Top 0.203: U2.9 64.53,59.66 64.26,59.92 64.26,60.68 64.52,60.94 64.8,61.22 64.8,62.61 64.12,63.29 C33.1 63.49,63.99 62.99,64.49 60.96,64.49 60.61,64.14 D2.C
DCDC_ENABLE
  Top 0.254: U10.4 65.43,15.98 R28.2 66.97,18.62 D7.3 66.97,18.92 R33.1 66.97,21.91 64.77,24.11 42.67,24.11 42.04,24.74 26.54,24.74 24.89,23.09 24.89,11.41 25.65,10.64 27.43,10.64 29.04,9.03 R31.2
DCM
  Top 0.254: U2.10 67.46,60.3 C54.2
FB
  Top 0.203: U2.12 58.94,59.66 58.61,59.98 R18.2 57.13,61.73 R15.1
G
  Top 0.254: U2.19 59.7,55.09 58.67,55.09 57.91,54.33 57.91,53.32 58.28,52.95 R14.1
GND  (via drill 0.51)
  Top 0.152: D8.1 24.07,8.55
  Top 0.406: Q2.2 144.86,6.76 146.05,5.56 146.05,3.53 144.78,2.26 v97.16,2.26
  Top 0.508: D3.1 24.07,22.27 v23.11,21.31 | D6.1 24.07,12.1 v23.11,11.15 | D5.1 24.07,15.41 v23.11,14.45 | 24.07,8.55 v23.11,7.6 | C23.2 v64.77,15.47 | U7.9 76.83,22.73 C31.2 v75.69,22.58 | U7.15 84.45,23.2 C37.2 v83.06,23.09 | v53.34,7.6 C25.2 | C24.2 v53.34,5.82 | C26.2 v53.34,20.8 | C27.2 v53.34,22.58 | GND.1 v58.17,2.52 | ACU.4 33.71,18.95 v33.66,18.9 | v88.14,22.58 C44.2 89.28,22.73 U8.9 | C45.2 v88.14,19.79 | v95.5,23.09 C46.2 96.9,23.2 U8.15 | U5.2 v97.66,15.47 | C36.2 76.22,20.55 v75.69,20.55 | R28.1 v69.85,15.98 | D7.1 69.65,17.83 v70.23,17.25 | v64.77,22.33 R11.1 62.99,21.73 U10.2 | D4.1 23.05,17.76 v23.05,17.7 | v58.67,21.82 59.98,21.82 R34.1
  pour Route15: 21.89,24.99 98.81,24.99 98.81,-0.01 21.89,-0.01
INTVCC  (via drill 0.35)
  Top 0.254: U2.17 v56.63,56.4 | v66.55,57.63 66.55,58.4 65.94,59.01 U2.8 64.16,59.01 63.49,59.67 C32.1
  Route15 0.254: v56.63,56.4 56.64,56.41 56.64,57.13 57.15,57.63 v66.55,57.63
IP+  (via drill 0.35)
  Top 0.254: U8.11 91.82,24.73 v91.95,24.61 | ACU.5 40.72,7.6 IP+.1
  Route2 0.254: v91.95,24.61 91.4,24.06 91.4,20.13 84.2,12.93 v84.2,12.17 v84.19,12.17
  Bottom 0.254: ACU.5 39.55,11.15 44.2,11.15 46.48,8.87 80.86,8.87 84.18,12.18 v84.19,12.17
IP-  (via drill 0.35)
  Top 0.254: U8.10 90.55,24.74 v90.42,24.61 | ACU.6 40.92,10.39 IP-.1
  Route2 0.254: v90.42,24.61 90.98,24.05 90.98,20.29 82.93,12.23 v82.93,12.17
  Bottom 0.254: v82.93,12.17 82.93,11.53 80.67,9.27 46.65,9.27 44.36,11.56 39.75,11.56 ACU.6
IT+  (via drill 0.35)
  Top 0.254: U7.11 79.38,24.31 v79.29,24.22 | ACU.7 40.92,18.52 IT+.1
  Bottom 0.254: ACU.7 39.75,17.35 44.55,17.35 45.85,18.65 76.97,18.65 78.6,20.28 78.6,23.53 v79.29,24.22
IT-  (via drill 0.35)
  Top 0.254: U7.10 78.11,24.21 v78.09,24.2 | ACU.8 40.72,21.31 IT-.1
  Bottom 0.254: ACU.8 39.55,17.76 44.38,17.76 45.69,19.06 76.8,19.06 78.19,20.44 78.19,23.55 78.09,23.65 v78.09,24.2
N$1
  Top 0.254: R14.2 61.97,52.19 61.99,52.19 Q1.1
N$2
  Top 0.254: R27.1 D5.2
N$3  (via drill 0.51)
  Top 0.406: v97.28,4.04 142.15,4.04 142.99,4.88 Q2.1 | v77.22,17.5 73.49,17.5 69.43,21.57 R33.2
  Bottom 0.406: v77.22,17.5 83.82,17.5 v97.28,4.04
N$4
  Top 0.203: D9.C 55.12,63.09 55.8,63.78 R15.2
  Top 0.254: R15.2 58.13,63.77 D2.A
N$5
  Top 0.305: R3.2 103.6,38.4 TS/3.1
  Top 0.406: R2.1 103.61,40.41 R3.2
N$6
  Top 0.406: R2.2 106.95,42.11 108.25,40.8 R4.1
N$10
  Top 0.254: R11.2 61.89,20.24 U10.3
N$11
  Top 0.254: R34.2 R10.1 61.97,17.54 U10.6
N$12
  Top 0.406: R7.1 104.55,49.33 R6.2
N$17
  Top 0.254: R56.2 68.85,58.79 69.89,59.83 R61.1
N$18
  Top 0.254: R61.2 67.54,63.28 C54.1
N$22
  Top 0.254: R29.1 D6.2
N$24
  Top 0.254: R31.1 D8.2
N$25
  Top 0.254: R25.1 D3.2
N$30
  Top 0.254: R26.2 D4.2
N$33
  Top 0.508: U7.16 85.72,23.2 C37.1 85.84,22.32 84.84,21.31 82.8,21.31 81.92,22.2 U7.13
N$40
  Top 0.406: K1.3 139.83,12.03 D100.A Q2.3
N$43
  Top 0.203: R40.1 C30.1
N$50
  Bottom 0.813: R13.1 R23.1 164.34,31.22 K1.1
N$52
  Top 0.508: U8.16 98.17,23.2 C46.1 98.29,22.33 97.27,21.31 95.25,21.31 94.36,22.2 U8.13
N$53
  Top 0.254: U5.1 96.56,18.01 R30.2 96.18,17.63 95.34,17.63 R42.2
N$57  (via drill 1.02)
  Top 0.813: v116.84,15.47 U5.3
  Bottom 0.813: R24.1 113.03,36.34 113.03,25.38 118.36,20.04 118.36,16.99 v116.84,15.47
N$59
  Top 0.508: R52.2 83.34,46.47 R53.1
N$60
  Top 0.508: R53.2 81.24,50.26 R54.1
N$65
  Top 0.406: R58.1 R57.2
N$66
  Top 0.406: R59.1 R58.2
PACK+  (via drill 1.02)
  Top 0.813: K1.2 U5.4 | PACK+.1 v110.74,59.95
  Route2 0.813: 127.97,40.36 149.86,40.36 164.85,25.38 182.12,25.38 189.82,17.67 TS+.6 | 127.97,40.36 127.76,40.36 113.54,26.14 K1.2 | 127.97,40.36 110.74,57.58 v110.74,59.95
PACK+FUSED  (via drill 0.64, 1.02 pad 0.55)
  Top 0.508: R59.2 v97.03,49.25
  Top 0.813: PACK+FUSED.1 102.89,59.9 v102.89,59.86
  Route15 0.508: v97.03,49.25 97.03,52.22 102.89,58.09 v102.89,59.86
  Bottom 0.813: v102.89,59.86 103.87,59.86 111.51,52.22 R24.2
PACK_DCDC_OUT
  Top 0.254: 95.75,39.88 C51.2
  Top 0.508: U8.1 98.17,37.71 C50.1 C49.1 98.79,43.42 98.04,44.17 96.52,44.17 95.75,43.4 95.75,39.88 | C51.2 95.63,39.72 U8.3
PACK_HLDO_OUT
  Top 0.508: U8.5 93.09,37.16 91.92,38.33 C48.1 C47.1
PACK_INP
  Top 0.406: U8.6 91.82,36.93 89.79,38.97 89.79,41.64 C52.1 92.06,45.47 R60.2 | R60.2 90.17,47.82 PACK_INP.1 | R60.2 R57.1
PACK_ISO_DIAG  (via drill 0.35)
  Top 0.254: U8.14 95.63,24.74 v95.5,24.61 | v90.17,5.06 PACK_ISO_DIAG.1
  Route2 0.254: v95.5,24.61 93.6,22.71 93.6,8.48 v90.17,5.06
PACK_OPA_OUT  (via drill 0.5)
  Top 0.406: U1.4 102.11,46.94 v102.11,47.98
  Bottom 0.406: R9.2 96.69,53.81 102.11,48.39 v102.11,47.98
PRECHARGE_OK
  Top 0.254: U10.1 64.45,20.08 65.79,21.42 65.79,22.33 64.52,23.6 42.16,23.6 41.53,24.23 29.34,24.23 28.19,23.09 28.19,13.02 R29.2 | R29.2 29.04,11.32 30.73,9.63 30.73,6.33 36.17,0.89 45.37,0.89 PRECHARGE_OK.1 | ACU.3 32.83,15.95 R29.2
SENSE
  Top 0.254: U2.18 57.56,55.75 55,53.2 R51.2
  Top 0.406: Q1.3 56.53,49.06 R51.2
SHDN  (via drill 0.51)
  Top 0.254: R27.2 31.08,17.5 36.07,17.5 36.58,16.99 36.58,14.2 35.36,12.98 ACU.2 35.33,12.95 32,9.63 32,7.09 36.58,2.52 SHDN.1 | R30.1 96.18,16.61 95.34,16.61 R42.1
  Top 0.406: K1.4 135.13,19.28 135.13,9.37 137.53,6.97 D100.C v97.28,5.82 96.52,6.58 R30.1
  Route2 0.254: v97.28,5.82 92.35,0.88 37.19,0.88 32.51,5.56 32.51,10.11 ACU.2
SS
  Top 0.203: U2.14 57.94,58.36 C10.1
SW
  Top 0.203: C30.2 | R18.1 C32.2 | 62.02,61.99 61.74,61.99 C32.2 | C32.2
  Top 0.254: U2.20 60.83,54.45 62.01,55.64 U2.THERMAL
  Top 0.406: 57.21,57.7 U2.15 U2.16 60.03,57.38 U2.THERMAL 62.01,61.99 62.02,61.99 | C33.2 C32.2
  Top 0.508: C30.2 C10.2 57.21,57.7 | L1.1 49.27,46.89 D11.C 53.3,46.91 R51.1 53.29,49.08 53.29,55.42 C30.2
TS+12V  (via drill 0.35, 0.51, 0.65 pad 0.55)
  Top 0.254: v97.43,45.19 v97.44,45.19 C7.1 C4.1 102.41,45.19 U1.5 | v48.67,63.09 D9.A | v19.18,46.81 R50.2
  Top 0.406: v100.82,51.42 102.44,51.42 R7.2
  Top 0.508: TS+12V.1 74.25,58.8 v73.24,57.8
  Route15 0.254: v27.25,46.86 26.82,47.3 26.82,60.88 29.03,63.09 v48.67,63.09
  Bottom 0.254: v97.43,45.19 96.95,45.67 96.95,46.38 97.54,46.97 102.74,46.97 103.78,48.01 103.78,50.48 102.85,51.42 v100.82,51.42 | D12.C 21.52,46.02 20.73,46.81 v19.18,46.81
  Bottom 0.508: 22.35,57.38 22.35,59.92 24.92,62.48 47.22,62.48 49.39,60.32 66.82,60.32 69.34,57.8 v73.24,57.8 75.16,55.88 96.35,55.88 v100.82,51.42 | R1.1 22.35,57.38 | D12.C 22.35,47.8 22.35,57.38
  other vias: 35.48,46.1 33.22,46.08 30.58,46.08 28.32,46.08 28.37,47.6 30.58,47.63 33.25,47.63 35.46,47.6
  pour Top (no thermals): 40.21,49.71 37.11,49.71 35.94,48.54 26.72,48.54 26.72,44.45 40.21,44.45
  pour Bottom: 23.04,48.19 23.04,44.83 35.74,44.83 35.74,48.19
TS+FUSED
  Top 0.508: 131.06,42.39 128.63,39.96 R4.2
  Top 1.016: F1.3 F1.4 | F1.3 170.33,25.12 148.34,25.12 131.06,42.39 118.28,55.18 95.46,55.18 D10.C 95.42,55.14 D1.A | F1.3 182.02,18.92 186.77,23.67 TS+.5 TS+.4
TS+UNFUSED  (via drill 0.65)
  Top 0.508: v85.09,50.27 R54.2
  Route15 0.508: v85.09,50.27 90.93,50.27 94.23,46.97 94.23,41.38 96.27,39.35 103.12,39.35 108.71,33.76 R23.2
  Route15 0.813: F1.1 F1.2 179.17,37.9 179.98,38.71 190.69,38.71 TS+.1 TS+.2 TS+.3 | R13.2 R23.2
  Route15 1.016: F1.2 171.96,37.9 169.24,40.62 134.87,40.62 128.52,46.97 R13.2
TS-FUSED  (via drill 0.35, 0.5, 0.51, 1.02)
  Top 0.254: 12VTS.1 22.49,42.04 v27.46,42.04
  Top 0.406: C48.2 88.92,39.35 89.18,39.6 89.18,40.87 88.92,41.12 C47.2 | C52.2 90.56,45.67 | 78.12,45.67 C43.2 78.12,43.27 C38.2 76.48,41.12 76.73,40.87 76.73,39.6 76.48,39.35 C39.2 | R60.1 v89.41,45.7 | R55.1 v76.45,45.7 | C48.2 89.05,38.84 90.55,37.34 U8.7 | U8.8 89.28,38.48 C48.2 | U7.7 78.11,37.34 76.61,38.84 C39.2 | C47.2 90.56,43.27 C52.2 | U7.8 76.83,38.48 C39.2 | 97.27,41.35 C49.2 | C39.2 76.42,38.78 v74.89,38.78 | v99.06,47.98 C7.2 C4.2 v100.66,47.94 v100.65,47.95 | C1.2 107.76,48.34 v107.77,48.34 | R8.1 107.33,49.33 v107.56,49.56 | C2.2 107.75,43.41 v107.77,43.39 | U1.2 106.3,45.91 v106.34,45.87 | v100.33,42.9 101.04,42.9 R5.1 | v87.88,42.9 87.88,42.67 C47.2 | v87.88,40.11 87.88,39.88 C48.2 | v89.41,43.92 C52.2
  Top 0.508: 90.56,45.67 R60.1 | C41.2 84.82,38.35 | 84.82,41.35 C40.2 | 78.12,45.67 R55.1
  Top 0.813: C41.2 84.45,37.94 U7.2 | 84.82,38.35 C42.1 84.82,41.35 | C40.2 84.84,41.39 v84.84,42.9 | v97.28,42.9 97.29,42.89 C49.2 | U8.2 96.9,37.98 97.27,38.35 | C50.2 97.27,38.35 | 97.27,38.35 C51.1 97.27,41.35
  Route2 0.508: J1.2 180.95,51.03 128.02,51.03 115.57,63.48 96.01,63.48 v94.23,61.7
  other vias: 74.89,41.58 74.89,42.85 74.89,40.05 89.41,61.7 91.95,61.7 86.87,61.7 28.45,40.62 29.72,40.62 30.99,40.62 32.26,40.62 33.78,40.62 34.8,40.62 84.33,61.7 96.27,61.7 89.41,59.41 91.95,59.41 78.33,62.7 81.33,62.7
  pour Route2 (isolate 1.27): 21.84,65.51 21.84,32.16 69.16,32.16 74,37 108.97,36.81 108.97,65.51
  pour Top: 74.68,37.57 74.68,45.95 78.49,45.95 78.49,43.41 76.96,41.89 76.96,37.57
  pour Top (no thermals): 26.29,43.69 25.98,43.99 25.98,48.72 26.77,49.51 31.67,49.51 33.32,51.16 33.32,54 34.67,55.35 47.17,55.35 47.17,64.21 47.02,64.36 21.84,64.37 21.84,39.3 23.34,37.8 23.34,32.08 54.1,32.08 54.1,44.43 52.58,44.43 52.58,40.36 51.56,39.35 36.83,39.35 35.31,40.87 35.31,42.39 29.39,42.39 28.1,43.69
  pour Top (no thermals): 77.39,63.6 77.39,60.76 81.97,60.76 84.58,58.14 96.89,58.14 96.89,63.6
  pour Bottom: 23.01,42.88 23.01,34.49 23.06,34.44 35.69,34.44 35.69,42.88
TS-UNFUSED
  Top 0.813: TS-.5 12.37,50.52 TS-UNFUSED.1
  Route15 0.813: F2.1 F2.2 18.8,59.34 18.8,52.94 TS-.5 TS-.4
  pour Route15: 20.37,62.49 20.37,49.02 11.28,49.02 8.89,51.41 8.89,62.49
TS_DCDC_OUT
  Top 0.508: U7.1 85.72,37.71 C41.1 C40.1 86.35,43.42 85.6,44.17 84.07,44.17 83.3,43.4 83.3,39.88 C42.2 83.19,39.72 U7.3
TS_HLDO_OUT
  Top 0.508: U7.5 80.64,37.16 79.48,38.33 C39.1 C38.1
TS_INP
  Top 0.406: U7.6 79.38,36.93 77.34,38.97 77.34,41.64 C43.1 79.62,45.47 R55.2 | R55.2 79.46,45.7 78.23,46.92 TS_INP.1 | R52.1 80.48,45.7 R55.2
TS_ISO_DIAG  (via drill 0.35)
  Top 0.254: U7.14 83.19,24.73 v83.06,24.61 | v81.53,5.06 TS_ISO_DIAG.1
  Route2 0.254: v81.53,5.06 81.53,23.08 v83.06,24.61
U1+
  Top 0.406: U1.1 105.59,45.26 C2.1 106.09,44.6 R3.1 R5.2
U1-
  Top 0.406: U1.3 105.73,46.56 C1.1 105.57,47.79 105.57,50.28 R8.2 R6.1
VC
  Top 0.203: U2.13 58.83,59.01 57.2,60.63 R40.2
VIN
  pour Top (no thermals): 64.77,56.21 64.77,48.08 63.14,46.46 56.64,46.46 56.64,35.28 71.12,35.28 71.12,49.38 75.56,53.82 89.87,53.82 89.87,56.21

### Text on the board
tPlace: +24V | +5V | SHDN | PRECHARGE_OK | DCDC_ENABLE | Tractive System Board rev9 / Designed by / Femke, Andy, Ethan & Liwei